# EAGLE schematic CPU (EAGLE 7.5.0), part 2 of 7
## Module REGISTER_UNIT
Ports: DATABUS_1(io) DATABUS_2(io) DATABUS_3(io) DATABUS_4(io) DATABUS_5(io) DATABUS_6(io) DATABUS_7(io) DATABUS_8(io) ADDRESSBUS_1(io) ADDRESSBUS_2(io) ADDRESSBUS_3(io) ADDRESSBUS_4(io) ADDRESSBUS_5(io) ADDRESSBUS_6(io) ADDRESSBUS_7(io) ADDRESSBUS_8(io) ADDRESSBUS_9(io) ADDRESSBUS_10(io) ADDRESSBUS_11(io) ADDRESSBUS_12(io) ADDRESSBUS_13(io) ADDRESSBUS_14(io) ADDRESSBUS_15(io) ADDRESSBUS_16(io) D_READ(in) D_WRITE(in) E_READ(in) E_WRITE(in) F_READ(in) F_WRITE(in) G_READ(in) G_WRITE(in) H_READ(in) H_WRITE(in) XL_READ(in) XL_WRITE(in) XH_READ(in) XH_WRITE(in) XE_READ(in) XE_WRITE(in) M_READ(in) M_WRITE(in) J_READ(in) J_WRITE(in) SP_READ(in) SP_WRITE(in) BP_READ(in) BP_WRITE(in) Y_READ(in) Y_WRITE(in) Z_READ(in) Z_WRITE(in) CLOCK(in) VCC(in) GND(in) X_READ(in) X_WRITE(in)
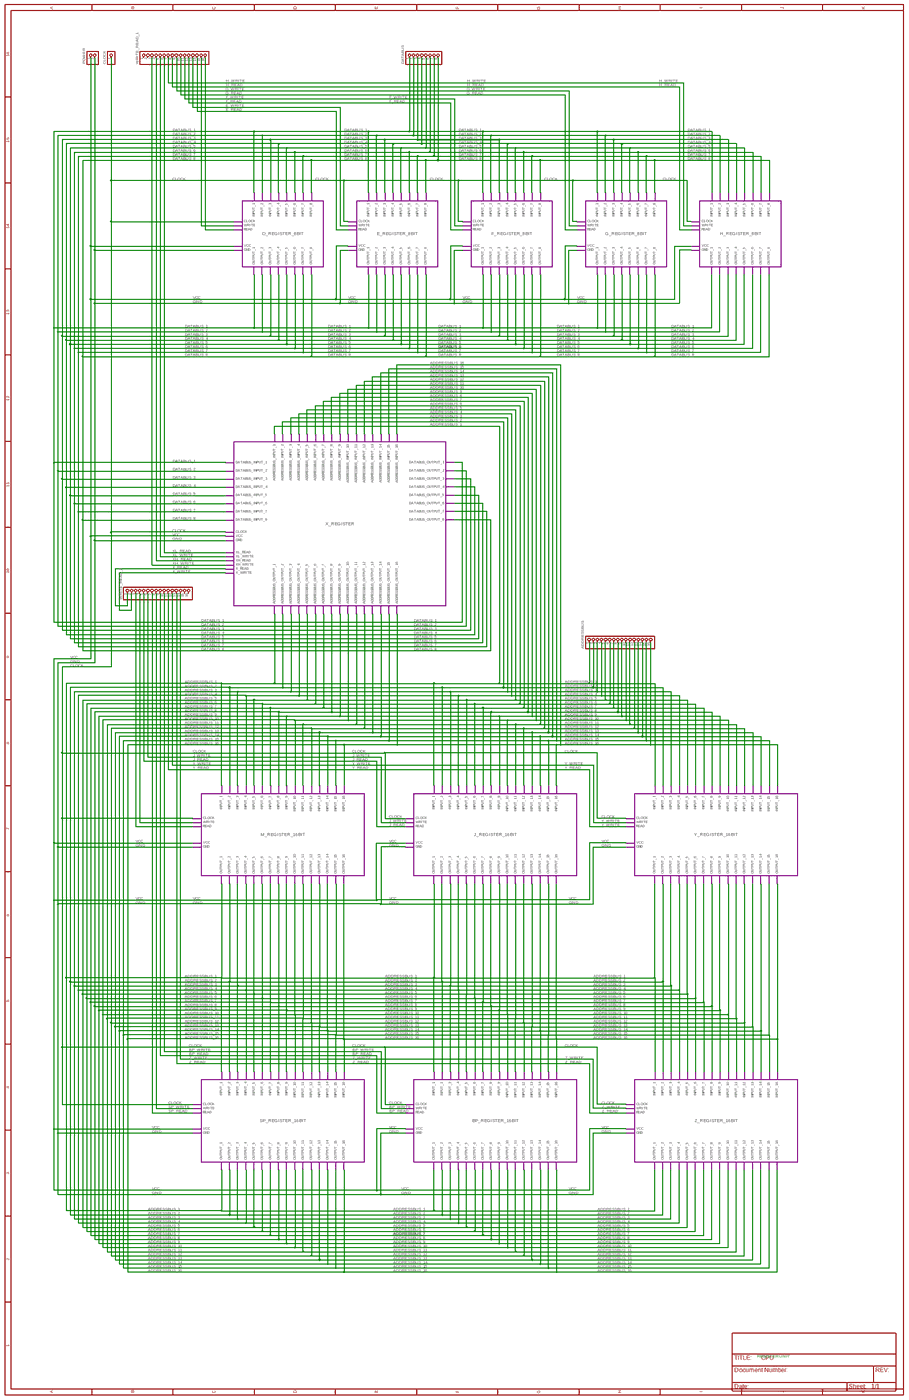
[diagram p15: schematic, module REGISTER_UNIT, sheet 1, overview]
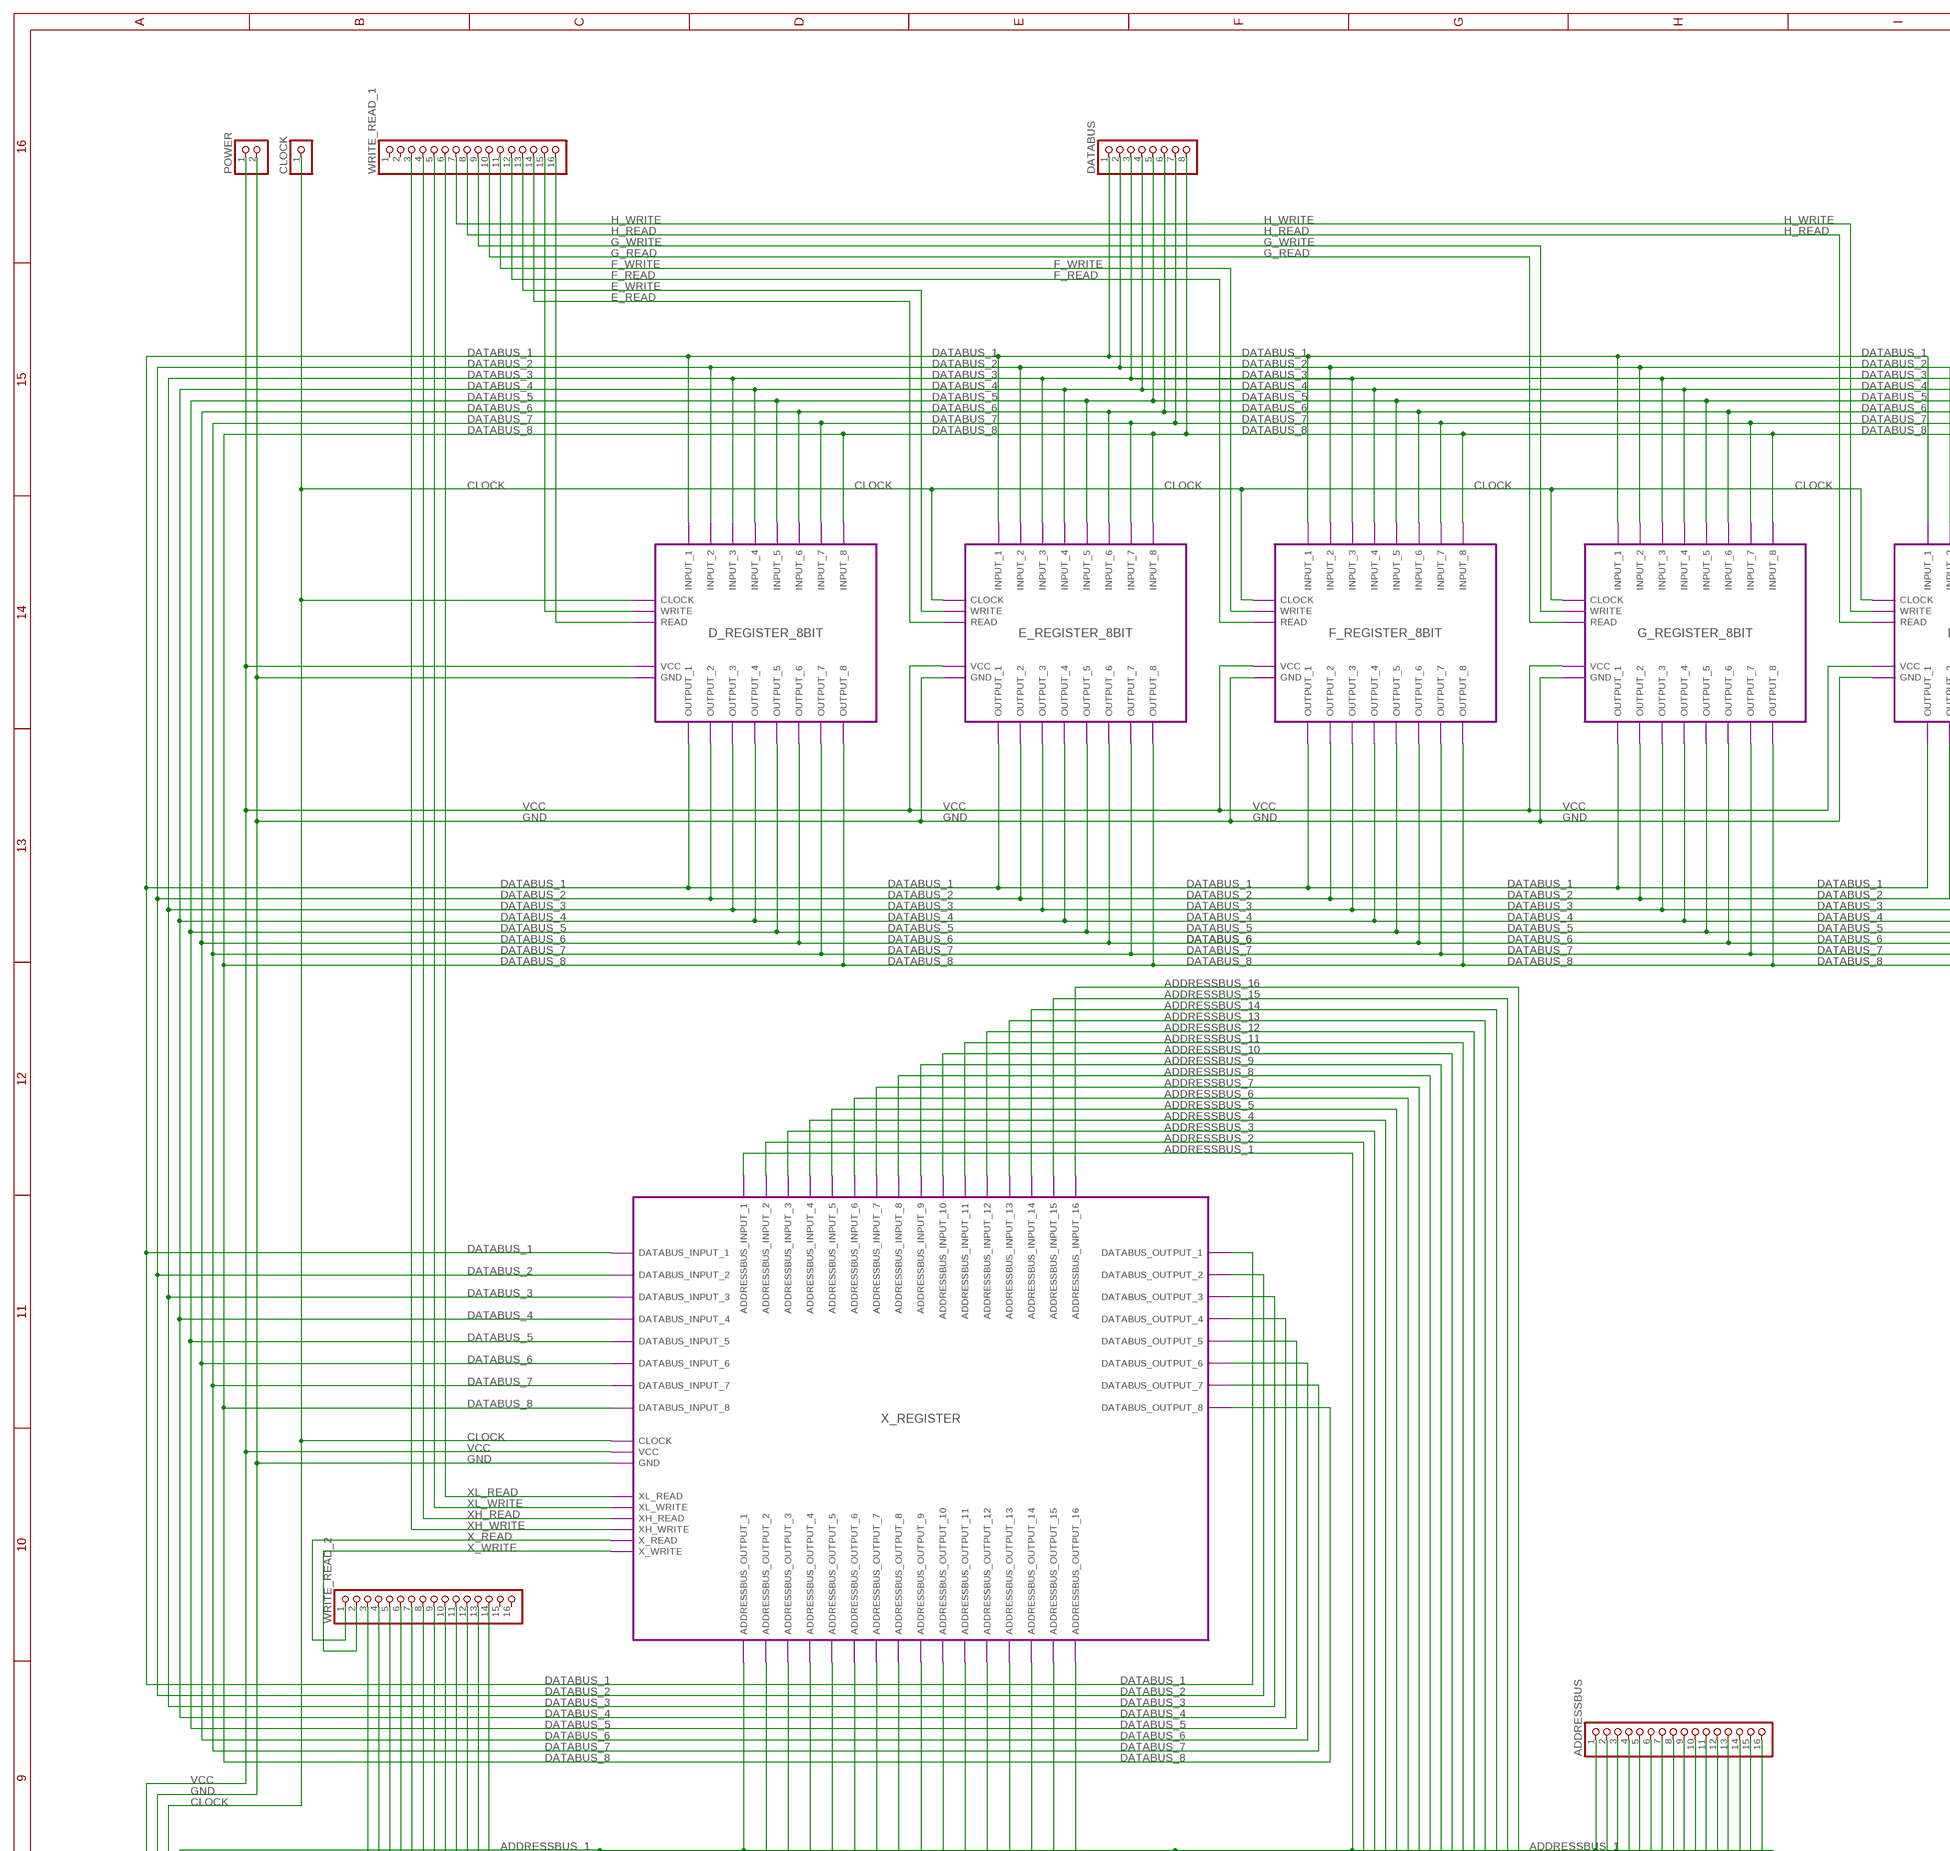
[diagram p16: schematic, module REGISTER_UNIT, sheet 1, part 1 of 4]
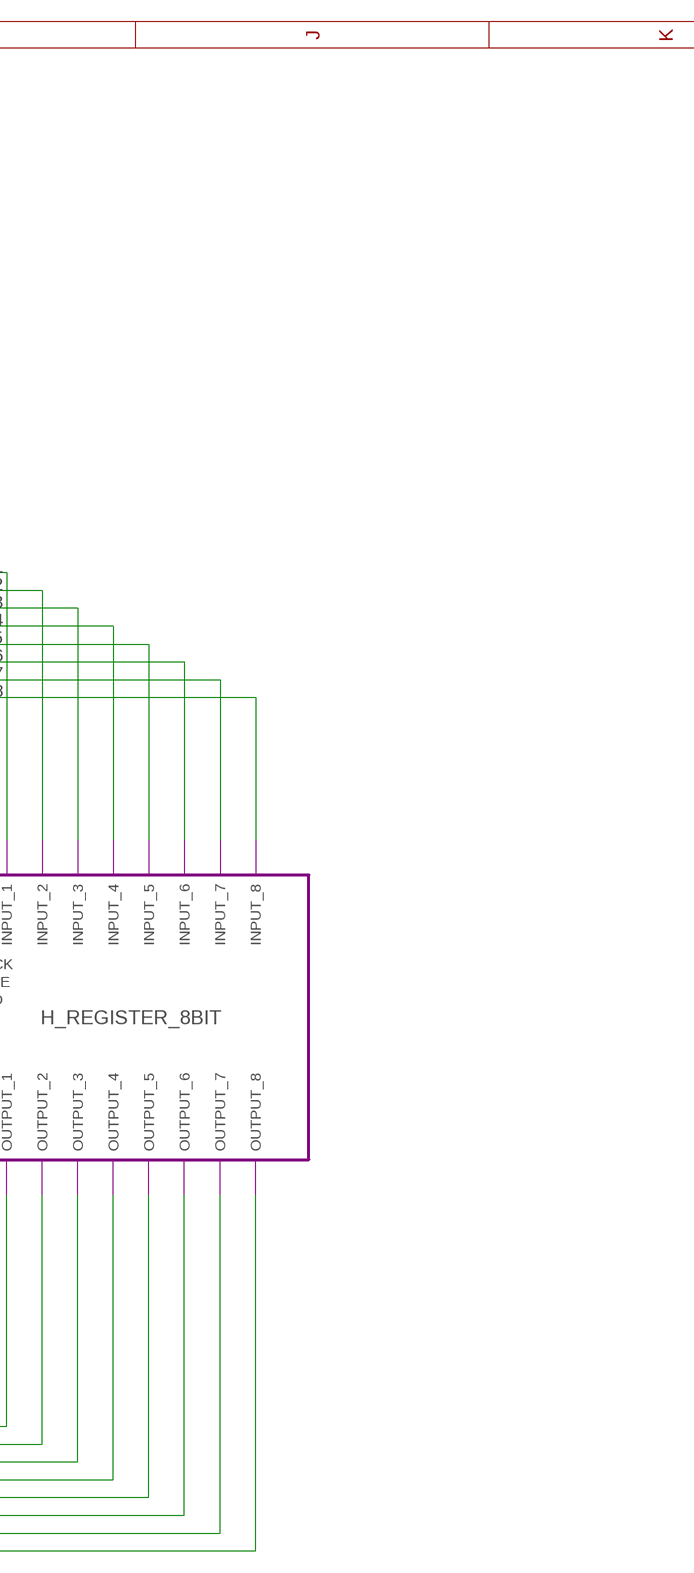
[diagram p17: schematic, module REGISTER_UNIT, sheet 1, part 2 of 4]
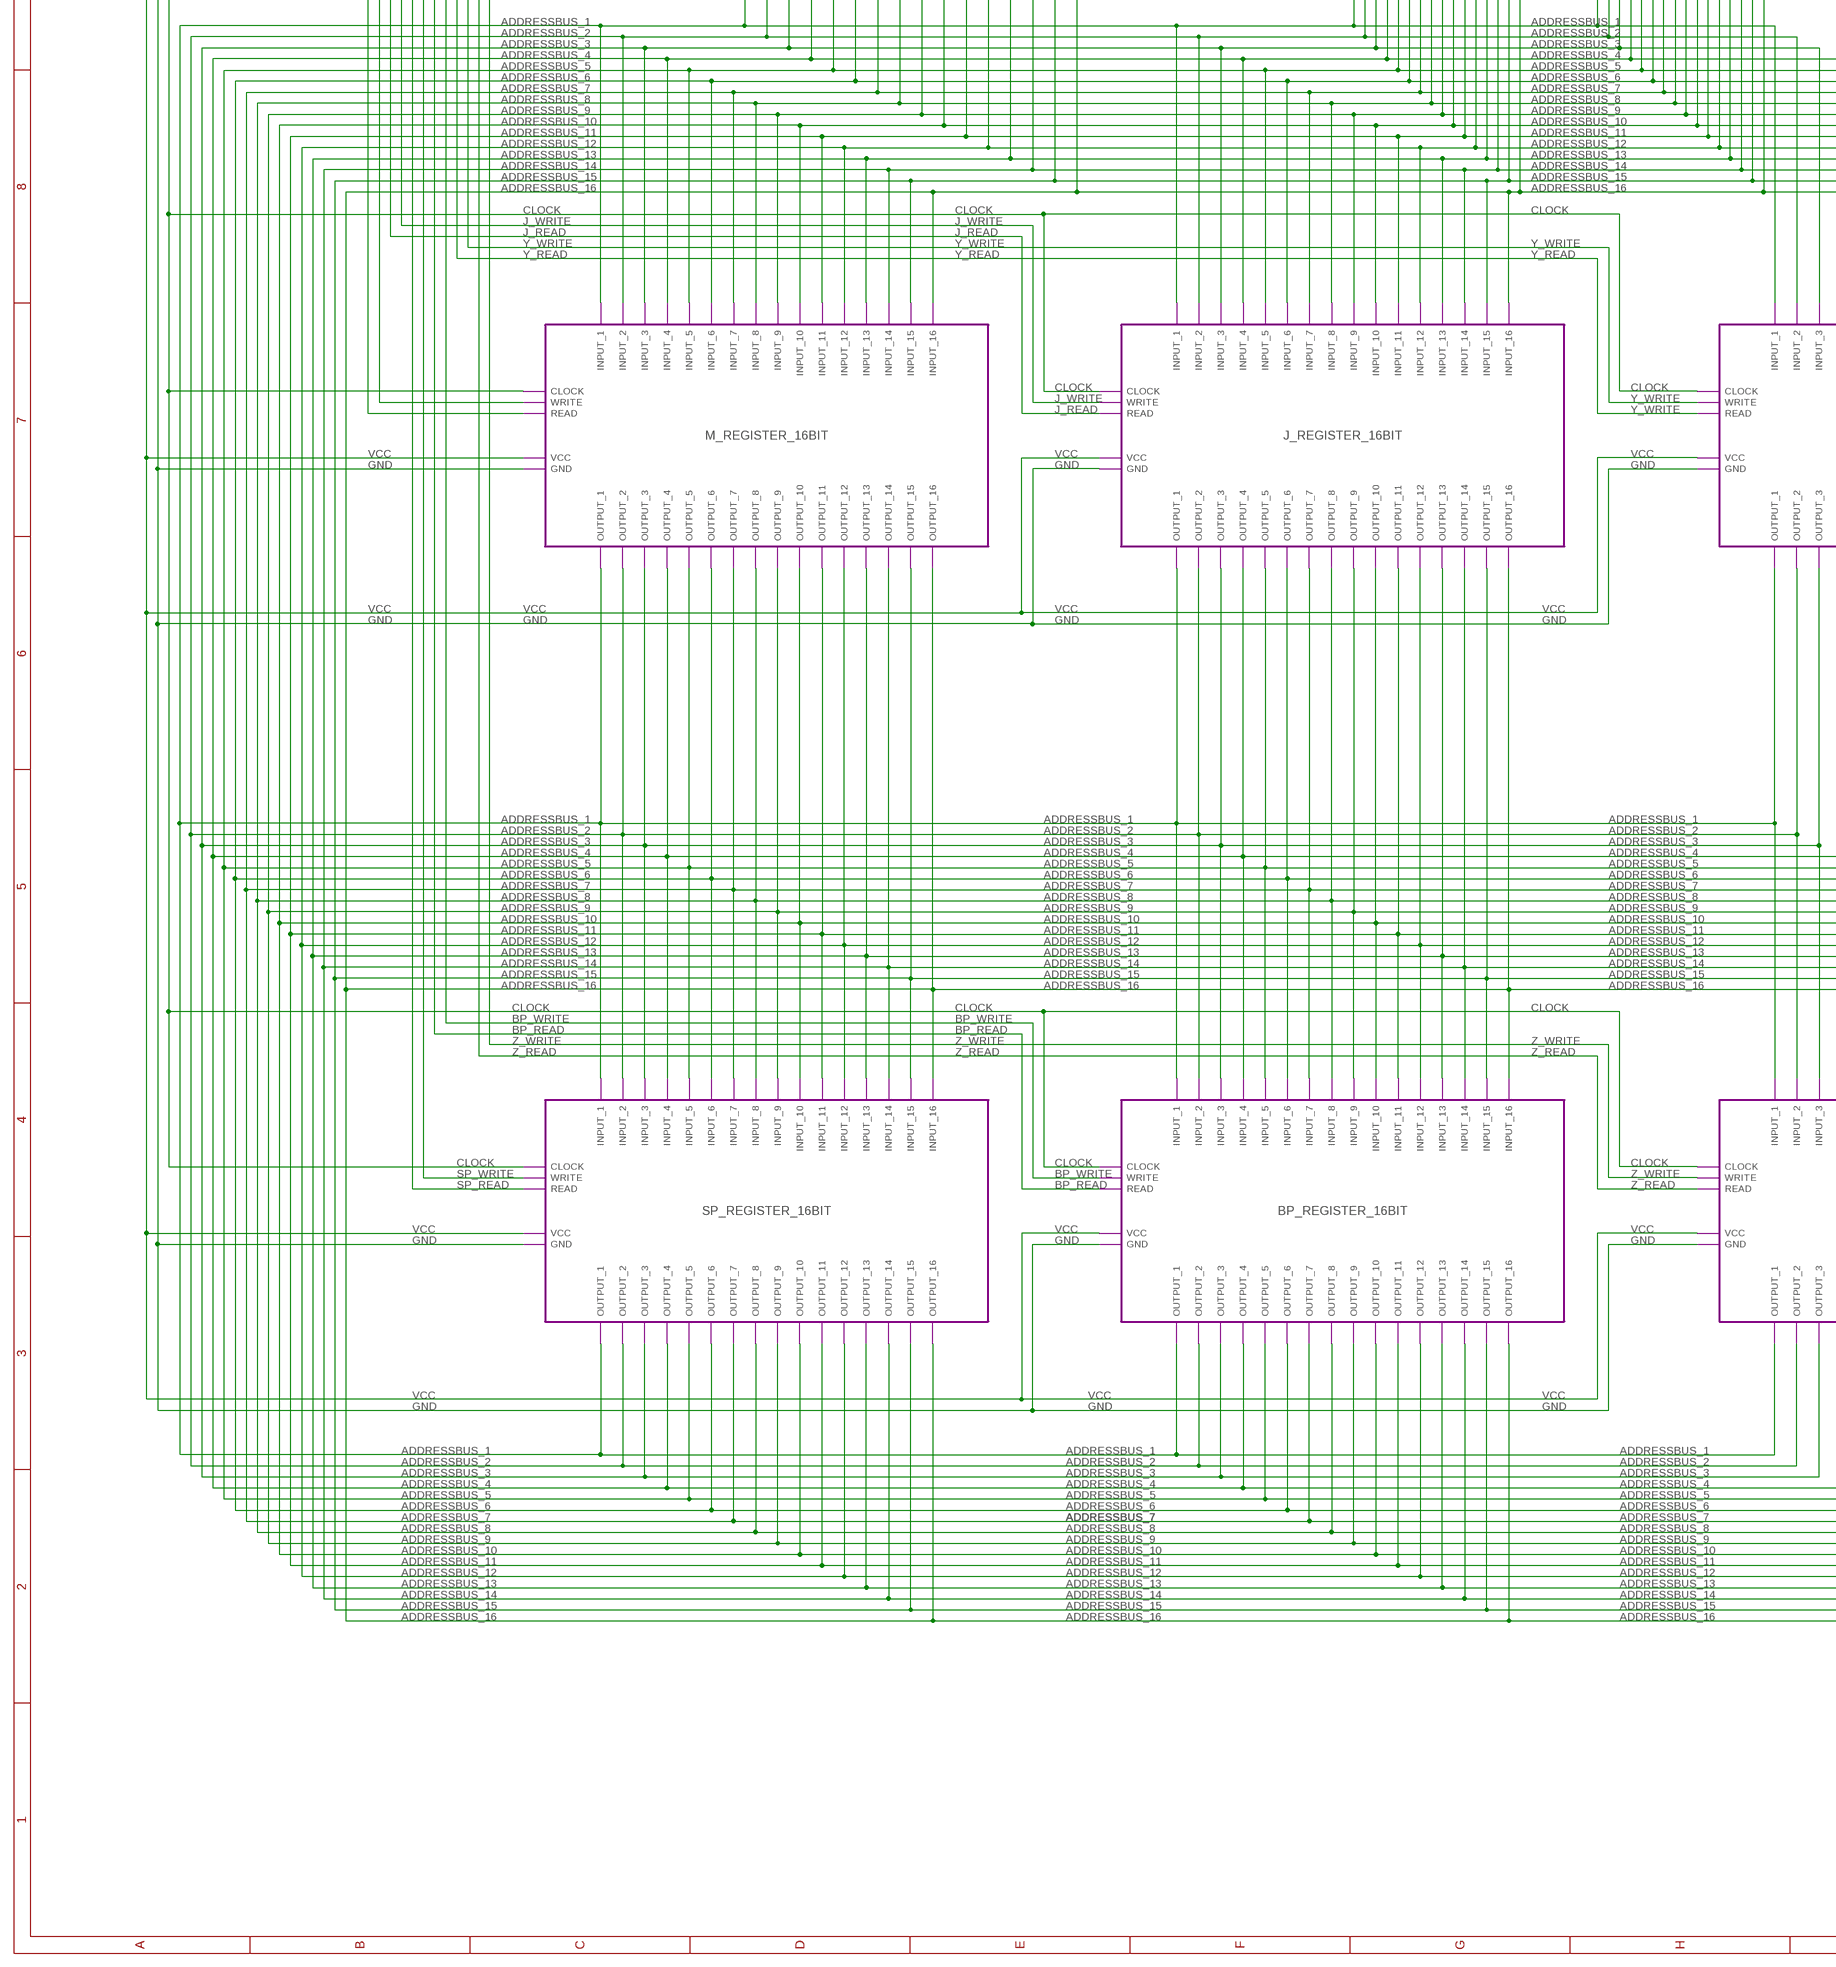
[diagram p18: schematic, module REGISTER_UNIT, sheet 1, part 3 of 4]
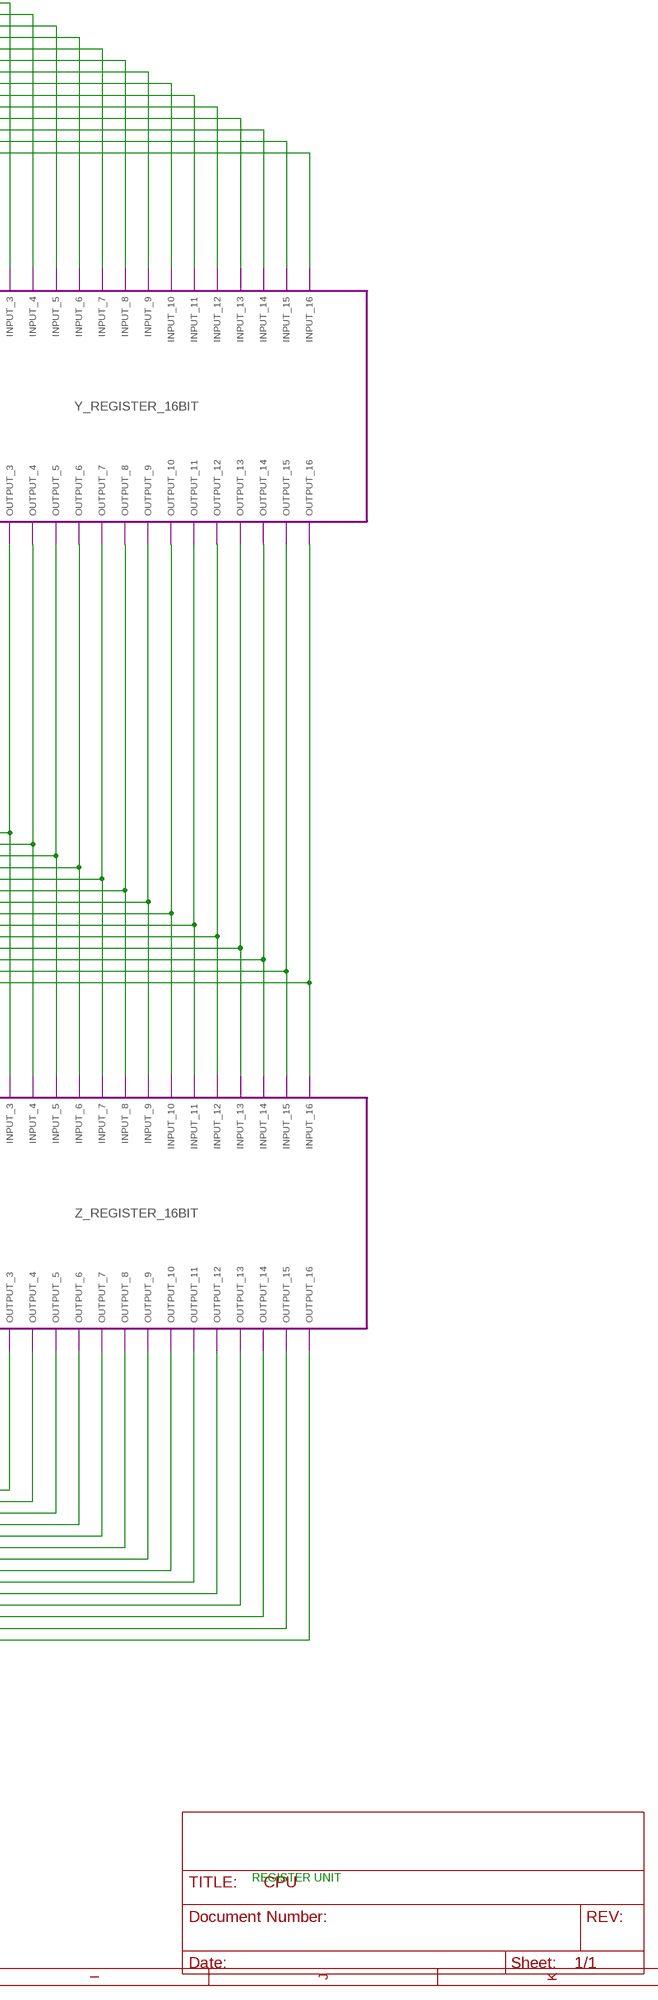
[diagram p19: schematic, module REGISTER_UNIT, sheet 1, part 4 of 4]

### Parts
ADDRESSBUS  PINHD-1X16  [1X16]
CLOCK  PINHD-1X1  [1X01]
DATABUS  PINHD-1X8  [1X08]
POWER  PINHD-1X2  [1X02]
WRITE_READ_1  PINHD-1X16  [1X16]
WRITE_READ_2  PINHD-1X16  [1X16]

### Module instances
D_REGISTER_8BIT = REGISTER
E_REGISTER_8BIT = REGISTER
F_REGISTER_8BIT = REGISTER
G_REGISTER_8BIT = REGISTER
H_REGISTER_8BIT = REGISTER
J_REGISTER_16BIT = REGISTER_16BIT
M_REGISTER_16BIT = REGISTER_16BIT
SP_REGISTER_16BIT = REGISTER_16BIT
BP_REGISTER_16BIT = REGISTER_16BIT
Y_REGISTER_16BIT = REGISTER_16BIT
Z_REGISTER_16BIT = REGISTER_16BIT
X_REGISTER = EXTENDED_REGISTER_16BIT

### Nets
ADDRESSBUS_1: ADDRESSBUS.1 ; port SP_REGISTER_16BIT.INPUT_1 M_REGISTER_16BIT.INPUT_1 Y_REGISTER_16BIT.INPUT_1 J_REGISTER_16BIT.INPUT_1 Z_REGISTER_16BIT.INPUT_1 BP_REGISTER_16BIT.INPUT_1 M_REGISTER_16BIT.OUTPUT_1 J_REGISTER_16BIT.OUTPUT_1 Y_REGISTER_16BIT.OUTPUT_1 SP_REGISTER_16BIT.OUTPUT_1 BP_REGISTER_16BIT.OUTPUT_1 Z_REGISTER_16BIT.OUTPUT_1 X_REGISTER.ADDRESSBUS_OUTPUT_1 X_REGISTER.ADDRESSBUS_INPUT_1
ADDRESSBUS_2: ADDRESSBUS.2 ; port M_REGISTER_16BIT.INPUT_2 Y_REGISTER_16BIT.INPUT_2 SP_REGISTER_16BIT.INPUT_2 J_REGISTER_16BIT.INPUT_2 Z_REGISTER_16BIT.INPUT_2 BP_REGISTER_16BIT.INPUT_2 M_REGISTER_16BIT.OUTPUT_2 J_REGISTER_16BIT.OUTPUT_2 Y_REGISTER_16BIT.OUTPUT_2 Z_REGISTER_16BIT.OUTPUT_2 SP_REGISTER_16BIT.OUTPUT_2 BP_REGISTER_16BIT.OUTPUT_2 X_REGISTER.ADDRESSBUS_OUTPUT_2 X_REGISTER.ADDRESSBUS_INPUT_2
ADDRESSBUS_3: ADDRESSBUS.3 ; port M_REGISTER_16BIT.INPUT_3 Y_REGISTER_16BIT.INPUT_3 SP_REGISTER_16BIT.INPUT_3 J_REGISTER_16BIT.INPUT_3 Z_REGISTER_16BIT.INPUT_3 BP_REGISTER_16BIT.INPUT_3 M_REGISTER_16BIT.OUTPUT_3 J_REGISTER_16BIT.OUTPUT_3 Y_REGISTER_16BIT.OUTPUT_3 Z_REGISTER_16BIT.OUTPUT_3 SP_REGISTER_16BIT.OUTPUT_3 BP_REGISTER_16BIT.OUTPUT_3 X_REGISTER.ADDRESSBUS_OUTPUT_3 X_REGISTER.ADDRESSBUS_INPUT_3
ADDRESSBUS_4: ADDRESSBUS.4 ; port M_REGISTER_16BIT.INPUT_4 Y_REGISTER_16BIT.INPUT_4 SP_REGISTER_16BIT.INPUT_4 J_REGISTER_16BIT.INPUT_4 Z_REGISTER_16BIT.INPUT_4 BP_REGISTER_16BIT.INPUT_4 M_REGISTER_16BIT.OUTPUT_4 J_REGISTER_16BIT.OUTPUT_4 Y_REGISTER_16BIT.OUTPUT_4 Z_REGISTER_16BIT.OUTPUT_4 SP_REGISTER_16BIT.OUTPUT_4 BP_REGISTER_16BIT.OUTPUT_4 X_REGISTER.ADDRESSBUS_OUTPUT_4 X_REGISTER.ADDRESSBUS_INPUT_4
ADDRESSBUS_5: ADDRESSBUS.5 ; port M_REGISTER_16BIT.INPUT_5 Y_REGISTER_16BIT.INPUT_5 SP_REGISTER_16BIT.INPUT_5 J_REGISTER_16BIT.INPUT_5 Z_REGISTER_16BIT.INPUT_5 BP_REGISTER_16BIT.INPUT_5 M_REGISTER_16BIT.OUTPUT_5 J_REGISTER_16BIT.OUTPUT_5 Y_REGISTER_16BIT.OUTPUT_5 Z_REGISTER_16BIT.OUTPUT_5 SP_REGISTER_16BIT.OUTPUT_5 BP_REGISTER_16BIT.OUTPUT_5 X_REGISTER.ADDRESSBUS_OUTPUT_5 X_REGISTER.ADDRESSBUS_INPUT_5
ADDRESSBUS_6: ADDRESSBUS.6 ; port M_REGISTER_16BIT.INPUT_6 Y_REGISTER_16BIT.INPUT_6 SP_REGISTER_16BIT.INPUT_6 J_REGISTER_16BIT.INPUT_6 Z_REGISTER_16BIT.INPUT_6 BP_REGISTER_16BIT.INPUT_6 M_REGISTER_16BIT.OUTPUT_6 J_REGISTER_16BIT.OUTPUT_6 Y_REGISTER_16BIT.OUTPUT_6 Z_REGISTER_16BIT.OUTPUT_6 SP_REGISTER_16BIT.OUTPUT_6 BP_REGISTER_16BIT.OUTPUT_6 X_REGISTER.ADDRESSBUS_OUTPUT_6 X_REGISTER.ADDRESSBUS_INPUT_6
ADDRESSBUS_7: ADDRESSBUS.7 ; port M_REGISTER_16BIT.INPUT_7 Y_REGISTER_16BIT.INPUT_7 SP_REGISTER_16BIT.INPUT_7 J_REGISTER_16BIT.INPUT_7 Z_REGISTER_16BIT.INPUT_7 BP_REGISTER_16BIT.INPUT_7 M_REGISTER_16BIT.OUTPUT_7 J_REGISTER_16BIT.OUTPUT_7 Y_REGISTER_16BIT.OUTPUT_7 Z_REGISTER_16BIT.OUTPUT_7 SP_REGISTER_16BIT.OUTPUT_7 BP_REGISTER_16BIT.OUTPUT_7 X_REGISTER.ADDRESSBUS_OUTPUT_7 X_REGISTER.ADDRESSBUS_INPUT_7
ADDRESSBUS_8: ADDRESSBUS.8 ; port M_REGISTER_16BIT.INPUT_8 Y_REGISTER_16BIT.INPUT_8 SP_REGISTER_16BIT.INPUT_8 J_REGISTER_16BIT.INPUT_8 Z_REGISTER_16BIT.INPUT_8 BP_REGISTER_16BIT.INPUT_8 M_REGISTER_16BIT.OUTPUT_8 J_REGISTER_16BIT.OUTPUT_8 Y_REGISTER_16BIT.OUTPUT_8 Z_REGISTER_16BIT.OUTPUT_8 SP_REGISTER_16BIT.OUTPUT_8 BP_REGISTER_16BIT.OUTPUT_8 X_REGISTER.ADDRESSBUS_OUTPUT_8 X_REGISTER.ADDRESSBUS_INPUT_8
ADDRESSBUS_9: ADDRESSBUS.9 ; port M_REGISTER_16BIT.INPUT_9 Y_REGISTER_16BIT.INPUT_9 SP_REGISTER_16BIT.INPUT_9 J_REGISTER_16BIT.INPUT_9 Z_REGISTER_16BIT.INPUT_9 BP_REGISTER_16BIT.INPUT_9 M_REGISTER_16BIT.OUTPUT_9 J_REGISTER_16BIT.OUTPUT_9 Y_REGISTER_16BIT.OUTPUT_9 Z_REGISTER_16BIT.OUTPUT_9 SP_REGISTER_16BIT.OUTPUT_9 BP_REGISTER_16BIT.OUTPUT_9 X_REGISTER.ADDRESSBUS_OUTPUT_9 X_REGISTER.ADDRESSBUS_INPUT_9
ADDRESSBUS_10: ADDRESSBUS.10 ; port M_REGISTER_16BIT.INPUT_10 Y_REGISTER_16BIT.INPUT_10 SP_REGISTER_16BIT.INPUT_10 J_REGISTER_16BIT.INPUT_10 Z_REGISTER_16BIT.INPUT_10 BP_REGISTER_16BIT.INPUT_10 M_REGISTER_16BIT.OUTPUT_10 J_REGISTER_16BIT.OUTPUT_10 Y_REGISTER_16BIT.OUTPUT_10 Z_REGISTER_16BIT.OUTPUT_10 SP_REGISTER_16BIT.OUTPUT_10 BP_REGISTER_16BIT.OUTPUT_10 X_REGISTER.ADDRESSBUS_OUTPUT_10 X_REGISTER.ADDRESSBUS_INPUT_10
ADDRESSBUS_11: ADDRESSBUS.11 ; port M_REGISTER_16BIT.INPUT_11 Y_REGISTER_16BIT.INPUT_11 SP_REGISTER_16BIT.INPUT_11 J_REGISTER_16BIT.INPUT_11 Z_REGISTER_16BIT.INPUT_11 BP_REGISTER_16BIT.INPUT_11 M_REGISTER_16BIT.OUTPUT_11 J_REGISTER_16BIT.OUTPUT_11 Y_REGISTER_16BIT.OUTPUT_11 Z_REGISTER_16BIT.OUTPUT_11 SP_REGISTER_16BIT.OUTPUT_11 BP_REGISTER_16BIT.OUTPUT_11 X_REGISTER.ADDRESSBUS_OUTPUT_11 X_REGISTER.ADDRESSBUS_INPUT_11
ADDRESSBUS_12: ADDRESSBUS.12 ; port M_REGISTER_16BIT.INPUT_12 Y_REGISTER_16BIT.INPUT_12 SP_REGISTER_16BIT.INPUT_12 J_REGISTER_16BIT.INPUT_12 Z_REGISTER_16BIT.INPUT_12 BP_REGISTER_16BIT.INPUT_12 M_REGISTER_16BIT.OUTPUT_12 J_REGISTER_16BIT.OUTPUT_12 Y_REGISTER_16BIT.OUTPUT_12 Z_REGISTER_16BIT.OUTPUT_12 SP_REGISTER_16BIT.OUTPUT_12 BP_REGISTER_16BIT.OUTPUT_12 X_REGISTER.ADDRESSBUS_OUTPUT_12 X_REGISTER.ADDRESSBUS_INPUT_12
ADDRESSBUS_13: ADDRESSBUS.13 ; port M_REGISTER_16BIT.INPUT_13 Y_REGISTER_16BIT.INPUT_13 J_REGISTER_16BIT.INPUT_13 Z_REGISTER_16BIT.OUTPUT_13 SP_REGISTER_16BIT.OUTPUT_13 BP_REGISTER_16BIT.OUTPUT_13 Y_REGISTER_16BIT.OUTPUT_13 Z_REGISTER_16BIT.INPUT_13 BP_REGISTER_16BIT.INPUT_13 J_REGISTER_16BIT.OUTPUT_13 SP_REGISTER_16BIT.INPUT_13 M_REGISTER_16BIT.OUTPUT_13 X_REGISTER.ADDRESSBUS_OUTPUT_13 X_REGISTER.ADDRESSBUS_INPUT_13
ADDRESSBUS_14: ADDRESSBUS.14 ; port M_REGISTER_16BIT.INPUT_14 Y_REGISTER_16BIT.INPUT_14 J_REGISTER_16BIT.INPUT_14 Z_REGISTER_16BIT.OUTPUT_14 BP_REGISTER_16BIT.OUTPUT_14 SP_REGISTER_16BIT.OUTPUT_14 SP_REGISTER_16BIT.INPUT_14 Z_REGISTER_16BIT.INPUT_14 BP_REGISTER_16BIT.INPUT_14 M_REGISTER_16BIT.OUTPUT_14 J_REGISTER_16BIT.OUTPUT_14 Y_REGISTER_16BIT.OUTPUT_14 X_REGISTER.ADDRESSBUS_OUTPUT_14 X_REGISTER.ADDRESSBUS_INPUT_14
ADDRESSBUS_15: ADDRESSBUS.15 ; port M_REGISTER_16BIT.INPUT_15 Y_REGISTER_16BIT.INPUT_15 J_REGISTER_16BIT.INPUT_15 Z_REGISTER_16BIT.OUTPUT_15 SP_REGISTER_16BIT.OUTPUT_15 BP_REGISTER_16BIT.OUTPUT_15 Y_REGISTER_16BIT.OUTPUT_15 Z_REGISTER_16BIT.INPUT_15 BP_REGISTER_16BIT.INPUT_15 J_REGISTER_16BIT.OUTPUT_15 M_REGISTER_16BIT.OUTPUT_15 SP_REGISTER_16BIT.INPUT_15 X_REGISTER.ADDRESSBUS_OUTPUT_15 X_REGISTER.ADDRESSBUS_INPUT_15
ADDRESSBUS_16: ADDRESSBUS.16 ; port M_REGISTER_16BIT.INPUT_16 Y_REGISTER_16BIT.INPUT_16 J_REGISTER_16BIT.INPUT_16 Z_REGISTER_16BIT.OUTPUT_16 BP_REGISTER_16BIT.OUTPUT_16 SP_REGISTER_16BIT.OUTPUT_16 SP_REGISTER_16BIT.INPUT_16 Z_REGISTER_16BIT.INPUT_16 BP_REGISTER_16BIT.INPUT_16 M_REGISTER_16BIT.OUTPUT_16 J_REGISTER_16BIT.OUTPUT_16 Y_REGISTER_16BIT.OUTPUT_16 X_REGISTER.ADDRESSBUS_OUTPUT_16 X_REGISTER.ADDRESSBUS_INPUT_16
BP_READ: WRITE_READ_2.9 ; port BP_REGISTER_16BIT.READ
BP_WRITE: WRITE_READ_2.10 ; port BP_REGISTER_16BIT.WRITE
CLOCK: CLOCK.1 ; port D_REGISTER_8BIT.CLOCK E_REGISTER_8BIT.CLOCK F_REGISTER_8BIT.CLOCK G_REGISTER_8BIT.CLOCK H_REGISTER_8BIT.CLOCK M_REGISTER_16BIT.CLOCK J_REGISTER_16BIT.CLOCK Y_REGISTER_16BIT.CLOCK SP_REGISTER_16BIT.CLOCK BP_REGISTER_16BIT.CLOCK Z_REGISTER_16BIT.CLOCK X_REGISTER.CLOCK
D_READ: WRITE_READ_1.16 ; port D_REGISTER_8BIT.READ
D_WRITE: WRITE_READ_1.15 ; port D_REGISTER_8BIT.WRITE
DATABUS_1: DATABUS.1 ; port H_REGISTER_8BIT.INPUT_1 H_REGISTER_8BIT.OUTPUT_1 F_REGISTER_8BIT.INPUT_1 G_REGISTER_8BIT.INPUT_1 E_REGISTER_8BIT.INPUT_1 D_REGISTER_8BIT.INPUT_1 D_REGISTER_8BIT.OUTPUT_1 E_REGISTER_8BIT.OUTPUT_1 F_REGISTER_8BIT.OUTPUT_1 G_REGISTER_8BIT.OUTPUT_1 X_REGISTER.DATABUS_INPUT_1 X_REGISTER.DATABUS_OUTPUT_1
DATABUS_2: DATABUS.2 ; port H_REGISTER_8BIT.INPUT_2 H_REGISTER_8BIT.OUTPUT_2 F_REGISTER_8BIT.INPUT_2 G_REGISTER_8BIT.INPUT_2 E_REGISTER_8BIT.INPUT_2 D_REGISTER_8BIT.INPUT_2 D_REGISTER_8BIT.OUTPUT_2 E_REGISTER_8BIT.OUTPUT_2 F_REGISTER_8BIT.OUTPUT_2 G_REGISTER_8BIT.OUTPUT_2 X_REGISTER.DATABUS_INPUT_2 X_REGISTER.DATABUS_OUTPUT_2
DATABUS_3: DATABUS.3 ; port H_REGISTER_8BIT.INPUT_3 H_REGISTER_8BIT.OUTPUT_3 F_REGISTER_8BIT.INPUT_3 G_REGISTER_8BIT.INPUT_3 E_REGISTER_8BIT.INPUT_3 D_REGISTER_8BIT.INPUT_3 D_REGISTER_8BIT.OUTPUT_3 E_REGISTER_8BIT.OUTPUT_3 F_REGISTER_8BIT.OUTPUT_3 G_REGISTER_8BIT.OUTPUT_3 X_REGISTER.DATABUS_INPUT_3 X_REGISTER.DATABUS_OUTPUT_3
DATABUS_4: DATABUS.4 ; port H_REGISTER_8BIT.INPUT_4 H_REGISTER_8BIT.OUTPUT_4 F_REGISTER_8BIT.INPUT_4 G_REGISTER_8BIT.INPUT_4 E_REGISTER_8BIT.INPUT_4 D_REGISTER_8BIT.OUTPUT_4 E_REGISTER_8BIT.OUTPUT_4 F_REGISTER_8BIT.OUTPUT_4 G_REGISTER_8BIT.OUTPUT_4 X_REGISTER.DATABUS_INPUT_4 X_REGISTER.DATABUS_OUTPUT_4
DATABUS_5: DATABUS.5 ; port H_REGISTER_8BIT.INPUT_5 H_REGISTER_8BIT.OUTPUT_5 F_REGISTER_8BIT.INPUT_5 G_REGISTER_8BIT.INPUT_5 E_REGISTER_8BIT.INPUT_5 D_REGISTER_8BIT.INPUT_5 D_REGISTER_8BIT.OUTPUT_5 E_REGISTER_8BIT.OUTPUT_5 F_REGISTER_8BIT.OUTPUT_5 G_REGISTER_8BIT.OUTPUT_5 X_REGISTER.DATABUS_INPUT_5 X_REGISTER.DATABUS_OUTPUT_5
DATABUS_6: DATABUS.6 ; port H_REGISTER_8BIT.INPUT_6 H_REGISTER_8BIT.OUTPUT_6 F_REGISTER_8BIT.INPUT_6 G_REGISTER_8BIT.INPUT_6 E_REGISTER_8BIT.INPUT_6 D_REGISTER_8BIT.INPUT_6 D_REGISTER_8BIT.OUTPUT_6 E_REGISTER_8BIT.OUTPUT_6 F_REGISTER_8BIT.OUTPUT_6 G_REGISTER_8BIT.OUTPUT_6 X_REGISTER.DATABUS_INPUT_6 X_REGISTER.DATABUS_OUTPUT_6
DATABUS_7: DATABUS.7 ; port H_REGISTER_8BIT.OUTPUT_7 H_REGISTER_8BIT.INPUT_7 F_REGISTER_8BIT.INPUT_7 G_REGISTER_8BIT.INPUT_7 E_REGISTER_8BIT.INPUT_7 D_REGISTER_8BIT.INPUT_7 D_REGISTER_8BIT.OUTPUT_7 E_REGISTER_8BIT.OUTPUT_7 F_REGISTER_8BIT.OUTPUT_7 G_REGISTER_8BIT.OUTPUT_7 X_REGISTER.DATABUS_INPUT_7 X_REGISTER.DATABUS_OUTPUT_7
DATABUS_8: DATABUS.8 ; port H_REGISTER_8BIT.INPUT_8 H_REGISTER_8BIT.OUTPUT_8 F_REGISTER_8BIT.INPUT_8 G_REGISTER_8BIT.INPUT_8 E_REGISTER_8BIT.INPUT_8 D_REGISTER_8BIT.INPUT_8 D_REGISTER_8BIT.OUTPUT_8 E_REGISTER_8BIT.OUTPUT_8 F_REGISTER_8BIT.OUTPUT_8 G_REGISTER_8BIT.OUTPUT_8 X_REGISTER.DATABUS_INPUT_8 X_REGISTER.DATABUS_OUTPUT_8
E_READ: WRITE_READ_1.14 ; port E_REGISTER_8BIT.READ
E_WRITE: WRITE_READ_1.13 ; port E_REGISTER_8BIT.WRITE
F_READ: WRITE_READ_1.12 ; port F_REGISTER_8BIT.READ
F_WRITE: WRITE_READ_1.11 ; port F_REGISTER_8BIT.WRITE
G_READ: WRITE_READ_1.10 ; port G_REGISTER_8BIT.READ
G_WRITE: WRITE_READ_1.9 ; port G_REGISTER_8BIT.WRITE
GND: POWER.2 ; port D_REGISTER_8BIT.GND F_REGISTER_8BIT.GND G_REGISTER_8BIT.GND H_REGISTER_8BIT.GND E_REGISTER_8BIT.GND M_REGISTER_16BIT.GND SP_REGISTER_16BIT.GND J_REGISTER_16BIT.GND Y_REGISTER_16BIT.GND BP_REGISTER_16BIT.GND Z_REGISTER_16BIT.GND X_REGISTER.GND
H_READ: WRITE_READ_1.8 ; port H_REGISTER_8BIT.READ
H_WRITE: WRITE_READ_1.7 ; port H_REGISTER_8BIT.WRITE
J_READ: WRITE_READ_2.5 ; port J_REGISTER_16BIT.READ
J_WRITE: WRITE_READ_2.6 ; port J_REGISTER_16BIT.WRITE
M_READ: WRITE_READ_2.3 ; port M_REGISTER_16BIT.READ
M_WRITE: WRITE_READ_2.4 ; port M_REGISTER_16BIT.WRITE
N$1: port D_REGISTER_8BIT.INPUT_4
SP_READ: WRITE_READ_2.7 ; port SP_REGISTER_16BIT.READ
SP_WRITE: WRITE_READ_2.8 ; port SP_REGISTER_16BIT.WRITE
VCC: POWER.1 ; port D_REGISTER_8BIT.VCC H_REGISTER_8BIT.VCC G_REGISTER_8BIT.VCC F_REGISTER_8BIT.VCC E_REGISTER_8BIT.VCC M_REGISTER_16BIT.VCC SP_REGISTER_16BIT.VCC Y_REGISTER_16BIT.VCC BP_REGISTER_16BIT.VCC Z_REGISTER_16BIT.VCC J_REGISTER_16BIT.VCC X_REGISTER.VCC
X_READ: WRITE_READ_2.1 ; port X_REGISTER.X_READ
X_WRITE: WRITE_READ_2.2 ; port X_REGISTER.X_WRITE
XH_READ: WRITE_READ_1.4 ; port X_REGISTER.XH_READ
XH_WRITE: WRITE_READ_1.3 ; port X_REGISTER.XH_WRITE
XL_READ: WRITE_READ_1.6 ; port X_REGISTER.XL_READ
XL_WRITE: WRITE_READ_1.5 ; port X_REGISTER.XL_WRITE
Y_READ: WRITE_READ_2.11 ; port Y_REGISTER_16BIT.READ
Y_WRITE: WRITE_READ_2.12 ; port Y_REGISTER_16BIT.WRITE
Z_READ: WRITE_READ_2.13 ; port Z_REGISTER_16BIT.READ
Z_WRITE: WRITE_READ_2.14 ; port Z_REGISTER_16BIT.WRITE
Unconnected: WRITE_READ_1.1 WRITE_READ_1.2 WRITE_READ_2.15 WRITE_READ_2.16

### Notes on the sheet
- REGISTER UNIT

### Library data of the parts
ADDRESSBUS WRITE_READ_1 WRITE_READ_2 = pinhead:PINHD-1X16: PIN HEADER
CLOCK = pinhead:PINHD-1X1: PIN HEADER
DATABUS = pinhead:PINHD-1X8: PIN HEADER
POWER = pinhead:PINHD-1X2: PIN HEADER

## Module OR
Ports: INPUT_A_1(in) INPUT_A_2(in) INPUT_A_3(in) INPUT_A_4(in) INPUT_A_5(in) INPUT_A_6(in) INPUT_A_7(in) INPUT_A_8(in) INPUT_B_1(in) INPUT_B_2(in) INPUT_B_3(in) INPUT_B_4(in) INPUT_B_5(in) INPUT_B_6(in) INPUT_B_7(in) INPUT_B_8(in) OUTPUT_1(out) OUTPUT_2(out) OUTPUT_3(out) OUTPUT_4(out) OUTPUT_5(out) OUTPUT_6(out) OUTPUT_7(out) OUTPUT_8(out) VCC(in) GND(in) ENABLE(in)
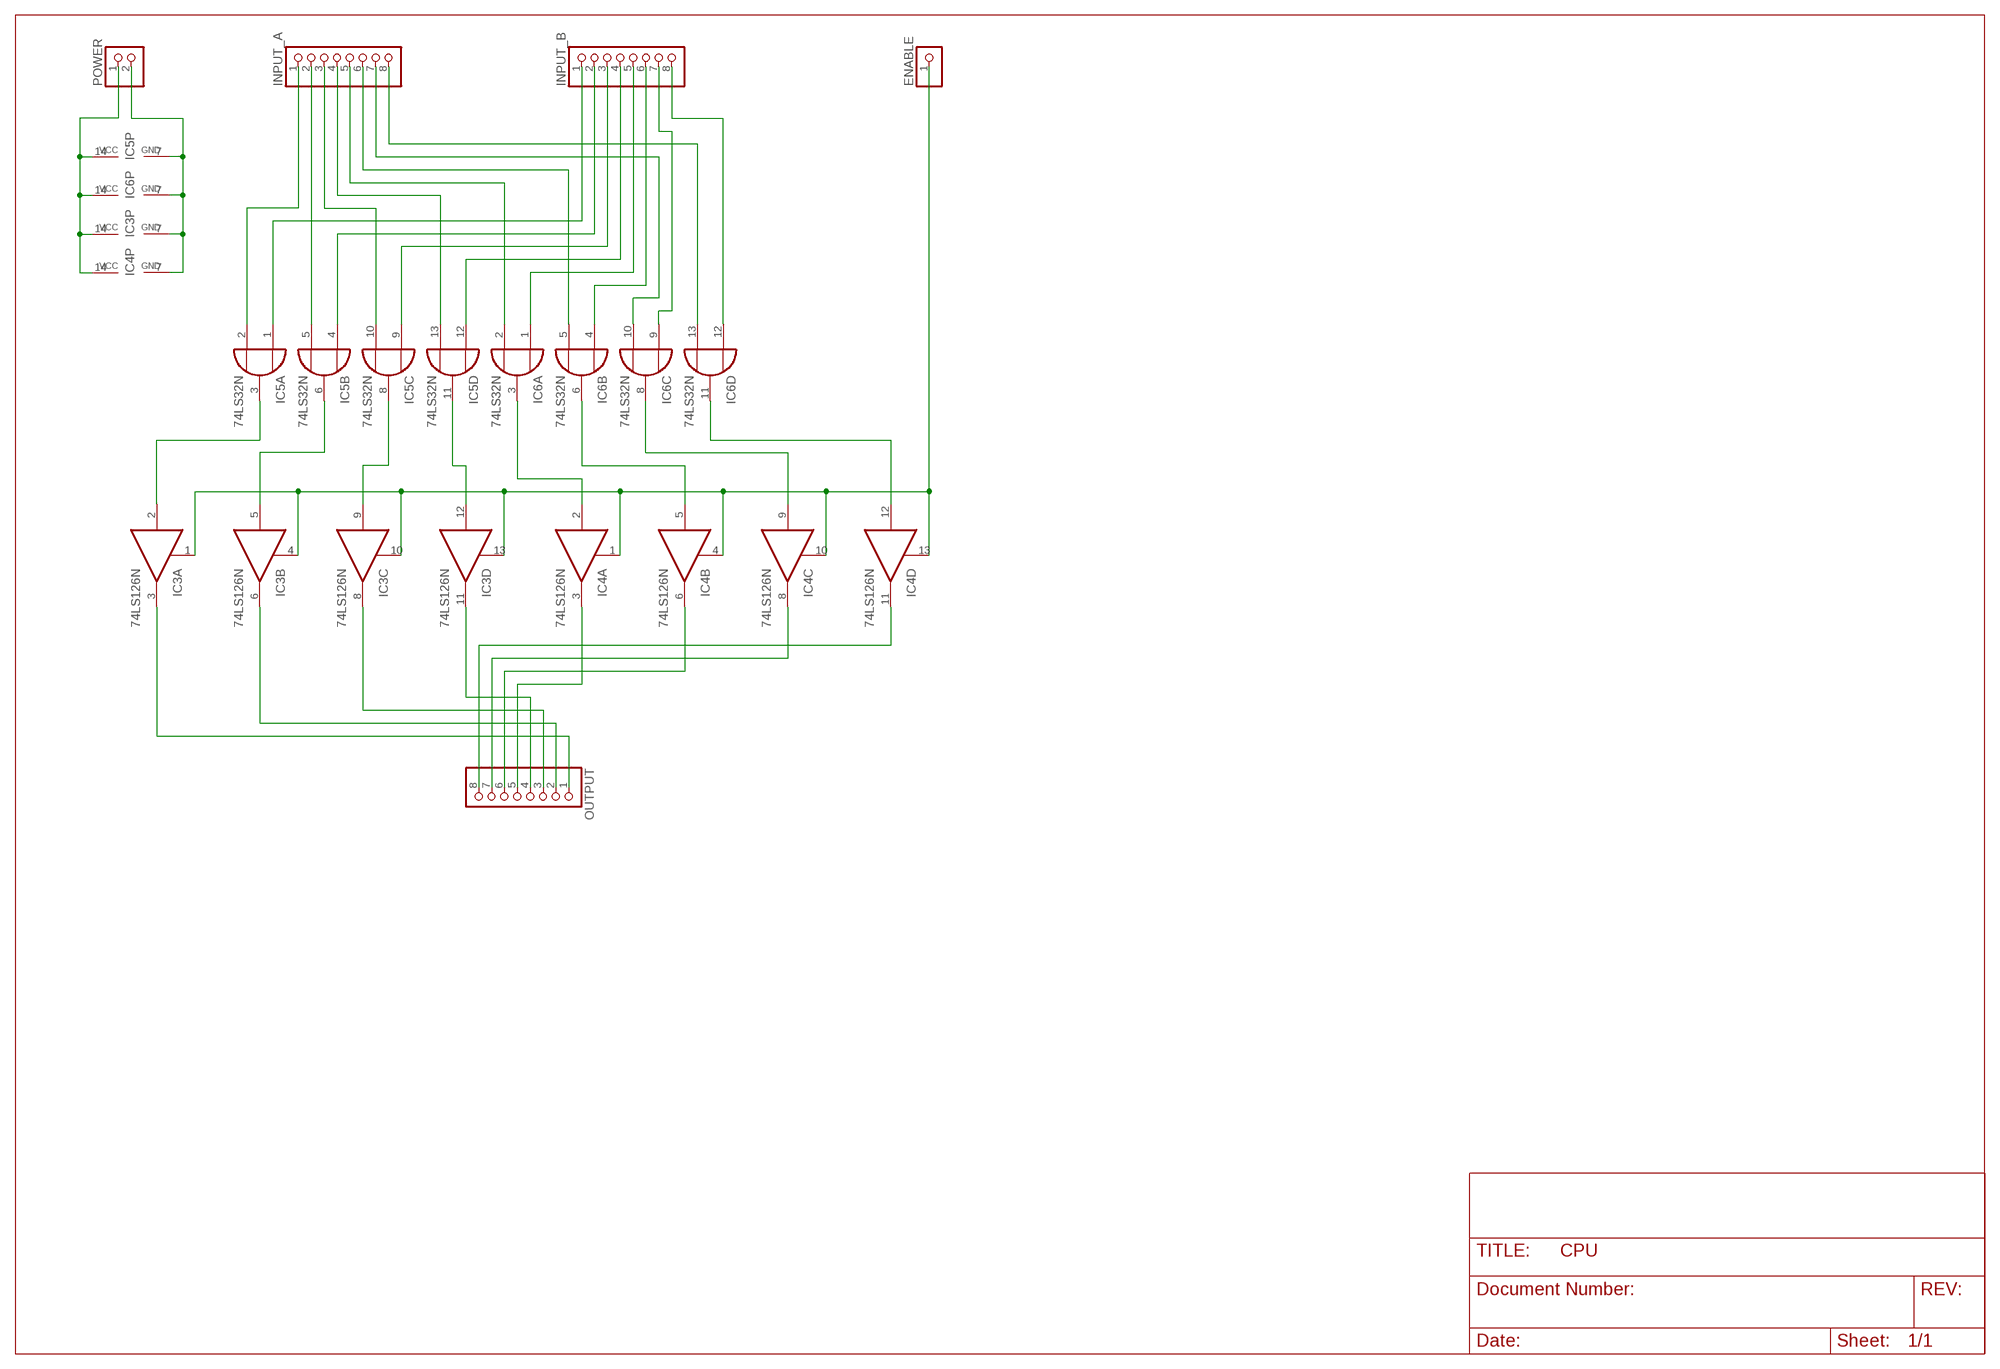
[diagram p20: schematic, module OR, sheet 1]

### Parts
ENABLE  PINHD-1X1  [1X01]
IC3  74LS126N  [DIL14]
IC4  74LS126N  [DIL14]
IC5  74LS32N  [DIL14]
IC6  74LS32N  [DIL14]
INPUT_A  PINHD-1X8  [1X08]
INPUT_B  PINHD-1X8  [1X08]
OUTPUT  PINHD-1X8  [1X08]
POWER  PINHD-1X2  [1X02]

### Nets
ENABLE: ENABLE.1 IC3.1(A:OE) IC3.4(B:OE) IC3.10(C:OE) IC3.13(D:OE) IC4.1(A:OE) IC4.4(B:OE) IC4.10(C:OE) IC4.13(D:OE)
GND: IC5.7(P:GND) IC6.7(P:GND) POWER.2
INPUT_A_1: IC5.2(A:I1) INPUT_A.1
INPUT_A_2: IC5.5(B:I1) INPUT_A.2
INPUT_A_3: IC5.10(C:I1) INPUT_A.3
INPUT_A_4: IC5.13(D:I1) INPUT_A.4
INPUT_A_5: IC6.2(A:I1) INPUT_A.5
INPUT_A_6: IC6.5(B:I1) INPUT_A.6
INPUT_A_7: IC6.10(C:I1) INPUT_A.7
INPUT_A_8: IC6.13(D:I1) INPUT_A.8
INPUT_B_1: IC5.1(A:I0) INPUT_B.1
INPUT_B_2: IC5.4(B:I0) INPUT_B.2
INPUT_B_3: IC5.9(C:I0) INPUT_B.3
INPUT_B_4: IC5.12(D:I0) INPUT_B.4
INPUT_B_5: IC6.1(A:I0) INPUT_B.5
INPUT_B_6: IC6.4(B:I0) INPUT_B.6
INPUT_B_7: IC6.9(C:I0) INPUT_B.7
INPUT_B_8: IC6.12(D:I0) INPUT_B.8
N$18: IC3.5(B:I) IC5.6(B:O)
N$19: IC3.9(C:I) IC5.8(C:O)
N$20: IC3.12(D:I) IC5.11(D:O)
N$21: IC4.2(A:I) IC6.3(A:O)
N$22: IC4.5(B:I) IC6.6(B:O)
N$23: IC4.9(C:I) IC6.8(C:O)
N$24: IC4.12(D:I) IC6.11(D:O)
N$34: IC3.2(A:I) IC5.3(A:O)
OUTPUT_1: IC3.3(A:O) OUTPUT.1
OUTPUT_2: IC3.6(B:O) OUTPUT.2
OUTPUT_3: IC3.8(C:O) OUTPUT.3
OUTPUT_4: IC3.11(D:O) OUTPUT.4
OUTPUT_5: IC4.3(A:O) OUTPUT.5
OUTPUT_6: IC4.6(B:O) OUTPUT.6
OUTPUT_7: IC4.8(C:O) OUTPUT.7
OUTPUT_8: IC4.11(D:O) OUTPUT.8
VCC: IC3.14(P:VCC) IC4.14(P:VCC) IC5.14(P:VCC) IC6.14(P:VCC) POWER.1

### Power pins joined to a net without a drawn wire
GND: IC3.7(P:GND) IC4.7(P:GND)

### Library data of the parts
ENABLE = pinhead:PINHD-1X1: PIN HEADER
IC3 IC4 = 74xx-eu:74*126: Quad bus BUFFER, 3-state
IC5 IC6 = 74xx-eu:74*32: Quad 2-input OR gate
INPUT_A INPUT_B OUTPUT = pinhead:PINHD-1X8: PIN HEADER
POWER = pinhead:PINHD-1X2: PIN HEADER

## Module NOT
Ports: INPUT1(in) INPUT2(in) INPUT3(in) INPUT4(in) INPUT5(in) INPUT6(in) INPUT7(in) INPUT8(in) OUTPUT1(out) OUTPUT2(out) OUTPUT3(out) OUTPUT4(out) OUTPUT5(out) OUTPUT6(out) OUTPUT7(out) OUTPUT8(out) VCC(in) GND(in) ENABLE(in)
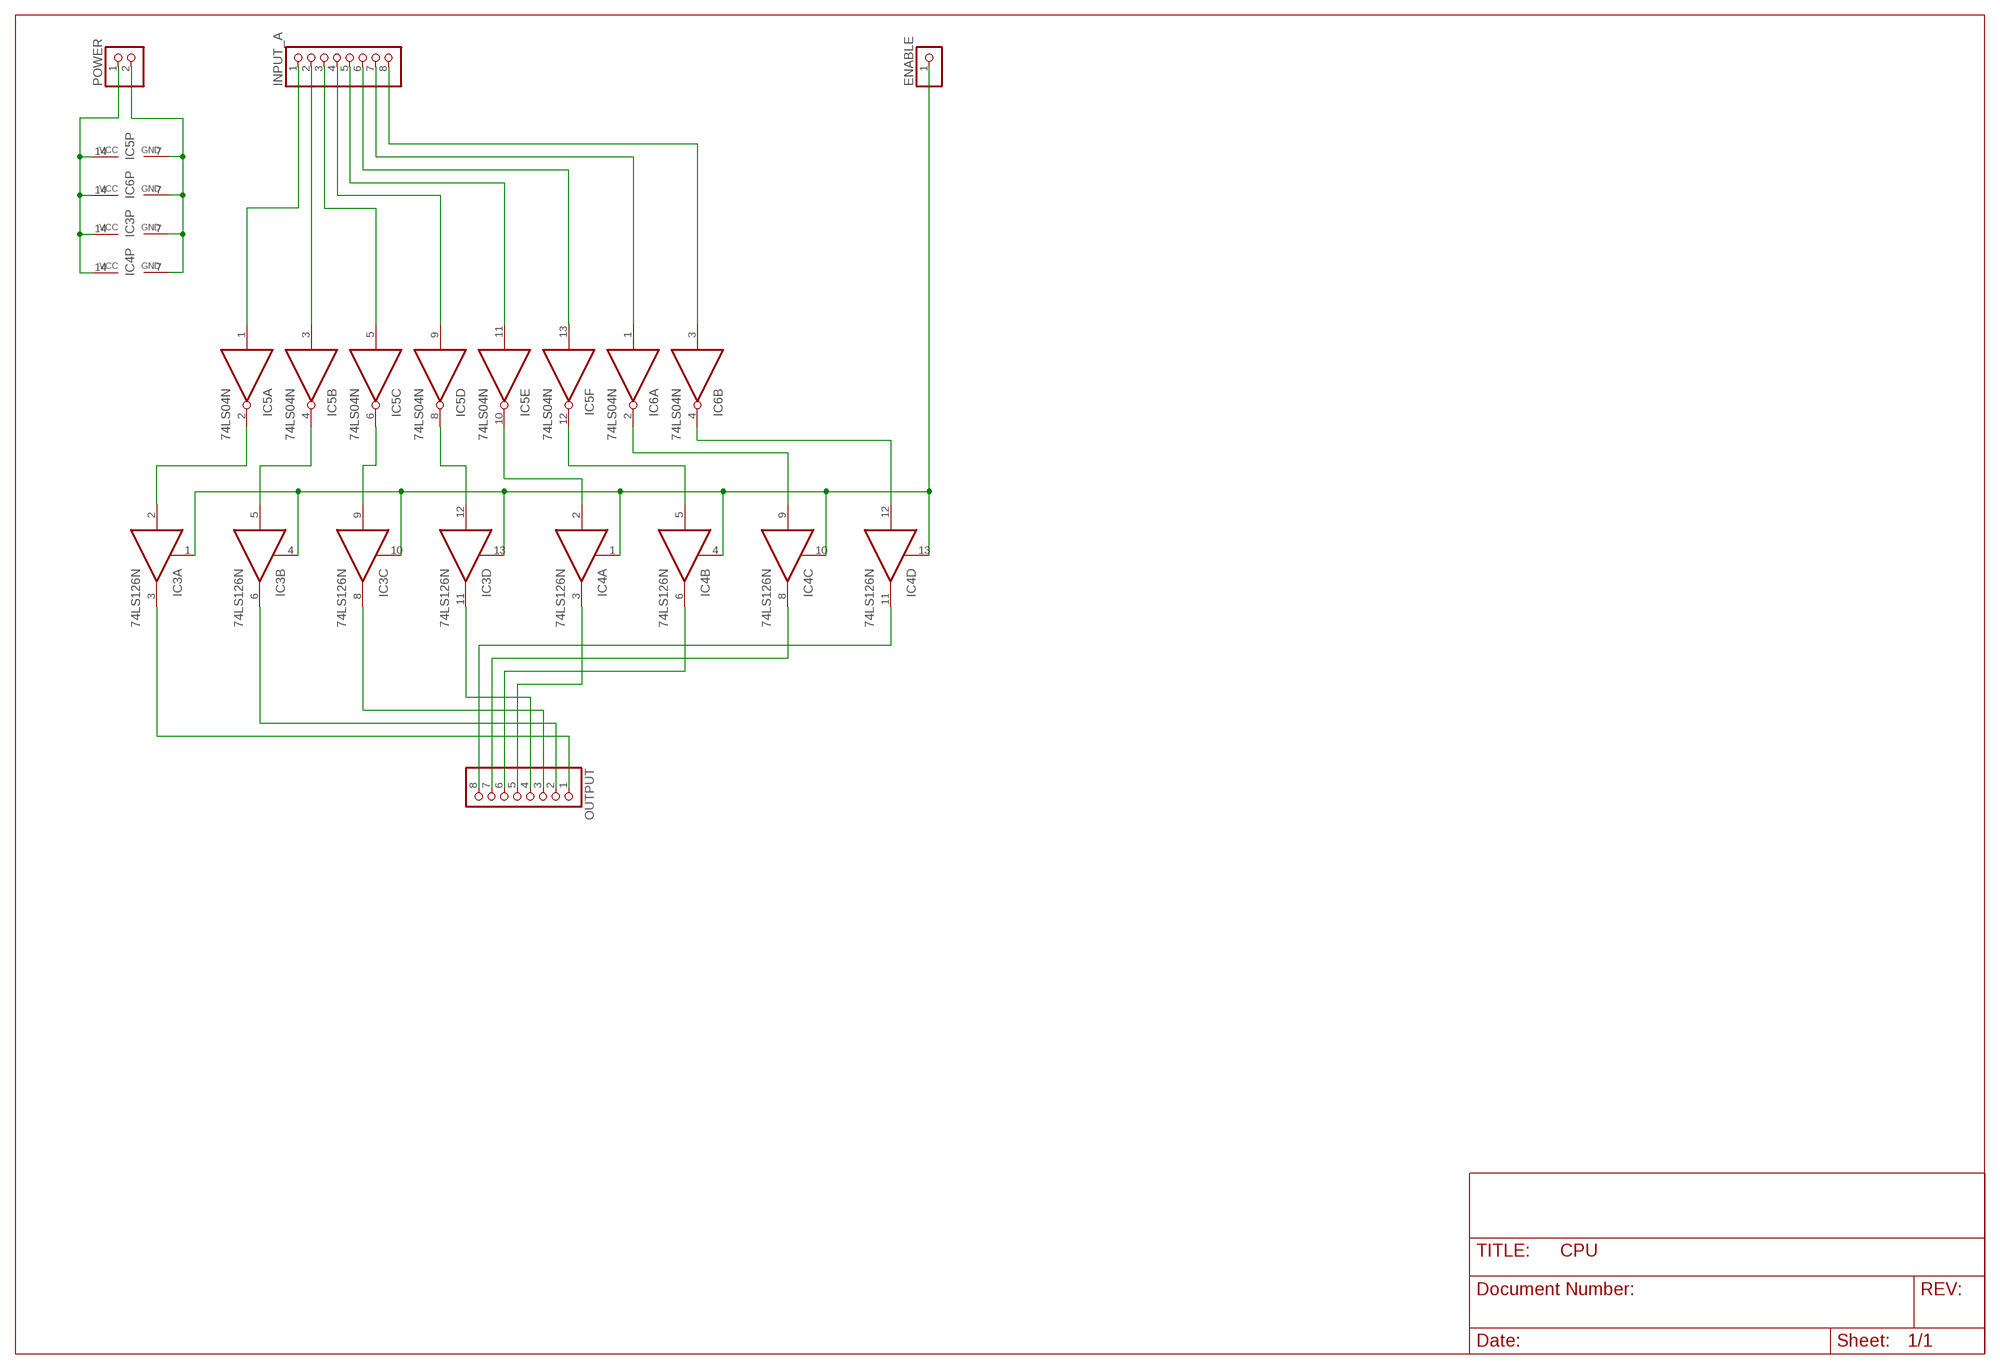
[diagram p21: schematic, module NOT, sheet 1]

### Parts
ENABLE  PINHD-1X1  [1X01]
IC3  74LS126N  [DIL14]
IC4  74LS126N  [DIL14]
IC5  74LS04N  [DIL14]
IC6  74LS04N  [DIL14]
INPUT_A  PINHD-1X8  [1X08]
OUTPUT  PINHD-1X8  [1X08]
POWER  PINHD-1X2  [1X02]

### Nets
ENABLE: ENABLE.1 IC3.1(A:OE) IC3.4(B:OE) IC3.10(C:OE) IC3.13(D:OE) IC4.1(A:OE) IC4.4(B:OE) IC4.10(C:OE) IC4.13(D:OE)
GND: IC3.7(P:GND) IC4.7(P:GND) IC5.7(P:GND) IC6.7(P:GND) POWER.2
INPUT1: IC5.1(A:I) INPUT_A.1
INPUT2: IC5.3(B:I) INPUT_A.2
INPUT3: IC5.5(C:I) INPUT_A.3
INPUT4: IC5.9(D:I) INPUT_A.4
INPUT5: IC5.11(E:I) INPUT_A.5
INPUT6: IC5.13(F:I) INPUT_A.6
INPUT7: IC6.1(A:I) INPUT_A.7
INPUT8: IC6.3(B:I) INPUT_A.8
N$18: IC3.5(B:I) IC5.4(B:O)
N$19: IC3.9(C:I) IC5.6(C:O)
N$20: IC3.12(D:I) IC5.8(D:O)
N$21: IC4.2(A:I) IC5.10(E:O)
N$22: IC4.5(B:I) IC5.12(F:O)
N$23: IC4.9(C:I) IC6.2(A:O)
N$24: IC4.12(D:I) IC6.4(B:O)
N$34: IC3.2(A:I) IC5.2(A:O)
OUTPUT1: IC3.3(A:O) OUTPUT.1
OUTPUT2: IC3.6(B:O) OUTPUT.2
OUTPUT3: IC3.8(C:O) OUTPUT.3
OUTPUT4: IC3.11(D:O) OUTPUT.4
OUTPUT5: IC4.3(A:O) OUTPUT.5
OUTPUT6: IC4.6(B:O) OUTPUT.6
OUTPUT7: IC4.8(C:O) OUTPUT.7
OUTPUT8: IC4.11(D:O) OUTPUT.8
VCC: IC3.14(P:VCC) IC4.14(P:VCC) IC5.14(P:VCC) IC6.14(P:VCC) POWER.1
Unconnected: IC6.5(C:I) IC6.6(C:O) IC6.8(D:O) IC6.9(D:I) IC6.10(E:O) IC6.11(E:I) IC6.12(F:O) IC6.13(F:I)

### Library data of the parts
ENABLE = pinhead:PINHD-1X1: PIN HEADER
IC3 IC4 = 74xx-eu:74*126: Quad bus BUFFER, 3-state
IC5 IC6 = 74xx-eu:74*04: Hex INVERTER
INPUT_A OUTPUT = pinhead:PINHD-1X8: PIN HEADER
POWER = pinhead:PINHD-1X2: PIN HEADER

## Module SHL
Ports: INPUT1(in) INPUT2(in) INPUT3(in) INPUT4(in) INPUT5(in) INPUT6(in) INPUT7(in) OUTPUT1(out) OUTPUT2(out) OUTPUT3(out) OUTPUT4(out) OUTPUT5(out) OUTPUT6(out) OUTPUT7(out) OUTPUT8(out) VCC(in) GND(in) ENABLE(in) CARRY_OUT(out) INPUT8(in)
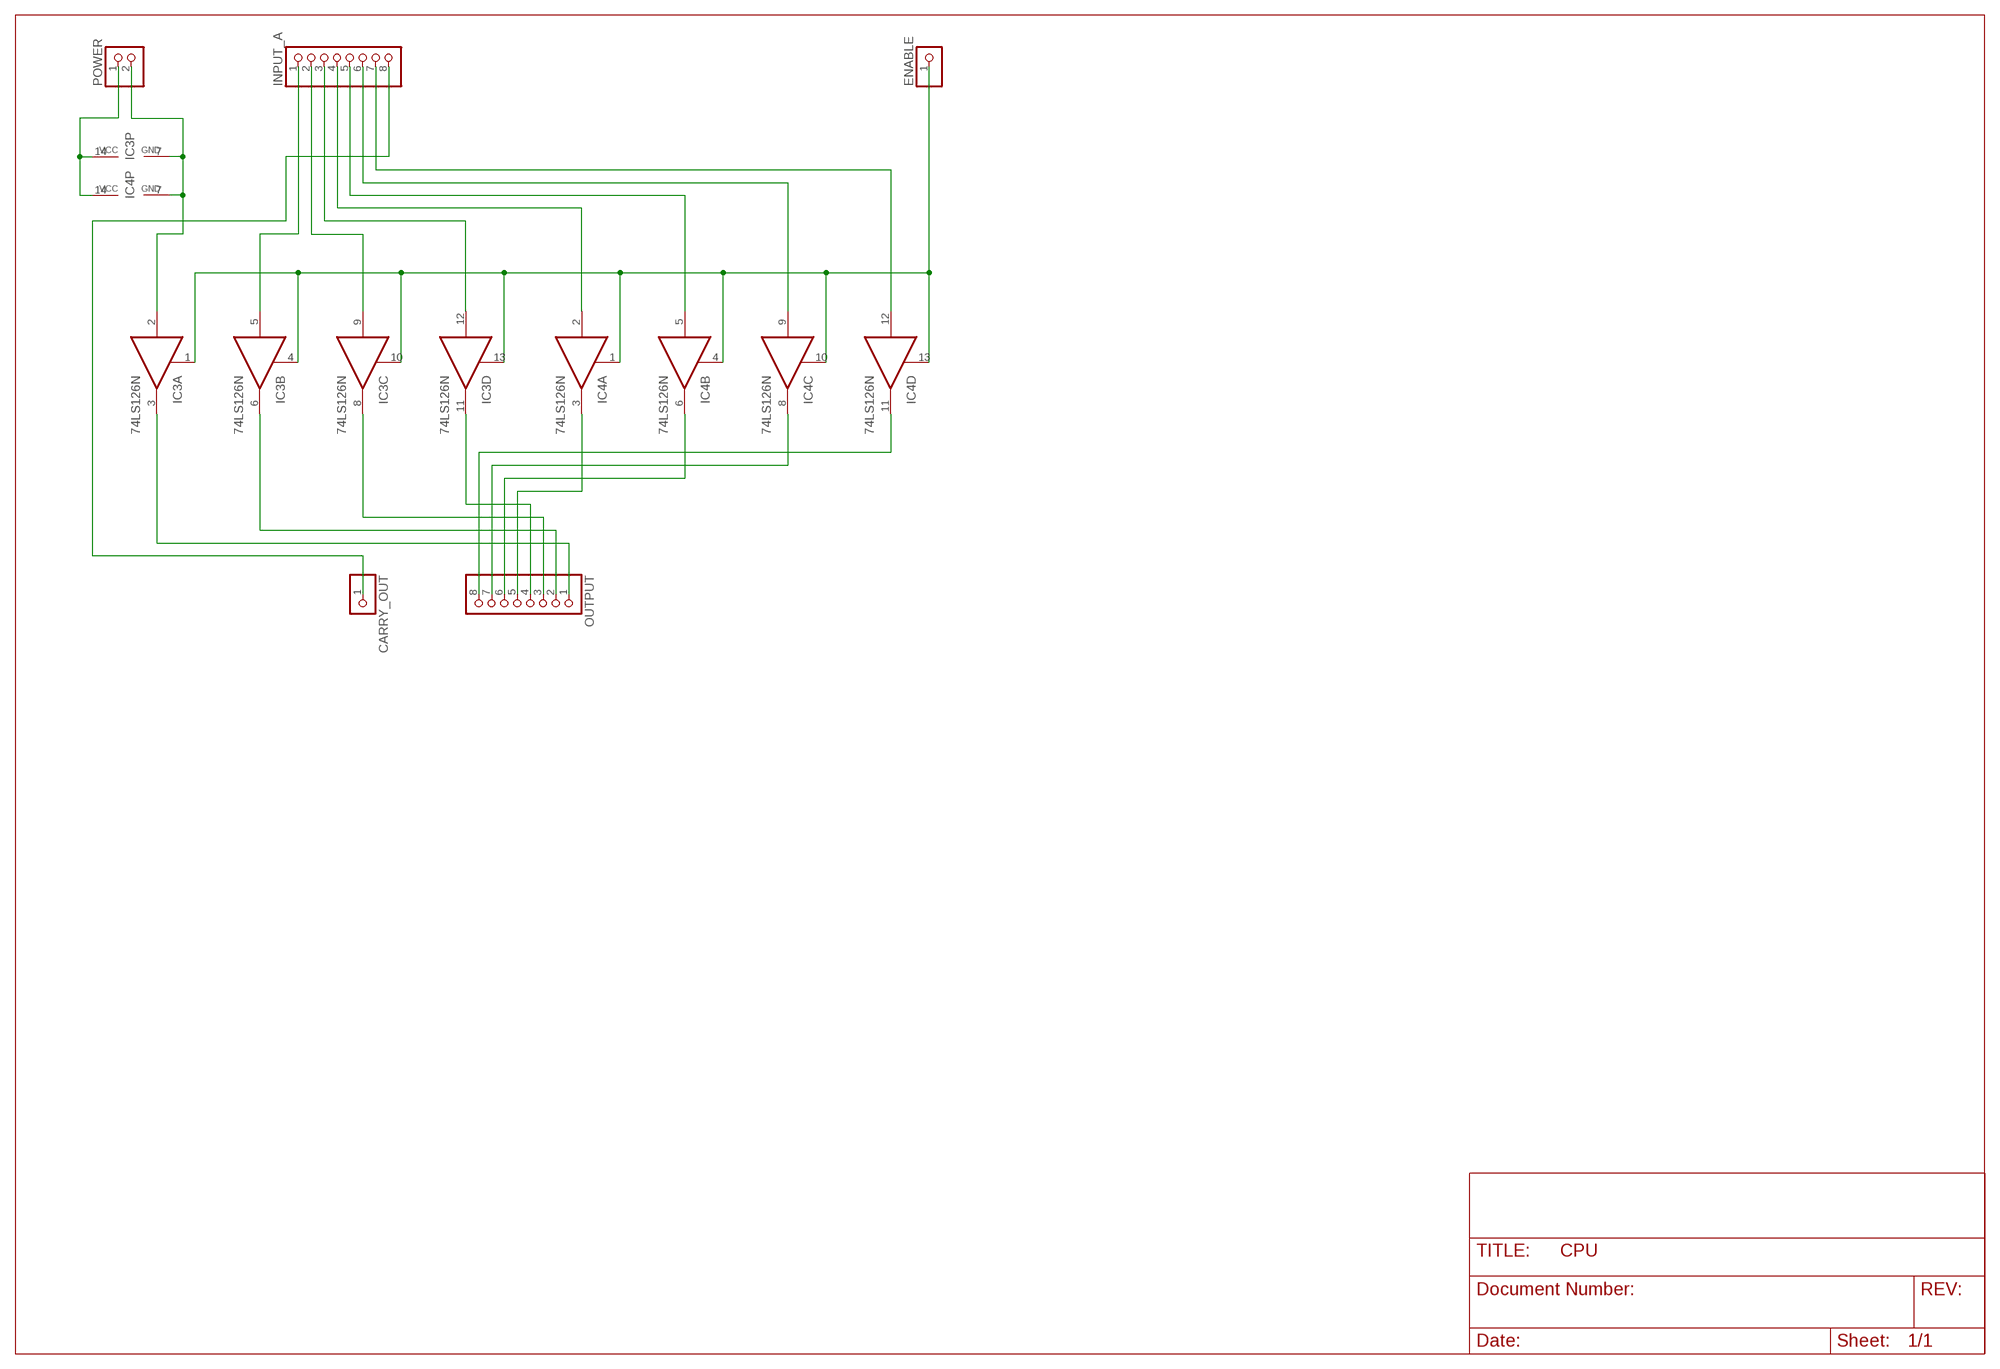
[diagram p22: schematic, module SHL, sheet 1]

### Parts
CARRY_OUT  PINHD-1X1  [1X01]
ENABLE  PINHD-1X1  [1X01]
IC3  74LS126N  [DIL14]
IC4  74LS126N  [DIL14]
INPUT_A  PINHD-1X8  [1X08]
OUTPUT  PINHD-1X8  [1X08]
POWER  PINHD-1X2  [1X02]

### Nets
ENABLE: ENABLE.1 IC3.1(A:OE) IC3.4(B:OE) IC3.10(C:OE) IC3.13(D:OE) IC4.1(A:OE) IC4.4(B:OE) IC4.10(C:OE) IC4.13(D:OE)
GND: IC3.2(A:I) IC3.7(P:GND) IC4.7(P:GND) POWER.2
INPUT1: IC3.5(B:I) INPUT_A.1
INPUT2: IC3.9(C:I) INPUT_A.2
INPUT3: IC3.12(D:I) INPUT_A.3
INPUT4: IC4.2(A:I) INPUT_A.4
INPUT5: IC4.5(B:I) INPUT_A.5
INPUT6: IC4.9(C:I) INPUT_A.6
INPUT7: IC4.12(D:I) INPUT_A.7
INPUT8: CARRY_OUT.1 INPUT_A.8
OUTPUT1: IC3.3(A:O) OUTPUT.1
OUTPUT2: IC3.6(B:O) OUTPUT.2
OUTPUT3: IC3.8(C:O) OUTPUT.3
OUTPUT4: IC3.11(D:O) OUTPUT.4
OUTPUT5: IC4.3(A:O) OUTPUT.5
OUTPUT6: IC4.6(B:O) OUTPUT.6
OUTPUT7: IC4.8(C:O) OUTPUT.7
OUTPUT8: IC4.11(D:O) OUTPUT.8
VCC: IC3.14(P:VCC) IC4.14(P:VCC) POWER.1

### Library data of the parts
CARRY_OUT ENABLE = pinhead:PINHD-1X1: PIN HEADER
IC3 IC4 = 74xx-eu:74*126: Quad bus BUFFER, 3-state
INPUT_A OUTPUT = pinhead:PINHD-1X8: PIN HEADER
POWER = pinhead:PINHD-1X2: PIN HEADER

## Module ADC
Ports: INPUT_A_1(in) INPUT_A_2(in) INPUT_A_3(in) INPUT_A_4(in) INPUT_A_5(in) INPUT_A_6(in) INPUT_A_7(in) INPUT_A_8(in) INPUT_B_1(in) INPUT_B_2(in) INPUT_B_3(in) INPUT_B_4(in) INPUT_B_5(in) INPUT_B_6(in) INPUT_B_7(in) INPUT_B_8(in) OUTPUT1(out) OUTPUT2(out) OUTPUT3(out) OUTPUT4(out) OUTPUT5(out) OUTPUT6(out) OUTPUT8(out) OUTPUT7(out) VCC(in) GND(in) ENABLE(in) CARRY_IN(in) CARRY_OUT(out)
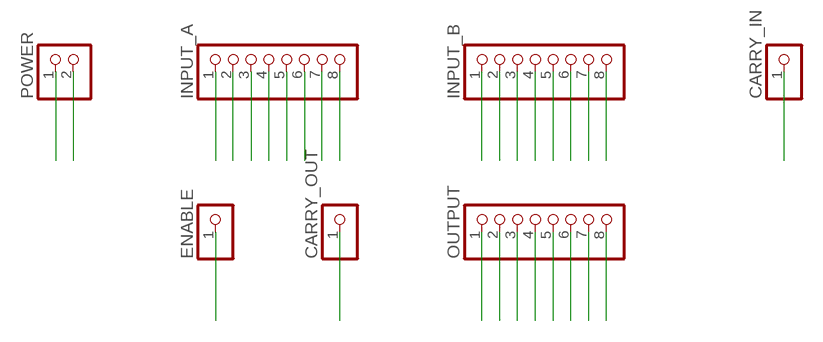
[diagram p23: schematic, module ADC, sheet 1]

### Parts
CARRY_IN  PINHD-1X1  [1X01]
CARRY_OUT  PINHD-1X1  [1X01]
ENABLE  PINHD-1X1  [1X01]
INPUT_A  PINHD-1X8  [1X08]
INPUT_B  PINHD-1X8  [1X08]
OUTPUT  PINHD-1X8  [1X08]
POWER  PINHD-1X2  [1X02]

### Nets
CARRY_IN: CARRY_IN.1
CARRY_OUT: CARRY_OUT.1
ENABLE: ENABLE.1
GND: POWER.2
INPUT_A_1: INPUT_A.1
INPUT_A_2: INPUT_A.2
INPUT_A_3: INPUT_A.3
INPUT_A_4: INPUT_A.4
INPUT_A_5: INPUT_A.5
INPUT_A_6: INPUT_A.6
INPUT_A_7: INPUT_A.7
INPUT_A_8: INPUT_A.8
INPUT_B_1: INPUT_B.1
INPUT_B_2: INPUT_B.2
INPUT_B_3: INPUT_B.3
INPUT_B_4: INPUT_B.4
INPUT_B_5: INPUT_B.5
INPUT_B_6: INPUT_B.6
INPUT_B_7: INPUT_B.7
INPUT_B_8: INPUT_B.8
OUTPUT1: OUTPUT.1
OUTPUT2: OUTPUT.2
OUTPUT3: OUTPUT.3
OUTPUT4: OUTPUT.4
OUTPUT5: OUTPUT.5
OUTPUT6: OUTPUT.6
OUTPUT7: OUTPUT.7
OUTPUT8: OUTPUT.8
VCC: POWER.1

### Library data of the parts
CARRY_IN CARRY_OUT ENABLE = pinhead:PINHD-1X1: PIN HEADER
INPUT_A INPUT_B OUTPUT = pinhead:PINHD-1X8: PIN HEADER
POWER = pinhead:PINHD-1X2: PIN HEADER

## Module SUB
Ports: 

### Library data of the parts

## Module NEG
Ports: INPUT1(in) INPUT2(in) INPUT3(in) INPUT4(in) INPUT5(in) INPUT6(in) INPUT7(in) INPUT8(in) OUTPUT1(out) OUTPUT2(out) OUTPUT3(out) OUTPUT4(out) OUTPUT5(out) OUTPUT6(out) OUTPUT7(out) OUTPUT8(out) VCC(in) GND(in) ENABLE(in)
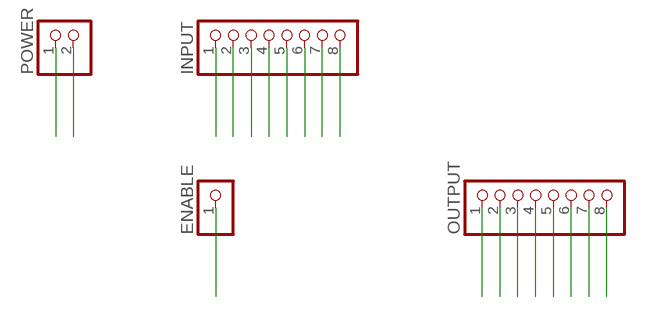
[diagram p24: schematic, module NEG, sheet 1]

### Parts
ENABLE  PINHD-1X1  [1X01]
INPUT  PINHD-1X8  [1X08]
OUTPUT  PINHD-1X8  [1X08]
POWER  PINHD-1X2  [1X02]

### Nets
ENABLE: ENABLE.1
GND: POWER.2
INPUT1: INPUT.1
INPUT2: INPUT.2
INPUT3: INPUT.3
INPUT4: INPUT.4
INPUT5: INPUT.5
INPUT6: INPUT.6
INPUT7: INPUT.7
INPUT8: INPUT.8
OUTPUT1: OUTPUT.1
OUTPUT2: OUTPUT.2
OUTPUT3: OUTPUT.3
OUTPUT4: OUTPUT.4
OUTPUT5: OUTPUT.5
OUTPUT6: OUTPUT.6
OUTPUT7: OUTPUT.7
OUTPUT8: OUTPUT.8
VCC: POWER.1

### Library data of the parts
ENABLE = pinhead:PINHD-1X1: PIN HEADER
INPUT OUTPUT = pinhead:PINHD-1X8: PIN HEADER
POWER = pinhead:PINHD-1X2: PIN HEADER

## Module RCL
Ports: INPUT1(in) INPUT2(in) INPUT3(in) INPUT4(in) INPUT5(in) INPUT6(in) INPUT7(in) INPUT8(in) OUTPUT1(out) OUTPUT2(out) OUTPUT3(out) OUTPUT4(out) OUTPUT5(out) OUTPUT6(out) OUTPUT7(out) OUTPUT8(out) VCC(in) GND(in) ENABLE(in) CARRY_IN(in) CARRY_OUT(out)
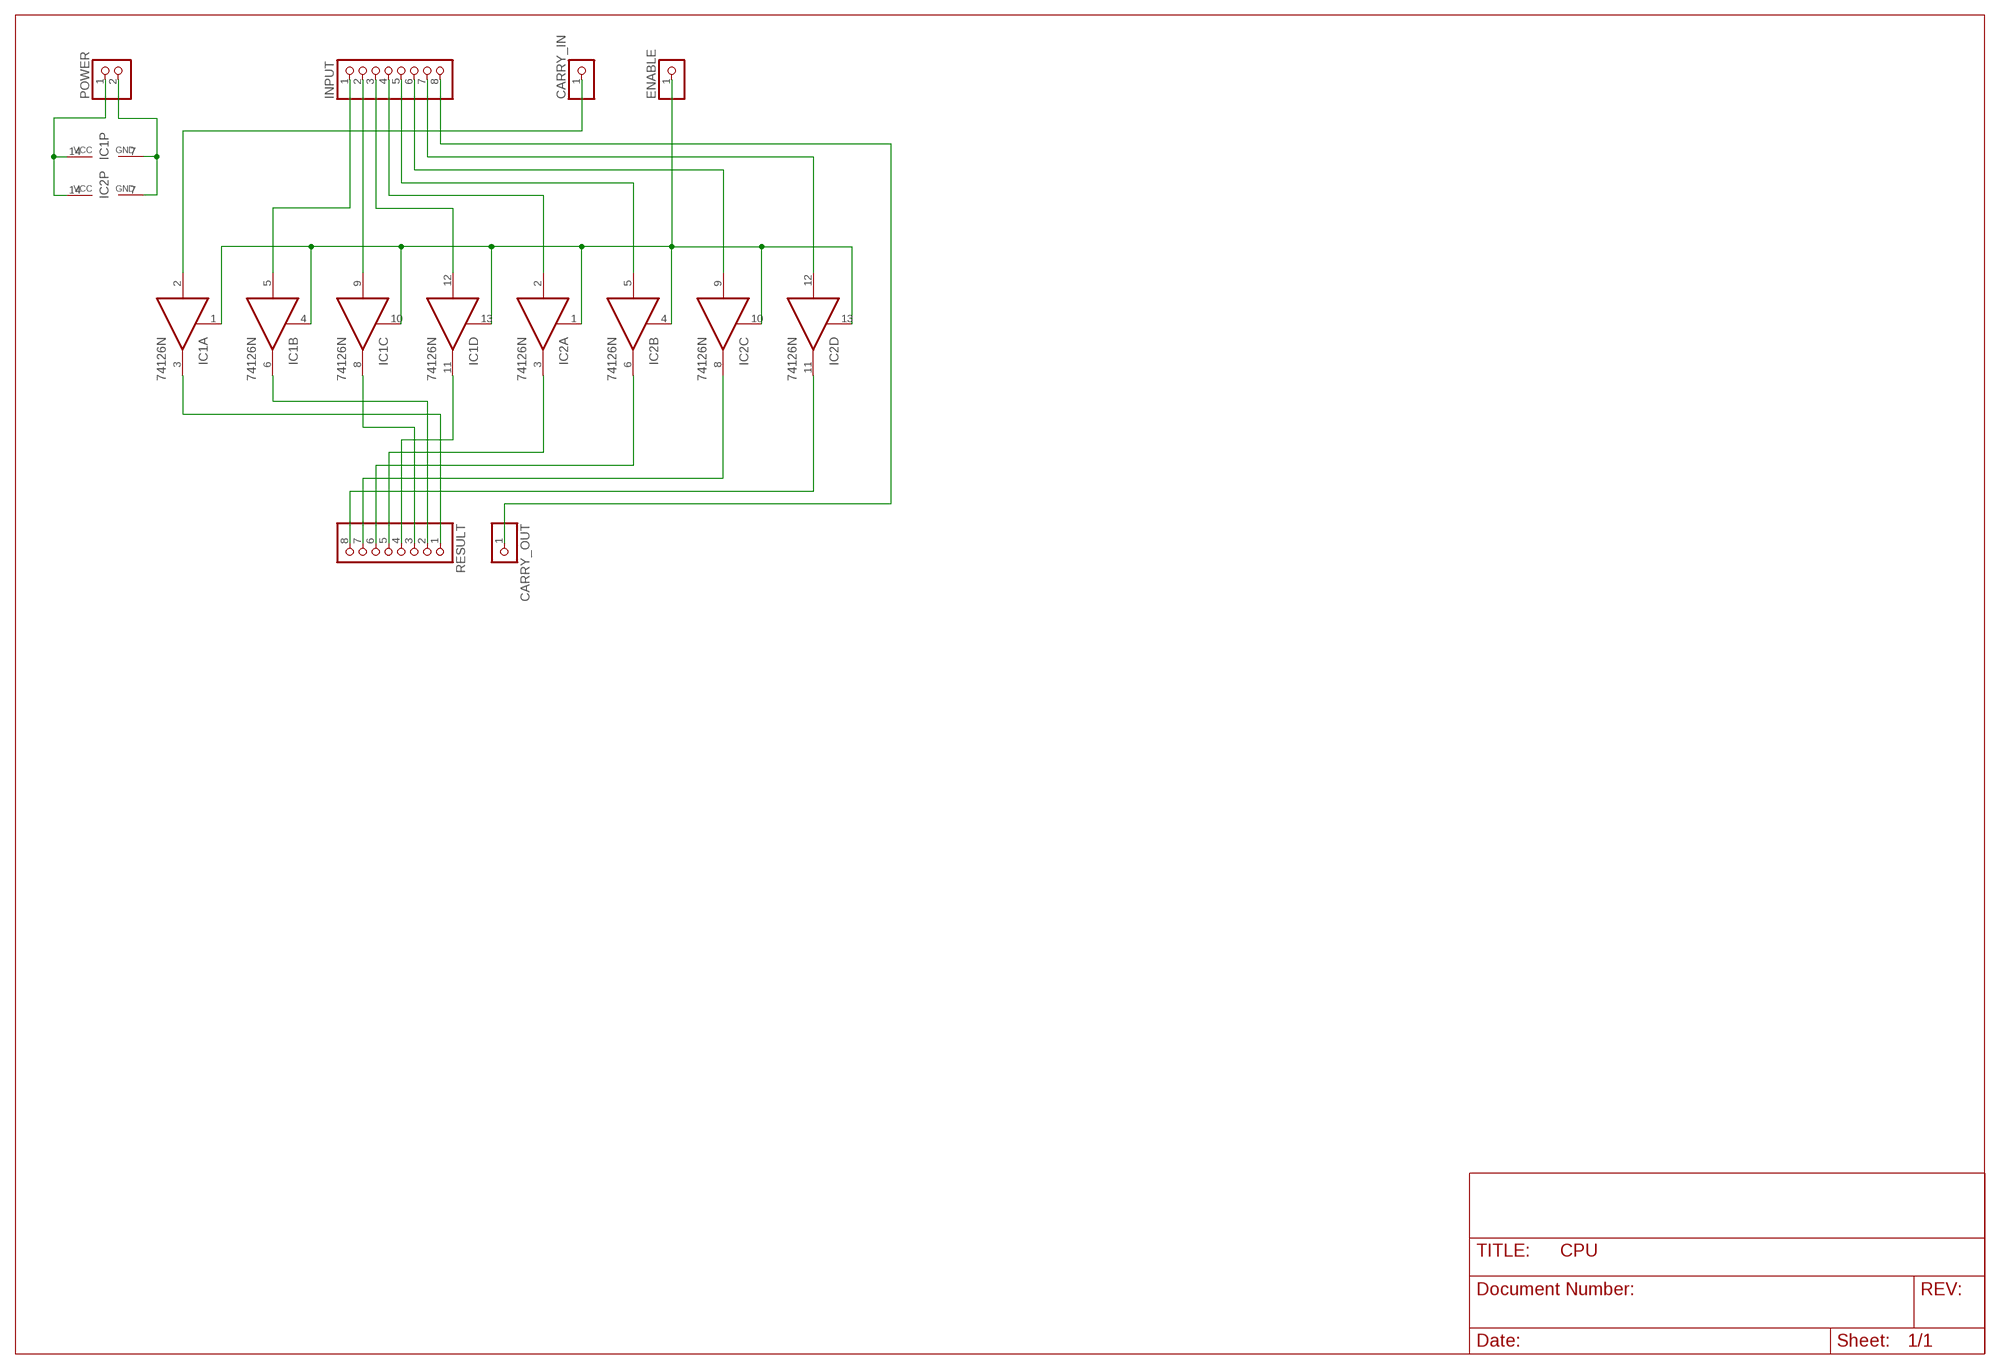
[diagram p25: schematic, module RCL, sheet 1]

### Parts
CARRY_IN  PINHD-1X1  [1X01]
CARRY_OUT  PINHD-1X1  [1X01]
ENABLE  PINHD-1X1  [1X01]
IC1  74126N  [DIL14]
IC2  74126N  [DIL14]
INPUT  PINHD-1X8  [1X08]
POWER  PINHD-1X2  [1X02]
RESULT  PINHD-1X8  [1X08]

### Nets
CARRY_IN: CARRY_IN.1 IC1.2(A:I)
CARRY_OUT: CARRY_OUT.1 INPUT.8
ENABLE: ENABLE.1 IC1.1(A:OE) IC1.4(B:OE) IC1.10(C:OE) IC1.13(D:OE) IC2.1(A:OE) IC2.4(B:OE) IC2.10(C:OE) IC2.13(D:OE)
GND: IC1.7(P:GND) IC2.7(P:GND) POWER.2
INPUT1: IC1.5(B:I) INPUT.1
INPUT2: IC1.9(C:I) INPUT.2
INPUT3: IC1.12(D:I) INPUT.3
INPUT4: IC2.2(A:I) INPUT.4
INPUT5: IC2.5(B:I) INPUT.5
INPUT6: IC2.9(C:I) INPUT.6
INPUT7: IC2.12(D:I) INPUT.7
OUTPUT1: IC1.3(A:O) RESULT.1
OUTPUT2: IC1.6(B:O) RESULT.2
OUTPUT3: IC1.8(C:O) RESULT.3
OUTPUT4: IC1.11(D:O) RESULT.4
OUTPUT5: IC2.3(A:O) RESULT.5
OUTPUT6: IC2.6(B:O) RESULT.6
OUTPUT7: IC2.8(C:O) RESULT.7
OUTPUT8: IC2.11(D:O) RESULT.8
VCC: IC1.14(P:VCC) IC2.14(P:VCC) POWER.1

### Library data of the parts
CARRY_IN CARRY_OUT ENABLE = pinhead:PINHD-1X1: PIN HEADER
IC1 IC2 = 74xx-eu:74*126: Quad bus BUFFER, 3-state
INPUT RESULT = pinhead:PINHD-1X8: PIN HEADER
POWER = pinhead:PINHD-1X2: PIN HEADER

## Module SHR
Ports: INPUT1(in) INPUT2(in) INPUT3(in) INPUT4(in) INPUT5(in) INPUT6(in) INPUT7(in) INPUT8(in) OUTPUT1(out) OUTPUT2(out) OUTPUT3(out) OUTPUT4(out) OUTPUT5(out) OUTPUT6(out) OUTPUT7(out) OUTPUT8(out) VCC(in) GND(in) ENABLE(in) CARRY_OUT(out)
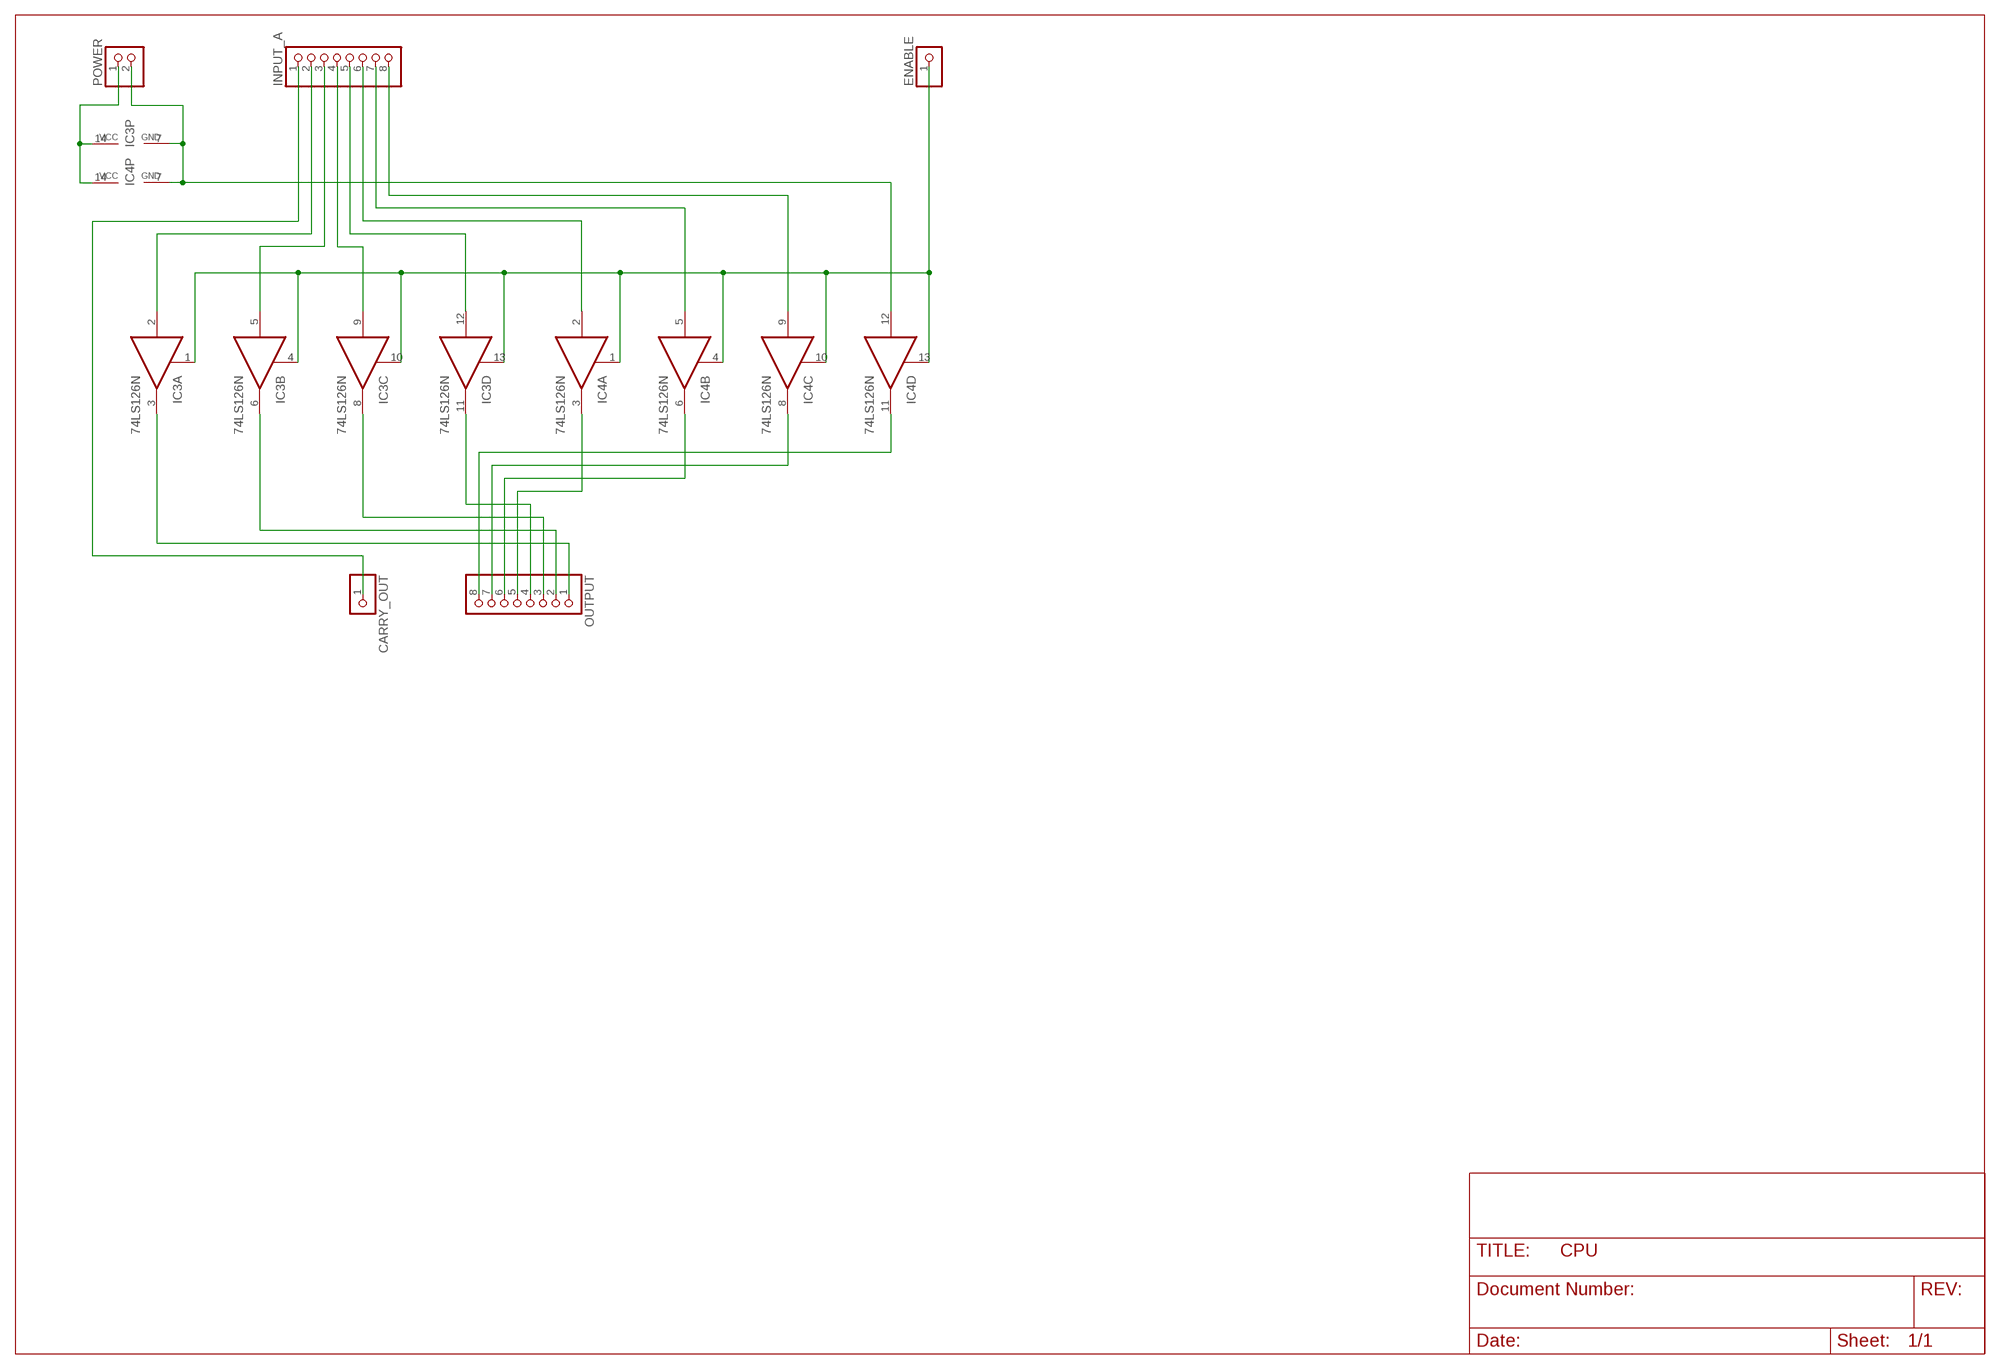
[diagram p26: schematic, module SHR, sheet 1]

### Parts
CARRY_OUT  PINHD-1X1  [1X01]
ENABLE  PINHD-1X1  [1X01]
IC3  74LS126N  [DIL14]
IC4  74LS126N  [DIL14]
INPUT_A  PINHD-1X8  [1X08]
OUTPUT  PINHD-1X8  [1X08]
POWER  PINHD-1X2  [1X02]

### Nets
CARRY_OUT: CARRY_OUT.1 INPUT_A.1
ENABLE: ENABLE.1 IC3.1(A:OE) IC3.4(B:OE) IC3.10(C:OE) IC3.13(D:OE) IC4.1(A:OE) IC4.4(B:OE) IC4.10(C:OE) IC4.13(D:OE)
GND: IC3.7(P:GND) IC4.7(P:GND) IC4.12(D:I) POWER.2
INPUT2: IC3.2(A:I) INPUT_A.2
INPUT3: IC3.5(B:I) INPUT_A.3
INPUT4: IC3.9(C:I) INPUT_A.4
INPUT5: IC3.12(D:I) INPUT_A.5
INPUT6: IC4.2(A:I) INPUT_A.6
INPUT7: IC4.5(B:I) INPUT_A.7
INPUT8: IC4.9(C:I) INPUT_A.8
OUTPUT1: IC3.3(A:O) OUTPUT.1
OUTPUT2: IC3.6(B:O) OUTPUT.2
OUTPUT3: IC3.8(C:O) OUTPUT.3
OUTPUT4: IC3.11(D:O) OUTPUT.4
OUTPUT5: IC4.3(A:O) OUTPUT.5
OUTPUT6: IC4.6(B:O) OUTPUT.6
OUTPUT7: IC4.8(C:O) OUTPUT.7
OUTPUT8: IC4.11(D:O) OUTPUT.8
VCC: IC3.14(P:VCC) IC4.14(P:VCC) POWER.1

### Library data of the parts
CARRY_OUT ENABLE = pinhead:PINHD-1X1: PIN HEADER
IC3 IC4 = 74xx-eu:74*126: Quad bus BUFFER, 3-state
INPUT_A OUTPUT = pinhead:PINHD-1X8: PIN HEADER
POWER = pinhead:PINHD-1X2: PIN HEADER

## Module SAR
Ports: INPUT1(in) INPUT2(in) INPUT3(in) INPUT4(in) INPUT5(in) INPUT6(in) INPUT7(in) INPUT8(in) OUTPUT1(out) OUTPUT2(out) OUTPUT3(out) OUTPUT4(out) OUTPUT6(out) OUTPUT5(out) OUTPUT7(out) OUTPUT8(out) VCC(in) GND(in) ENABLE(in)
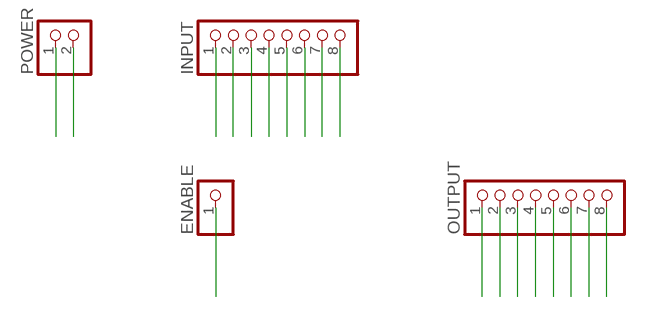
[diagram p27: schematic, module SAR, sheet 1]

### Parts
ENABLE  PINHD-1X1  [1X01]
INPUT  PINHD-1X8  [1X08]
OUTPUT  PINHD-1X8  [1X08]
POWER  PINHD-1X2  [1X02]

### Nets
ENABLE: ENABLE.1
GND: POWER.2
INPUT1: INPUT.1
INPUT2: INPUT.2
INPUT3: INPUT.3
INPUT4: INPUT.4
INPUT5: INPUT.5
INPUT6: INPUT.6
INPUT7: INPUT.7
INPUT8: INPUT.8
OUTPUT1: OUTPUT.1
OUTPUT2: OUTPUT.2
OUTPUT3: OUTPUT.3
OUTPUT4: OUTPUT.4
OUTPUT5: OUTPUT.5
OUTPUT6: OUTPUT.6
OUTPUT7: OUTPUT.7
OUTPUT8: OUTPUT.8
VCC: POWER.1

### Library data of the parts
ENABLE = pinhead:PINHD-1X1: PIN HEADER
INPUT OUTPUT = pinhead:PINHD-1X8: PIN HEADER
POWER = pinhead:PINHD-1X2: PIN HEADER

## Module RCR
Ports: INPUT1(in) INPUT2(in) INPUT3(in) INPUT4(in) INPUT5(in) INPUT6(in) INPUT7(in) INPUT8(in) OUTPUT1(out) OUTPUT2(out) OUTPUT3(out) OUTPUT4(out) OUTPUT5(out) OUTPUT6(out) OUTPUT7(out) OUTPUT8(out) VCC(in) GND(in) ENABLE(in) CARRY_IN(in) CARRY_OUT(out)
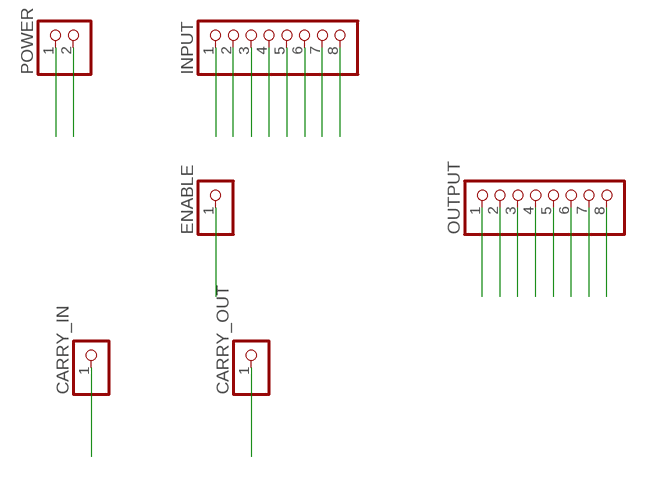
[diagram p28: schematic, module RCR, sheet 1]

### Parts
CARRY_IN  PINHD-1X1  [1X01]
CARRY_OUT  PINHD-1X1  [1X01]
ENABLE  PINHD-1X1  [1X01]
INPUT  PINHD-1X8  [1X08]
OUTPUT  PINHD-1X8  [1X08]
POWER  PINHD-1X2  [1X02]

### Nets
CARRY_IN: CARRY_IN.1
CARRY_OUT: CARRY_OUT.1
ENABLE: ENABLE.1
GND: POWER.2
INPUT1: INPUT.1
INPUT2: INPUT.2
INPUT3: INPUT.3
INPUT4: INPUT.4
INPUT5: INPUT.5
INPUT6: INPUT.6
INPUT7: INPUT.7
INPUT8: INPUT.8
OUTPUT1: OUTPUT.1
OUTPUT2: OUTPUT.2
OUTPUT3: OUTPUT.3
OUTPUT4: OUTPUT.4
OUTPUT5: OUTPUT.5
OUTPUT6: OUTPUT.6
OUTPUT7: OUTPUT.7
OUTPUT8: OUTPUT.8
VCC: POWER.1

### Library data of the parts
CARRY_IN CARRY_OUT ENABLE = pinhead:PINHD-1X1: PIN HEADER
INPUT OUTPUT = pinhead:PINHD-1X8: PIN HEADER
POWER = pinhead:PINHD-1X2: PIN HEADER

## Module MOV8
Ports: INPUT_A_1(in) INPUT_A_2(in) INPUT_A_3(in) INPUT_A_4(in) INPUT_B_1(in) INPUT_B_2(in) INPUT_B_3(in) INPUT_B_4(in) OUTPUT1(out) OUTPUT2(out) OUTPUT3(out) OUTPUT4(out) OUTPUT5(out) OUTPUT6(out) OUTPUT7(out) OUTPUT8(out) VCC(in) GND(in) ENABLE(in)
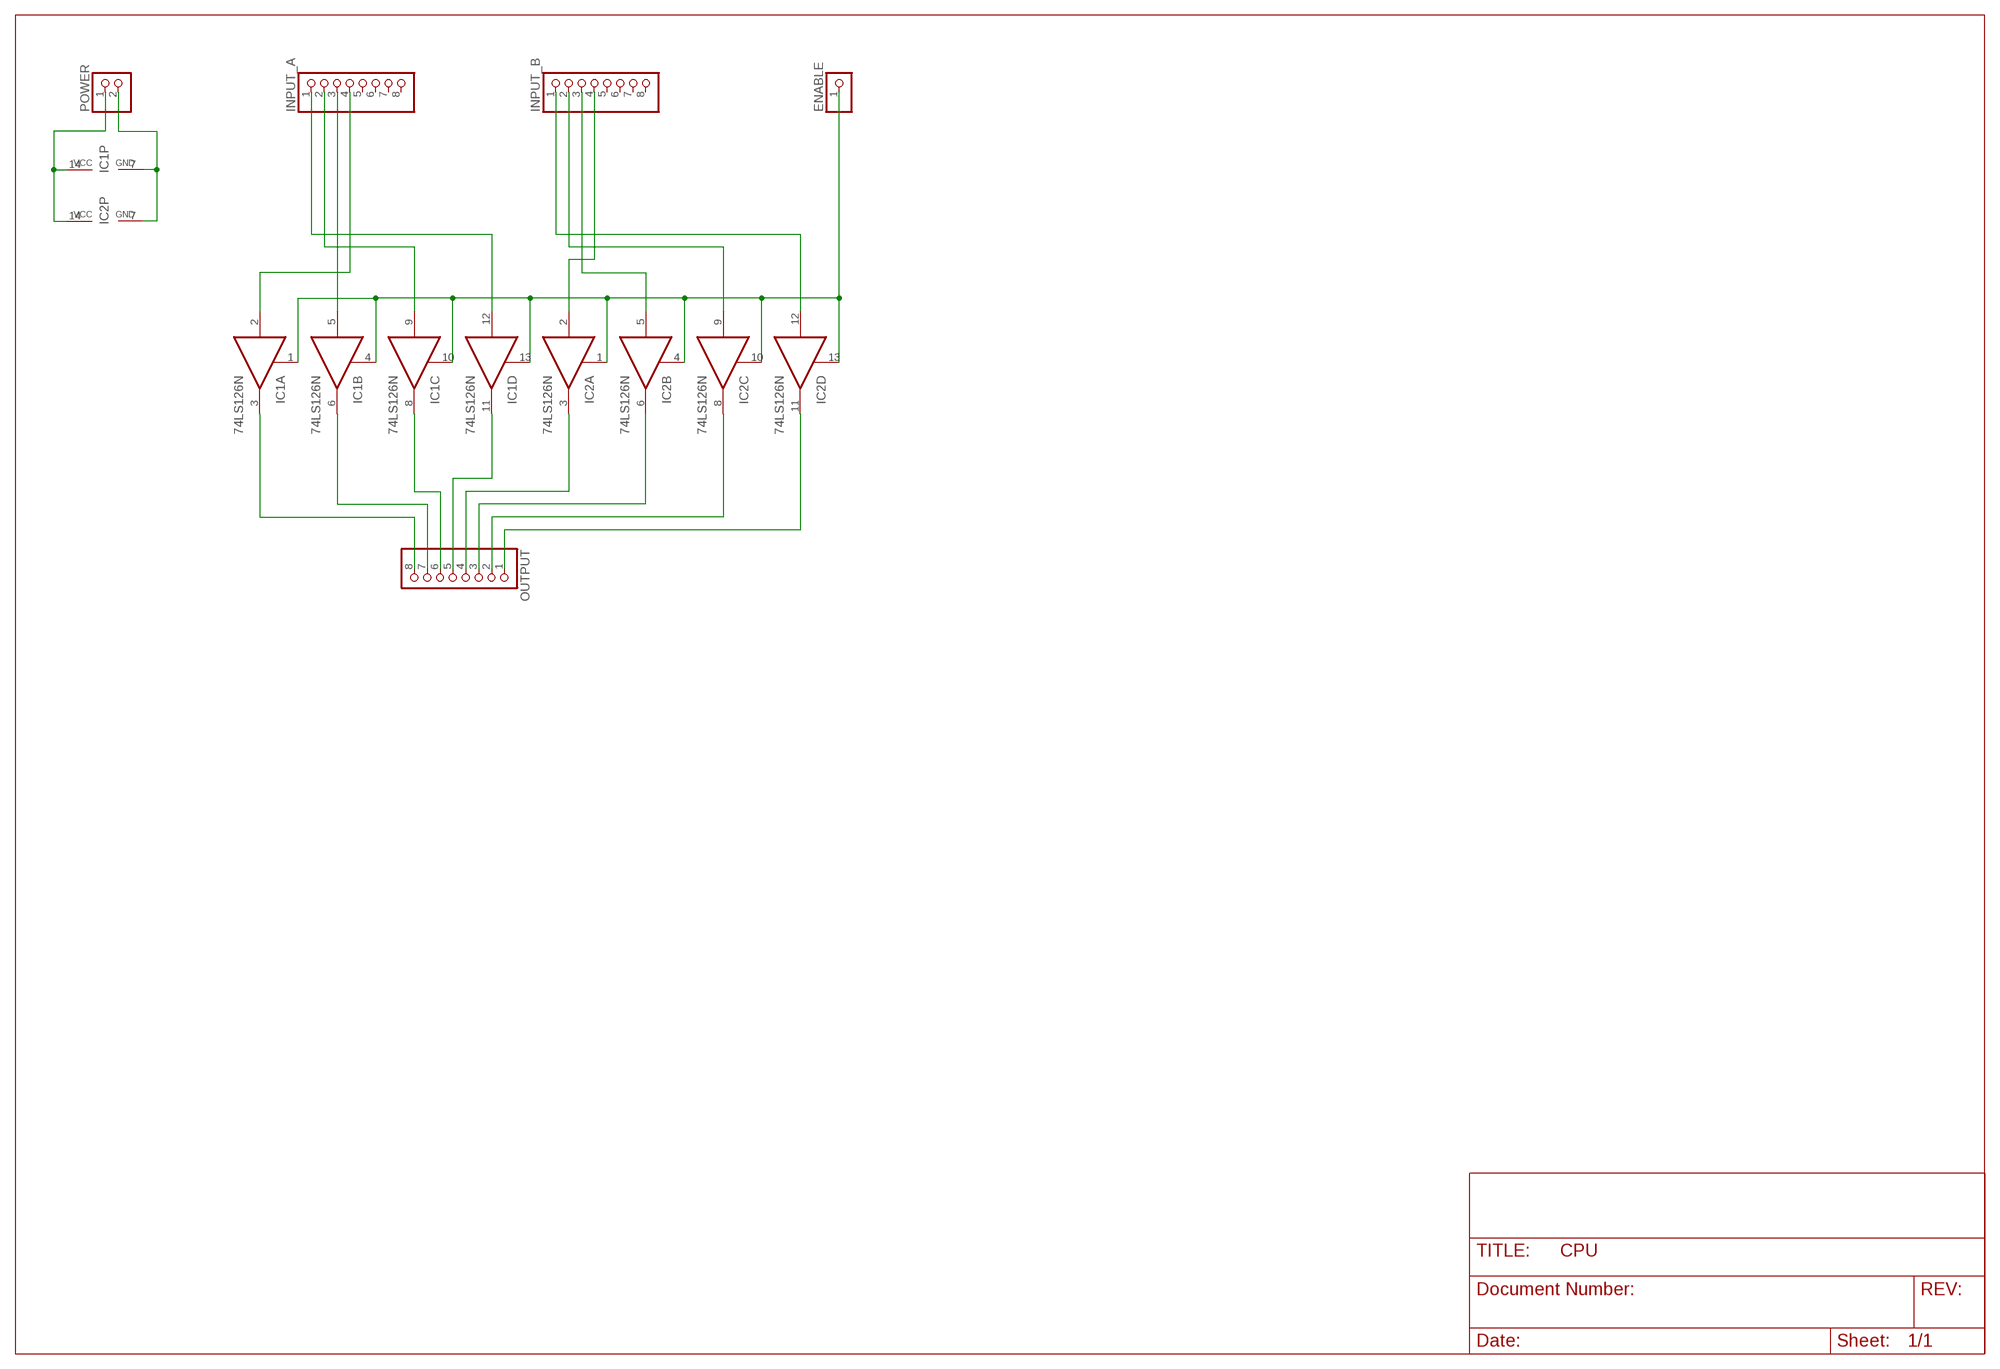
[diagram p29: schematic, module MOV8, sheet 1]

### Parts
ENABLE  PINHD-1X1  [1X01]
IC1  74LS126N  [DIL14]
IC2  74LS126N  [DIL14]
INPUT_A  PINHD-1X8  [1X08]
INPUT_B  PINHD-1X8  [1X08]
OUTPUT  PINHD-1X8  [1X08]
POWER  PINHD-1X2  [1X02]

### Nets
ENABLE: ENABLE.1 IC1.1(A:OE) IC1.4(B:OE) IC1.10(C:OE) IC1.13(D:OE) IC2.1(A:OE) IC2.4(B:OE) IC2.10(C:OE) IC2.13(D:OE)
GND: IC1.7(P:GND) IC2.7(P:GND) POWER.2
INPUT_A_1: IC1.12(D:I) INPUT_A.1
INPUT_A_2: IC1.9(C:I) INPUT_A.2
INPUT_A_3: IC1.5(B:I) INPUT_A.3
INPUT_A_4: IC1.2(A:I) INPUT_A.4
INPUT_B_1: IC2.12(D:I) INPUT_B.1
INPUT_B_2: IC2.9(C:I) INPUT_B.2
INPUT_B_3: IC2.5(B:I) INPUT_B.3
INPUT_B_4: IC2.2(A:I) INPUT_B.4
OUTPUT1: IC2.11(D:O) OUTPUT.1
OUTPUT2: IC2.8(C:O) OUTPUT.2
OUTPUT3: IC2.6(B:O) OUTPUT.3
OUTPUT4: IC2.3(A:O) OUTPUT.4
OUTPUT5: IC1.11(D:O) OUTPUT.5
OUTPUT6: IC1.8(C:O) OUTPUT.6
OUTPUT7: IC1.6(B:O) OUTPUT.7
OUTPUT8: IC1.3(A:O) OUTPUT.8
VCC: IC1.14(P:VCC) IC2.14(P:VCC) POWER.1
Unconnected: INPUT_A.5 INPUT_A.6 INPUT_A.7 INPUT_A.8 INPUT_B.5 INPUT_B.6 INPUT_B.7 INPUT_B.8

### Library data of the parts
ENABLE = pinhead:PINHD-1X1: PIN HEADER
IC1 IC2 = 74xx-eu:74*126: Quad bus BUFFER, 3-state
INPUT_A INPUT_B OUTPUT = pinhead:PINHD-1X8: PIN HEADER
POWER = pinhead:PINHD-1X2: PIN HEADER

## Module SBB
Ports: INPUT_A_1(in) INPUT_A_2(in) INPUT_A_3(in) INPUT_A_4(in) INPUT_A_5(in) INPUT_A_6(in) INPUT_A_7(in) INPUT_A_8(in) INPUT_B_1(in) INPUT_B_2(in) INPUT_B_3(in) INPUT_B_4(in) INPUT_B_5(in) INPUT_B_6(in) INPUT_B_7(in) INPUT_B_8(in) OUTPUT1(out) OUTPUT2(out) OUTPUT3(out) OUTPUT4(out) OUTPUT5(out) OUTPUT6(out) OUTPUT7(out) OUTPUT8(out) VCC(in) GND(in) ENABLE(in) CARRY_IN(in) CARRY_OUT(out)
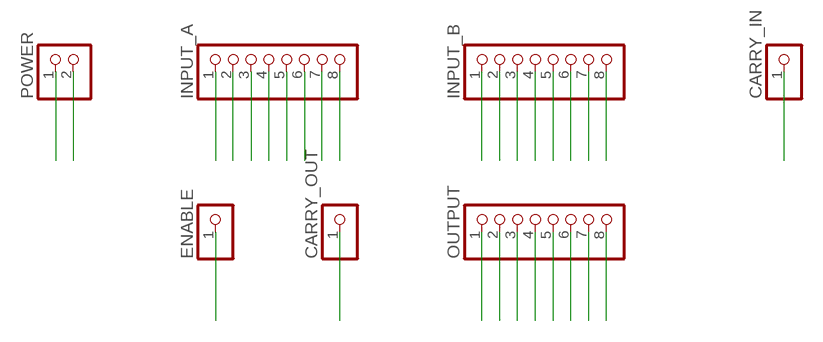
[diagram p30: schematic, module SBB, sheet 1]

### Parts
CARRY_IN  PINHD-1X1  [1X01]
CARRY_OUT  PINHD-1X1  [1X01]
ENABLE  PINHD-1X1  [1X01]
INPUT_A  PINHD-1X8  [1X08]
INPUT_B  PINHD-1X8  [1X08]
OUTPUT  PINHD-1X8  [1X08]
POWER  PINHD-1X2  [1X02]

### Nets
CARRY_IN: CARRY_IN.1
CARRY_OUT: CARRY_OUT.1
ENABLE: ENABLE.1
GND: POWER.2
INPUT_A_1: INPUT_A.1
INPUT_A_2: INPUT_A.2
INPUT_A_3: INPUT_A.3
INPUT_A_4: INPUT_A.4
INPUT_A_5: INPUT_A.5
INPUT_A_6: INPUT_A.6
INPUT_A_7: INPUT_A.7
INPUT_A_8: INPUT_A.8
INPUT_B_1: INPUT_B.1
INPUT_B_2: INPUT_B.2
INPUT_B_3: INPUT_B.3
INPUT_B_4: INPUT_B.4
INPUT_B_5: INPUT_B.5
INPUT_B_6: INPUT_B.6
INPUT_B_7: INPUT_B.7
INPUT_B_8: INPUT_B.8
OUTPUT1: OUTPUT.1
OUTPUT2: OUTPUT.2
OUTPUT3: OUTPUT.3
OUTPUT4: OUTPUT.4
OUTPUT5: OUTPUT.5
OUTPUT6: OUTPUT.6
OUTPUT7: OUTPUT.7
OUTPUT8: OUTPUT.8
VCC: POWER.1

### Library data of the parts
CARRY_IN CARRY_OUT ENABLE = pinhead:PINHD-1X1: PIN HEADER
INPUT_A INPUT_B OUTPUT = pinhead:PINHD-1X8: PIN HEADER
POWER = pinhead:PINHD-1X2: PIN HEADER

## Module 3-TO-8_DECODER
Ports: INPUT1(in) INPUT2(in) INPUT3(in) OUTPUT1(out) OUTPUT2(out) OUTPUT3(out) OUTPUT4(out) OUTPUT5(out) OUTPUT6(out) OUTPUT7(out) OUTPUT8(out) VCC(in) GND(in)
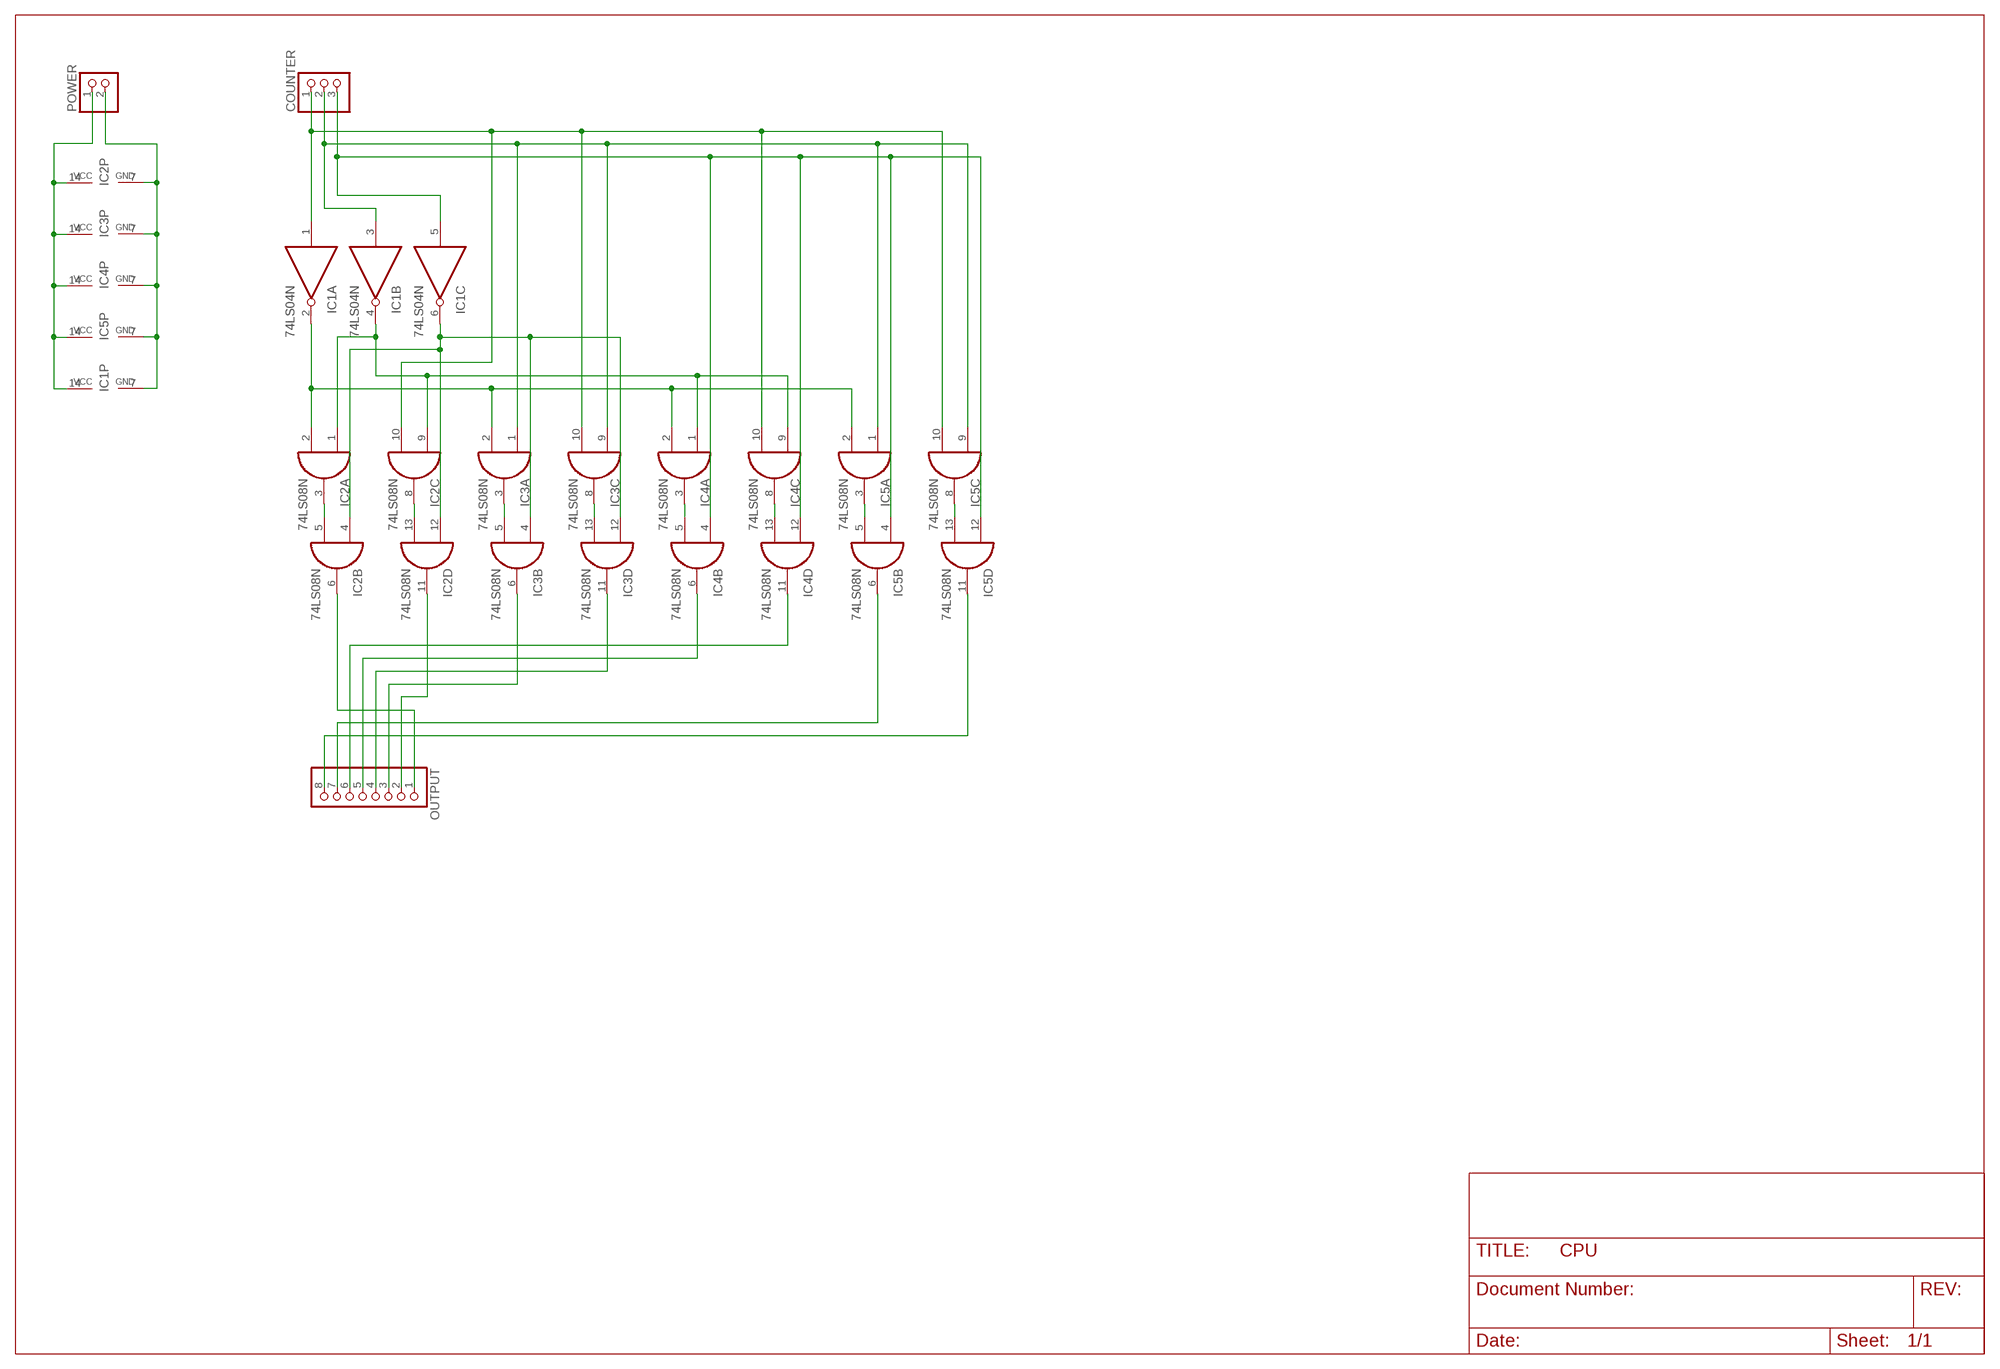
[diagram p31: schematic, module 3-TO-8_DECODER, sheet 1]

### Parts
COUNTER  PINHD-1X3  [1X03]
IC1  74LS04N  [DIL14]
IC2  74LS08N  [DIL14]
IC3  74LS08N  [DIL14]
IC4  74LS08N  [DIL14]
IC5  74LS08N  [DIL14]
OUTPUT  PINHD-1X8  [1X08]
POWER  PINHD-1X2  [1X02]

### Nets
GND: IC1.7(P:GND) IC2.7(P:GND) IC3.7(P:GND) IC4.7(P:GND) IC5.7(P:GND) POWER.2
INPUT1: COUNTER.1 IC1.1(A:I) IC2.10(C:I1) IC3.10(C:I1) IC4.10(C:I1) IC5.10(C:I1)
INPUT2: COUNTER.2 IC1.3(B:I) IC3.1(A:I0) IC3.9(C:I0) IC5.1(A:I0) IC5.9(C:I0)
INPUT3: COUNTER.3 IC1.5(C:I) IC4.4(B:I0) IC4.12(D:I0) IC5.4(B:I0) IC5.12(D:I0)
N$4: IC1.2(A:O) IC2.2(A:I1) IC3.2(A:I1) IC4.2(A:I1) IC5.2(A:I1)
N$5: IC1.4(B:O) IC2.1(A:I0) IC2.9(C:I0) IC4.1(A:I0) IC4.9(C:I0)
N$6: IC2.3(A:O) IC2.5(B:I1)
N$7: IC1.6(C:O) IC2.4(B:I0) IC2.12(D:I0) IC3.4(B:I0) IC3.12(D:I0)
N$9: IC2.8(C:O) IC2.13(D:I1)
N$11: IC3.3(A:O) IC3.5(B:I1)
N$13: IC3.8(C:O) IC3.13(D:I1)
N$15: IC4.3(A:O) IC4.5(B:I1)
N$17: IC4.8(C:O) IC4.13(D:I1)
N$19: IC5.3(A:O) IC5.5(B:I1)
N$21: IC5.8(C:O) IC5.13(D:I1)
OUTPUT1: IC2.6(B:O) OUTPUT.1
OUTPUT2: IC2.11(D:O) OUTPUT.2
OUTPUT3: IC3.6(B:O) OUTPUT.3
OUTPUT4: IC3.11(D:O) OUTPUT.4
OUTPUT5: IC4.6(B:O) OUTPUT.5
OUTPUT6: IC4.11(D:O) OUTPUT.6
OUTPUT7: IC5.6(B:O) OUTPUT.7
OUTPUT8: IC5.11(D:O) OUTPUT.8
VCC: IC1.14(P:VCC) IC2.14(P:VCC) IC3.14(P:VCC) IC4.14(P:VCC) IC5.14(P:VCC) POWER.1
Unconnected: IC1.8(D:O) IC1.9(D:I) IC1.10(E:O) IC1.11(E:I) IC1.12(F:O) IC1.13(F:I)

### Library data of the parts
COUNTER = pinhead:PINHD-1X3: PIN HEADER
IC1 = 74xx-eu:74*04: Hex INVERTER
IC2-IC5 = 74xx-eu:74*08: Quad 2-input AND gate
OUTPUT = pinhead:PINHD-1X8: PIN HEADER
POWER = pinhead:PINHD-1X2: PIN HEADER

## Module ENABLE_CIRCUIT
Ports: INPUT_1(in) INPUT_2(in) INPUT_3(in) INPUT_4(in) INPUT_5(in) INPUT_6(in) INPUT_7(in) INPUT_8(in) OUTPUT_1(out) OUTPUT_2(out) OUTPUT_3(out) OUTPUT_4(out) OUTPUT_5(out) OUTPUT_6(out) OUTPUT_7(out) OUTPUT_8(out) VCC(in) GND(in) ENABLE(in)
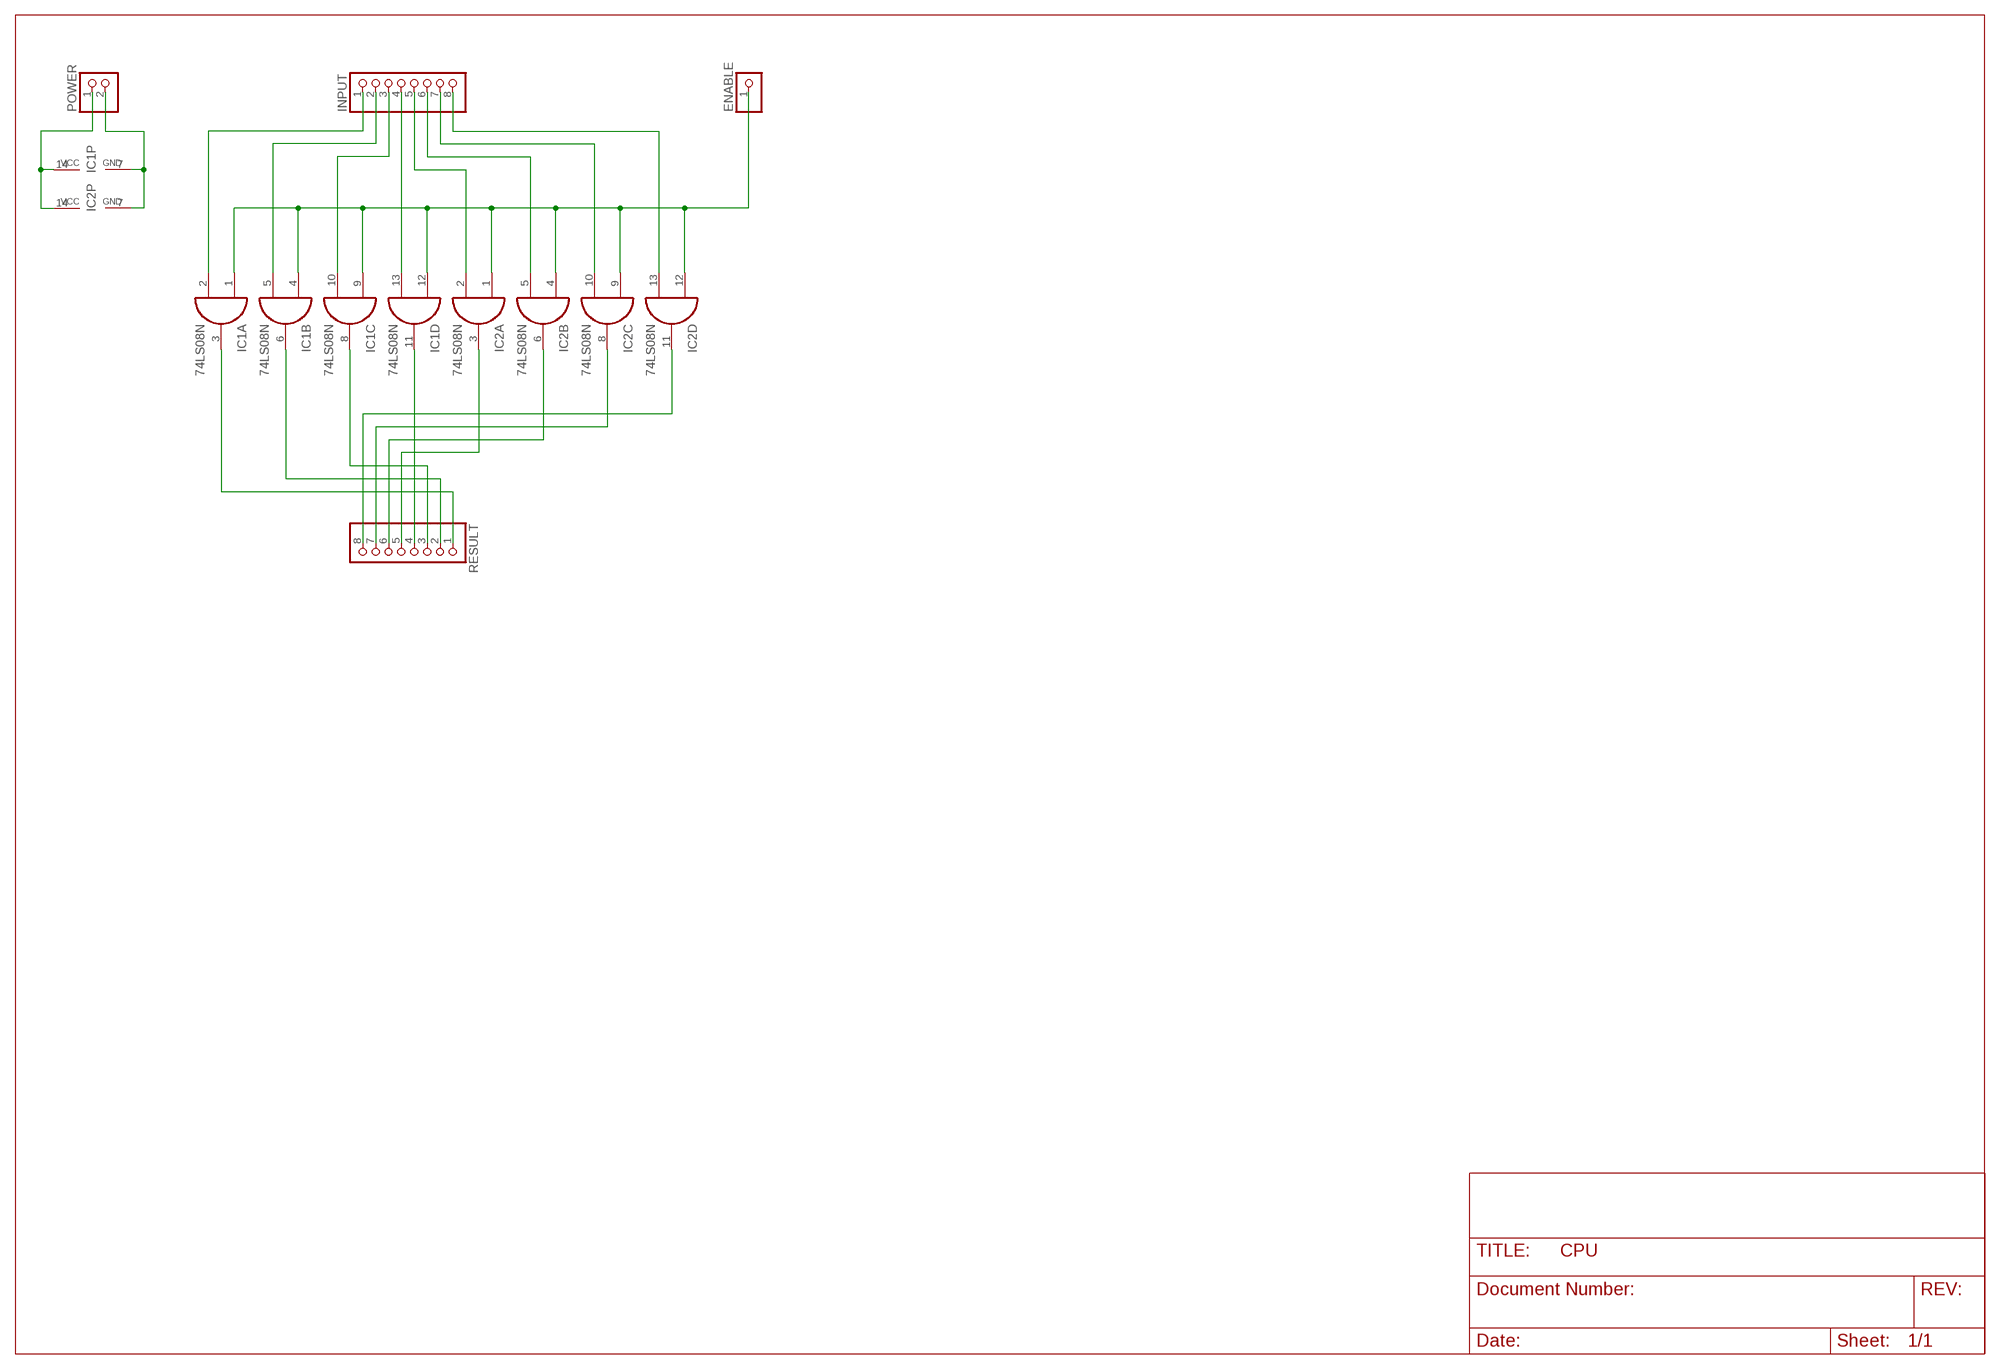
[diagram p32: schematic, module ENABLE_CIRCUIT, sheet 1]

### Parts
ENABLE  PINHD-1X1  [1X01]
IC1  74LS08N  [DIL14]
IC2  74LS08N  [DIL14]
INPUT  PINHD-1X8  [1X08]
POWER  PINHD-1X2  [1X02]
RESULT  PINHD-1X8  [1X08]

### Nets
ENABLE: ENABLE.1 IC1.1(A:I0) IC1.4(B:I0) IC1.9(C:I0) IC1.12(D:I0) IC2.1(A:I0) IC2.4(B:I0) IC2.9(C:I0) IC2.12(D:I0)
GND: IC1.7(P:GND) IC2.7(P:GND) POWER.2
INPUT_1: IC1.2(A:I1) INPUT.1
INPUT_2: IC1.5(B:I1) INPUT.2
INPUT_3: IC1.10(C:I1) INPUT.3
INPUT_4: IC1.13(D:I1) INPUT.4
INPUT_5: IC2.2(A:I1) INPUT.5
INPUT_6: IC2.5(B:I1) INPUT.6
INPUT_7: IC2.10(C:I1) INPUT.7
INPUT_8: IC2.13(D:I1) INPUT.8
OUTPUT_1: IC1.3(A:O) RESULT.1
OUTPUT_2: IC1.6(B:O) RESULT.2
OUTPUT_3: IC1.8(C:O) RESULT.3
OUTPUT_4: IC1.11(D:O) RESULT.4
OUTPUT_5: IC2.3(A:O) RESULT.5
OUTPUT_6: IC2.6(B:O) RESULT.6
OUTPUT_7: IC2.8(C:O) RESULT.7
OUTPUT_8: IC2.11(D:O) RESULT.8
VCC: IC1.14(P:VCC) IC2.14(P:VCC) POWER.1

### Library data of the parts
ENABLE = pinhead:PINHD-1X1: PIN HEADER
IC1 IC2 = 74xx-eu:74*08: Quad 2-input AND gate
INPUT RESULT = pinhead:PINHD-1X8: PIN HEADER
POWER = pinhead:PINHD-1X2: PIN HEADER

## Module 4-TO-16_DECODER
Ports: INPUT_1(in) INPUT_2(in) INPUT_3(in) INPUT_4(in) OUTPUT_1(out) OUTPUT_2(out) OUTPUT_3(out) OUTPUT_4(out) OUTPUT_5(out) OUTPUT_6(out) OUTPUT_7(out) OUTPUT_8(out) OUTPUT_9(out) OUTPUT_10(out) OUTPUT_11(out) OUTPUT_12(out) OUTPUT_13(out) OUTPUT_14(out) OUTPUT_15(out) OUTPUT_16(out) VCC(in) GND(in)
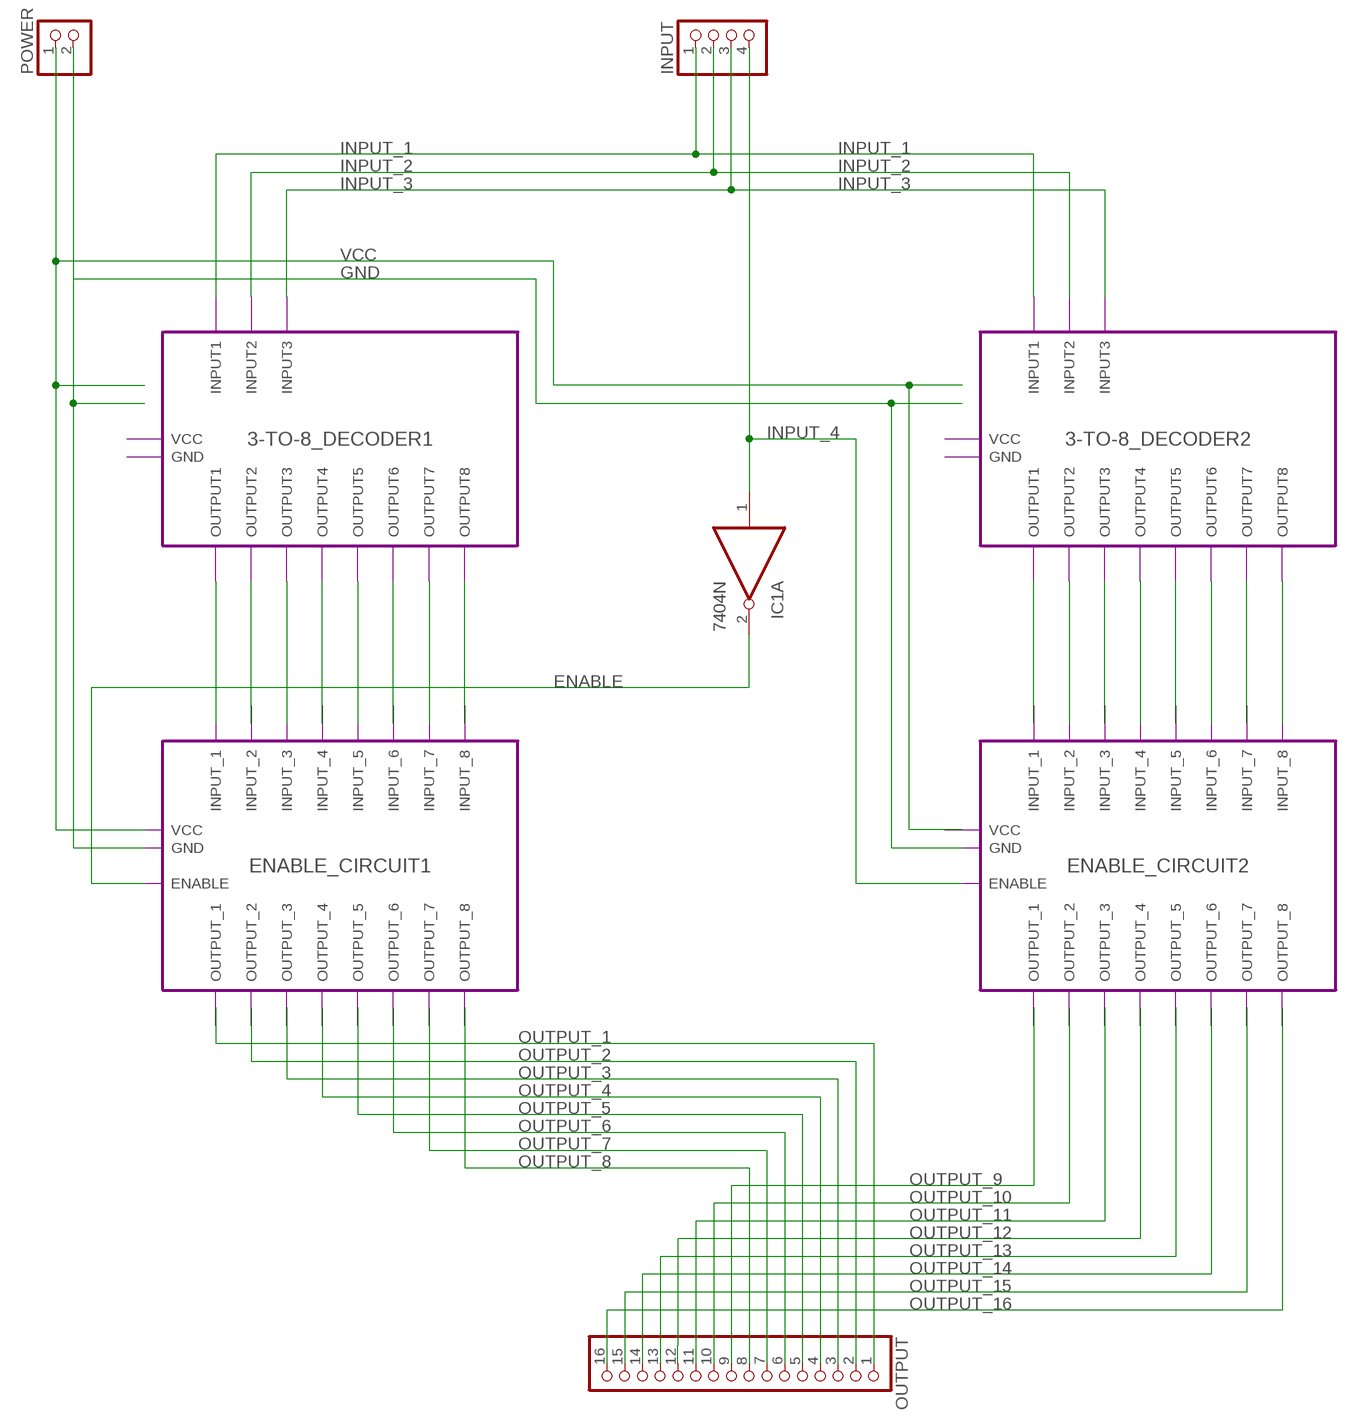
[diagram p33: schematic, module 4-TO-16_DECODER, sheet 1]

### Parts
IC1  7404N  [DIL14]
INPUT  PINHD-1X4  [1X04]
OUTPUT  PINHD-1X16  [1X16]
POWER  PINHD-1X2  [1X02]

### Module instances
3-TO-8_DECODER1 = 3-TO-8_DECODER
3-TO-8_DECODER2 = 3-TO-8_DECODER
ENABLE_CIRCUIT1 = ENABLE_CIRCUIT
ENABLE_CIRCUIT2 = ENABLE_CIRCUIT

### Nets
ENABLE: IC1.2(A:O)
GND: POWER.2
INPUT_1: INPUT.1
INPUT_2: INPUT.2
INPUT_3: INPUT.3
INPUT_4: IC1.1(A:I) INPUT.4
OUTPUT_1: OUTPUT.1
OUTPUT_2: OUTPUT.2
OUTPUT_3: OUTPUT.3
OUTPUT_4: OUTPUT.4
OUTPUT_5: OUTPUT.5
OUTPUT_6: OUTPUT.6
OUTPUT_7: OUTPUT.7
OUTPUT_8: OUTPUT.8
OUTPUT_9: OUTPUT.9
OUTPUT_10: OUTPUT.10
OUTPUT_11: OUTPUT.11
OUTPUT_12: OUTPUT.12
OUTPUT_13: OUTPUT.13
OUTPUT_14: OUTPUT.14
OUTPUT_15: OUTPUT.15
OUTPUT_16: OUTPUT.16
VCC: POWER.1
Unconnected: IC1.3(B:I) IC1.4(B:O) IC1.5(C:I) IC1.6(C:O) IC1.8(D:O) IC1.9(D:I) IC1.10(E:O) IC1.11(E:I) IC1.12(F:O) IC1.13(F:I)

### Power pins joined to a net without a drawn wire
GND: IC1.7(P:GND)
VCC: IC1.14(P:VCC)

### Library data of the parts
IC1 = 74xx-eu:74*04: Hex INVERTER
INPUT = pinhead:PINHD-1X4: PIN HEADER
OUTPUT = pinhead:PINHD-1X16: PIN HEADER
POWER = pinhead:PINHD-1X2: PIN HEADER

## Module FULL_ADDER_4BIT
Ports: INPUT_A_1(in) INPUT_A_2(in) INPUT_A_3(in) INPUT_A_4(in) INPUT_B_1(in) INPUT_B_2(in) INPUT_B_3(in) INPUT_B_4(in) OUTPUT_1(out) OUTPUT_2(out) OUTPUT_3(out) OUTPUT_4(out) VCC(in) GND(in) CARRY_IN(in) CARRY_OUT(out)
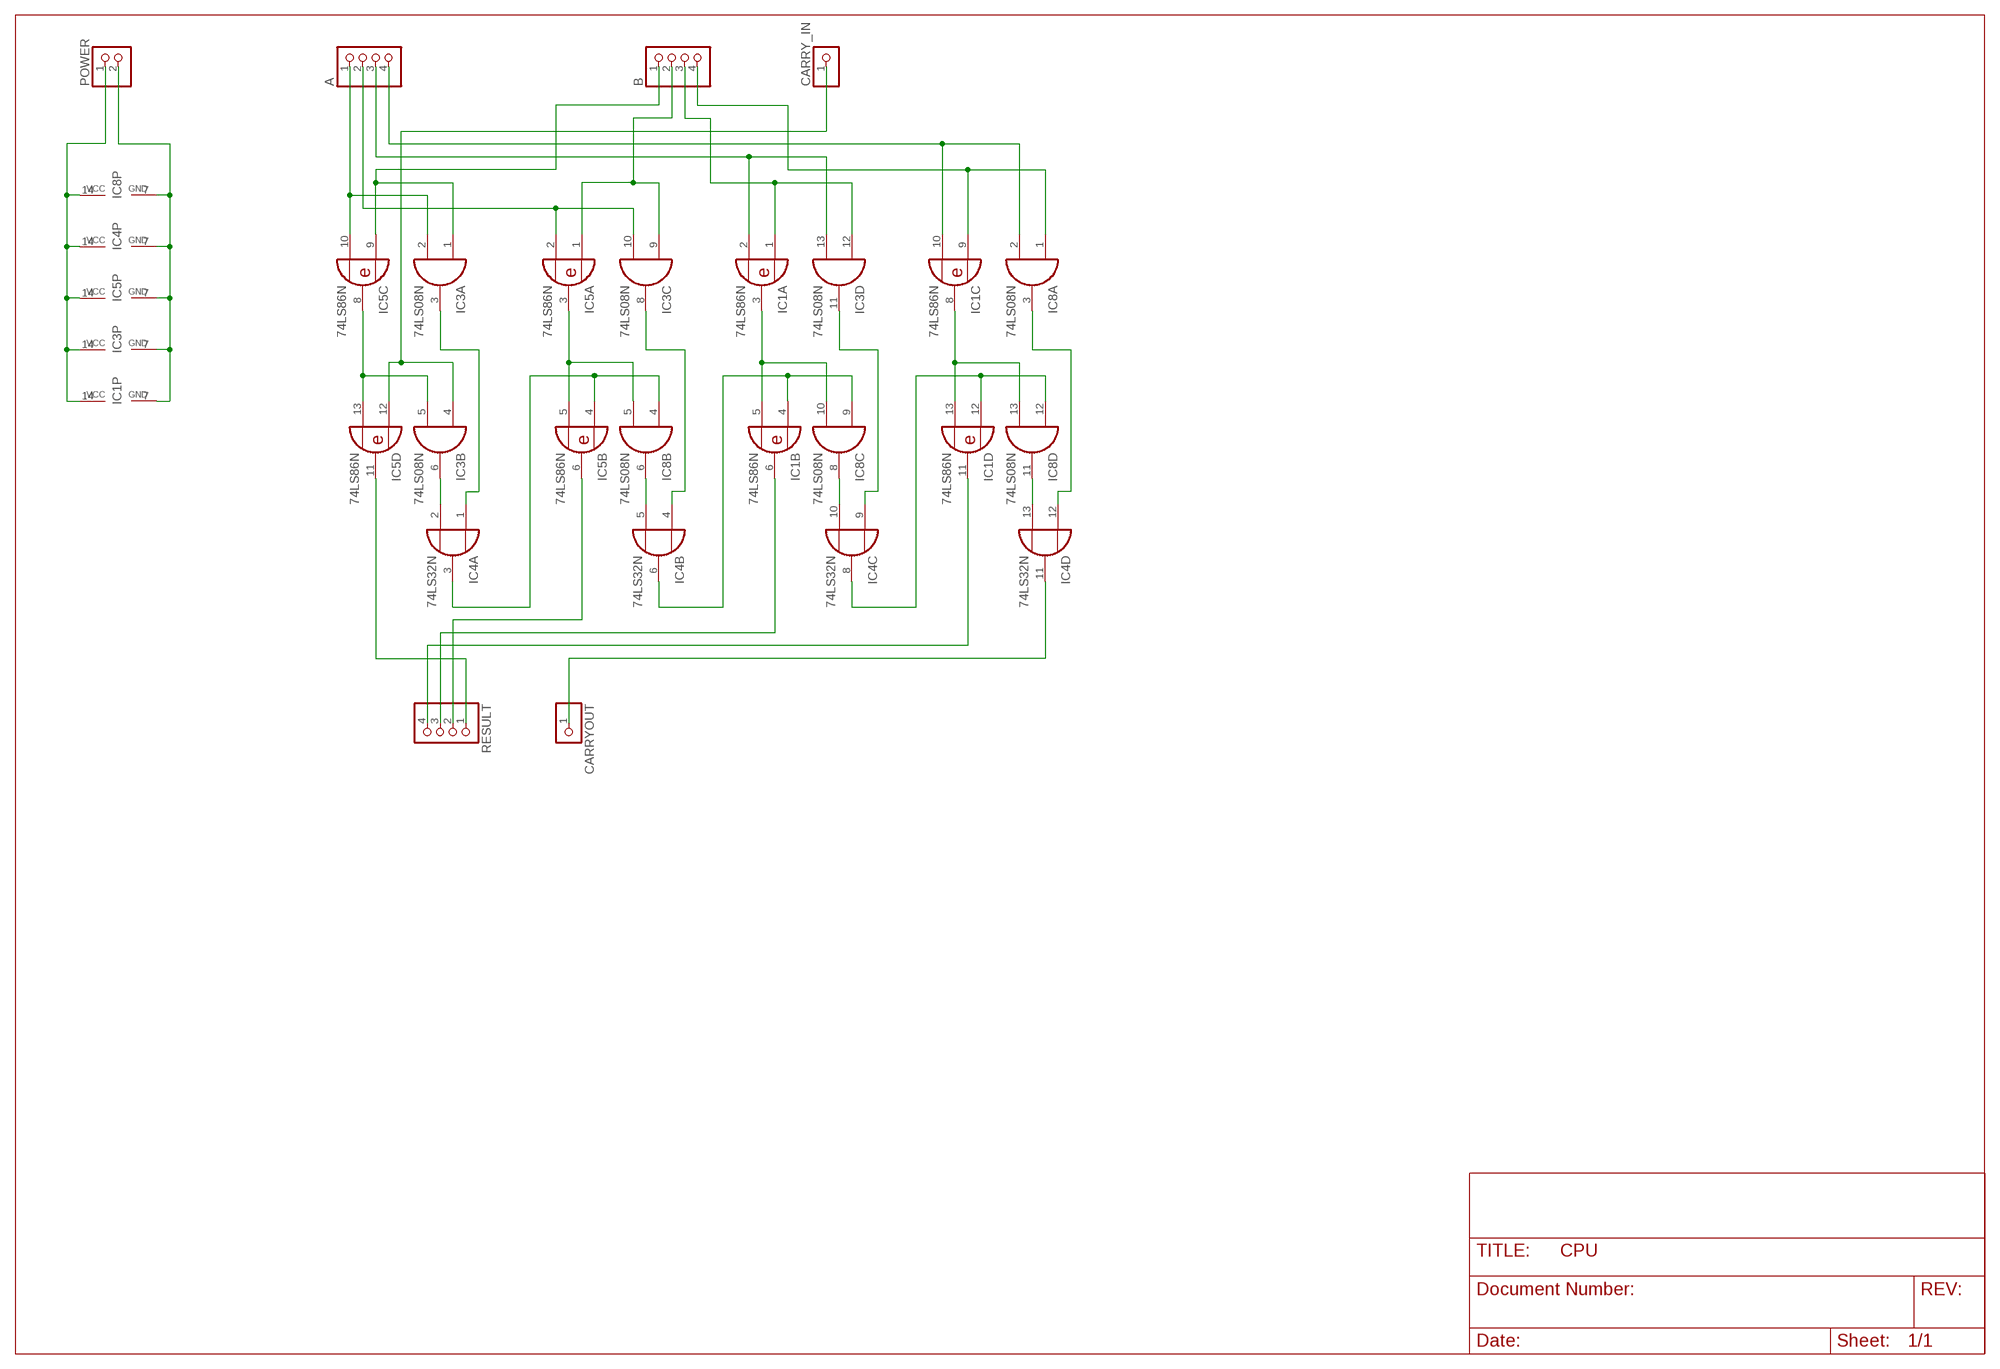
[diagram p34: schematic, module FULL_ADDER_4BIT, sheet 1]

### Parts
A  PINHD-1X4  [1X04]
B  PINHD-1X4  [1X04]
CARRY_IN  PINHD-1X1  [1X01]
CARRYOUT  PINHD-1X1  [1X01]
IC1  74LS86N  [DIL14]
IC3  74LS08N  [DIL14]
IC4  74LS32N  [DIL14]
IC5  74LS86N  [DIL14]
IC8  74LS08N  [DIL14]
POWER  PINHD-1X2  [1X02]
RESULT  PINHD-1X4  [1X04]

### Nets
CARRY_IN: CARRY_IN.1 IC3.4(B:I0) IC5.12(D:I0)
CARRY_OUT: CARRYOUT.1 IC4.11(D:O)
GND: IC1.7(P:GND) IC3.7(P:GND) IC4.7(P:GND) IC5.7(P:GND) IC8.7(P:GND) POWER.2
INPUT_A_1: A.1 IC3.2(A:I1) IC5.10(C:I1)
INPUT_A_2: A.2 IC3.10(C:I1) IC5.2(A:I1)
INPUT_A_3: A.3 IC1.2(A:I1) IC3.13(D:I1)
INPUT_A_4: A.4 IC1.10(C:I1) IC8.2(A:I1)
INPUT_B_1: B.1 IC3.1(A:I0) IC5.9(C:I0)
INPUT_B_2: B.2 IC3.9(C:I0) IC5.1(A:I0)
INPUT_B_3: B.3 IC1.1(A:I0) IC3.12(D:I0)
INPUT_B_4: B.4 IC1.9(C:I0) IC8.1(A:I0)
N$8: IC3.5(B:I1) IC5.8(C:O) IC5.13(D:I1)
N$10: IC3.3(A:O) IC4.1(A:I0)
N$11: IC3.6(B:O) IC4.2(A:I1)
N$18: IC5.3(A:O) IC5.5(B:I1) IC8.5(B:I1)
N$20: IC1.3(A:O) IC1.5(B:I1) IC8.10(C:I1)
N$21: IC1.8(C:O) IC1.13(D:I1) IC8.13(D:I1)
N$22: IC4.3(A:O) IC5.4(B:I0) IC8.4(B:I0)
N$25: IC4.5(B:I1) IC8.6(B:O)
N$26: IC4.10(C:I1) IC8.8(C:O)
N$27: IC4.13(D:I1) IC8.11(D:O)
N$28: IC3.8(C:O) IC4.4(B:I0)
N$29: IC3.11(D:O) IC4.9(C:I0)
N$30: IC4.12(D:I0) IC8.3(A:O)
N$31: IC1.4(B:I0) IC4.6(B:O) IC8.9(C:I0)
N$32: IC1.12(D:I0) IC4.8(C:O) IC8.12(D:I0)
OUTPUT_1: IC5.11(D:O) RESULT.1
OUTPUT_2: IC5.6(B:O) RESULT.2
OUTPUT_3: IC1.6(B:O) RESULT.3
OUTPUT_4: IC1.11(D:O) RESULT.4
VCC: IC1.14(P:VCC) IC3.14(P:VCC) IC4.14(P:VCC) IC5.14(P:VCC) IC8.14(P:VCC) POWER.1

### Library data of the parts
A B RESULT = pinhead:PINHD-1X4: PIN HEADER
CARRY_IN CARRYOUT = pinhead:PINHD-1X1: PIN HEADER
IC1 IC5 = 74xx-eu:74*86: Quad 2-input EXCLUSIVE-OR (XOR) gate
IC3 IC8 = 74xx-eu:74*08: Quad 2-input AND gate
IC4 = 74xx-eu:74*32: Quad 2-input OR gate
POWER = pinhead:PINHD-1X2: PIN HEADER

## Module INVERTER
Ports: INPUT1(in) INPUT2(in) INPUT3(in) INPUT4(in) INPUT5(in) INPUT6(in) INPUT7(in) INPUT8(in) OUTPUT1(out) OUTPUT2(out) OUTPUT3(out) OUTPUT4(out) OUTPUT5(out) OUTPUT6(out) OUTPUT7(out) OUTPUT8(out) VCC(in) GND(in) INVERT(in)
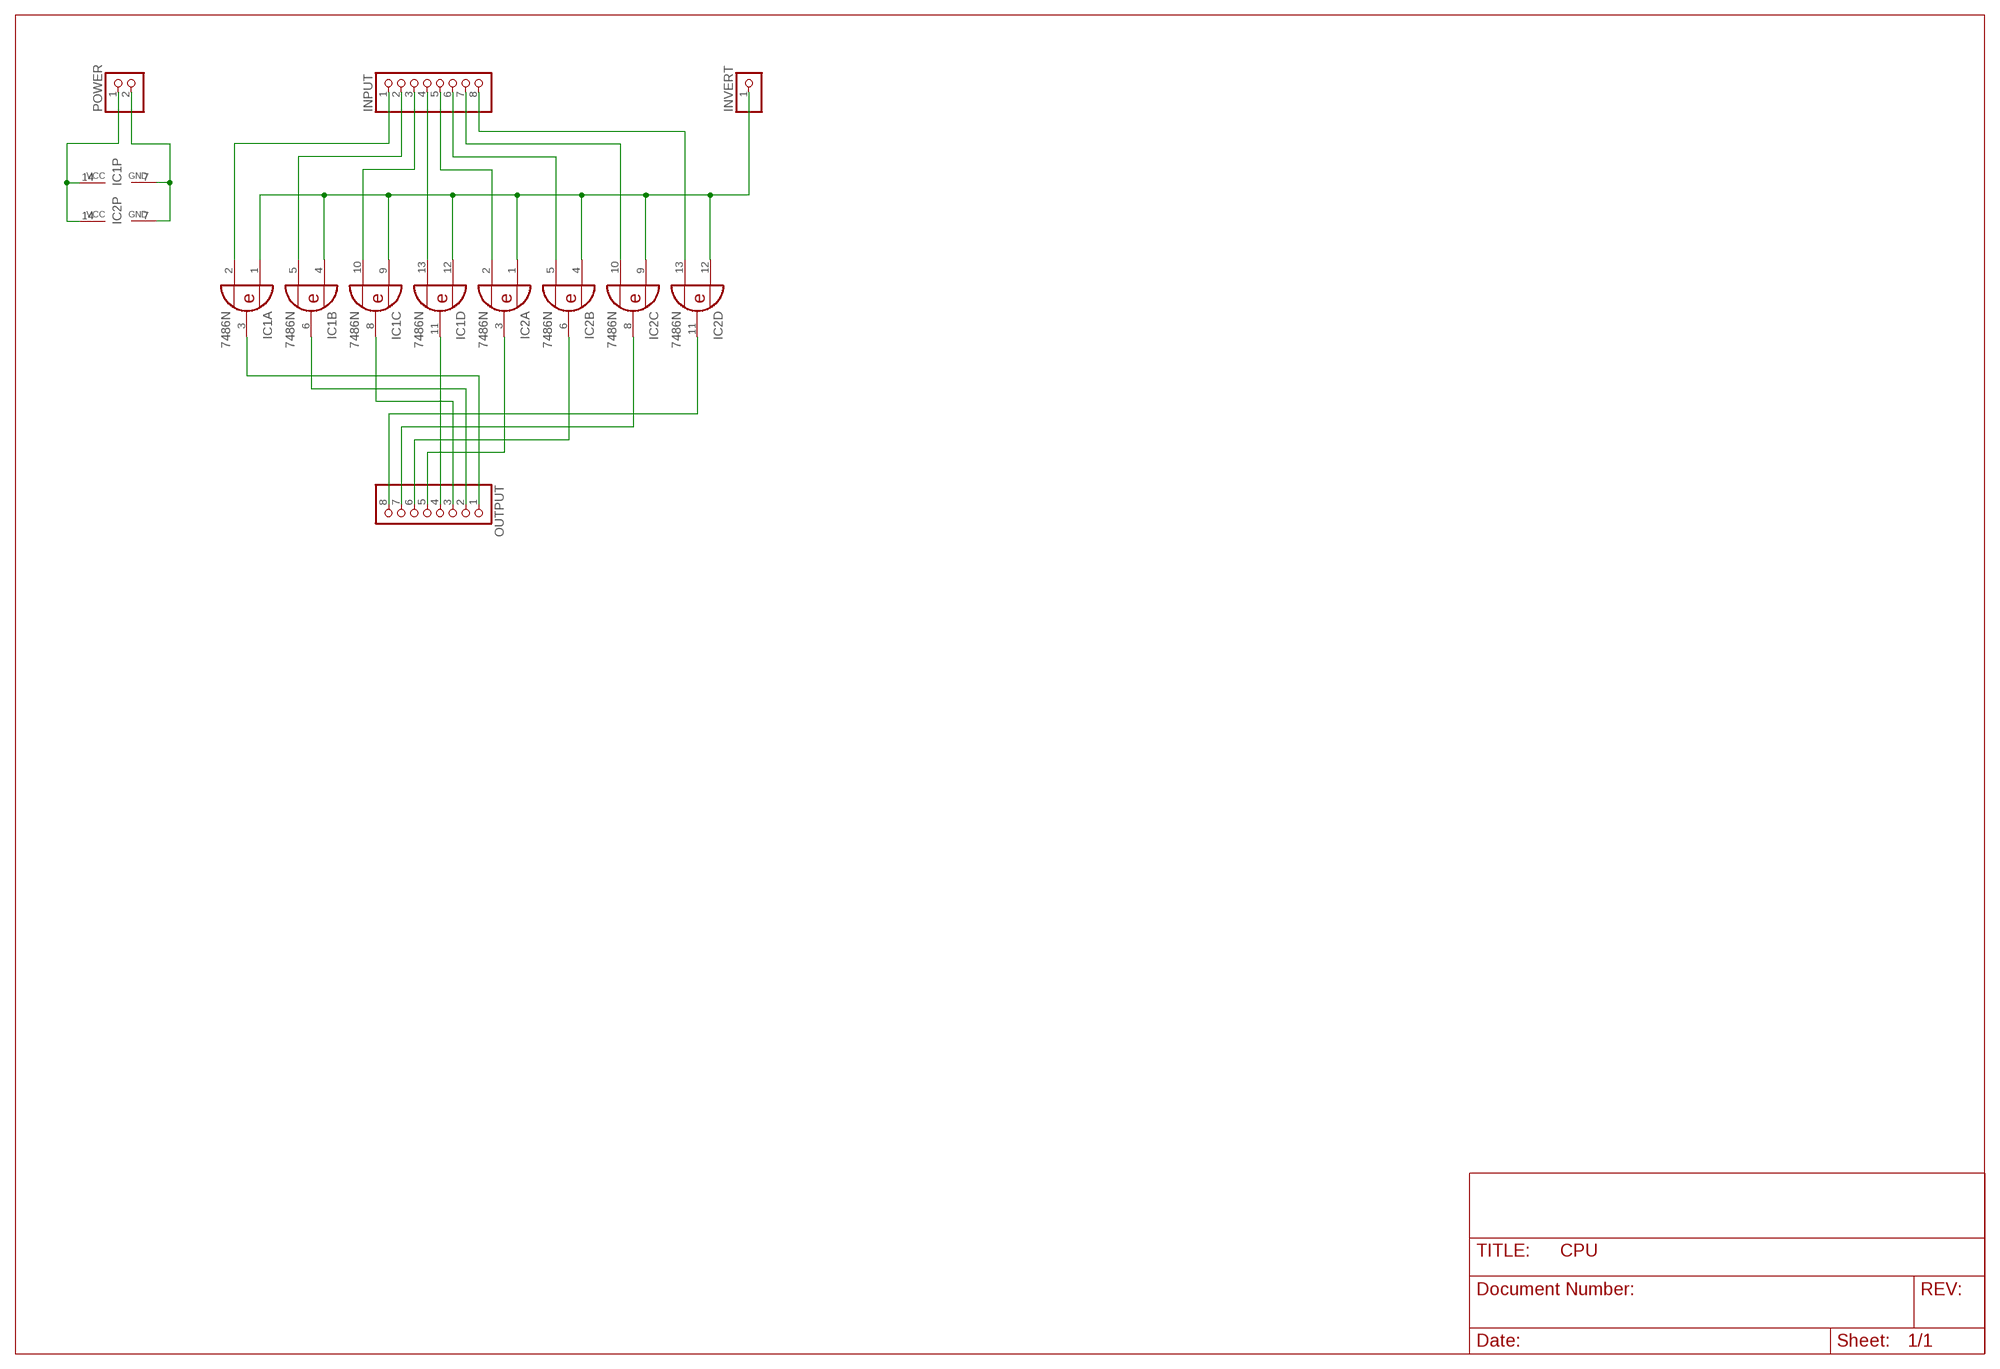
[diagram p35: schematic, module INVERTER, sheet 1]

### Parts
IC1  7486N  [DIL14]
IC2  7486N  [DIL14]
INPUT  PINHD-1X8  [1X08]
INVERT  PINHD-1X1  [1X01]
OUTPUT  PINHD-1X8  [1X08]
POWER  PINHD-1X2  [1X02]

### Nets
GND: IC1.7(P:GND) IC2.7(P:GND) POWER.2
INPUT1: IC1.2(A:I1) INPUT.1
INPUT2: IC1.5(B:I1) INPUT.2
INPUT3: IC1.10(C:I1) INPUT.3
INPUT4: IC1.13(D:I1) INPUT.4
INPUT5: IC2.2(A:I1) INPUT.5
INPUT6: IC2.5(B:I1) INPUT.6
INPUT7: IC2.10(C:I1) INPUT.7
INPUT8: IC2.13(D:I1) INPUT.8
INVERT: IC1.1(A:I0) IC1.4(B:I0) IC1.9(C:I0) IC1.12(D:I0) IC2.1(A:I0) IC2.4(B:I0) IC2.9(C:I0) IC2.12(D:I0) INVERT.1
OUTPUT1: IC1.3(A:O) OUTPUT.1
OUTPUT2: IC1.6(B:O) OUTPUT.2
OUTPUT3: IC1.8(C:O) OUTPUT.3
OUTPUT4: IC1.11(D:O) OUTPUT.4
OUTPUT5: IC2.3(A:O) OUTPUT.5
OUTPUT6: IC2.6(B:O) OUTPUT.6
OUTPUT7: IC2.8(C:O) OUTPUT.7
OUTPUT8: IC2.11(D:O) OUTPUT.8
VCC: IC1.14(P:VCC) IC2.14(P:VCC) POWER.1

### Library data of the parts
IC1 IC2 = 74xx-eu:74*86: Quad 2-input EXCLUSIVE-OR (XOR) gate
INPUT OUTPUT = pinhead:PINHD-1X8: PIN HEADER
INVERT = pinhead:PINHD-1X1: PIN HEADER
POWER = pinhead:PINHD-1X2: PIN HEADER

## Module ADD
Ports: INPUT_A_1(in) INPUT_A_2(in) INPUT_A_3(in) INPUT_A_4(in) INPUT_A_5(in) INPUT_A_6(in) INPUT_A_7(in) INPUT_A_8(in) INPUT_B_1(in) INPUT_B_2(in) INPUT_B_3(in) INPUT_B_4(in) INPUT_B_5(in) INPUT_B_6(in) INPUT_B_7(in) INPUT_B_8(in) CARRY_OUT(out) VCC(in) GND(in) ENABLE_ADD(in) ENABLE_SUB(in) OUTPUT1(out) OUTPUT2(out) OUTPUT3(out) OUTPUT4(out) OUTPUT5(out) OUTPUT6(out) OUTPUT7(out) OUTPUT8(out)
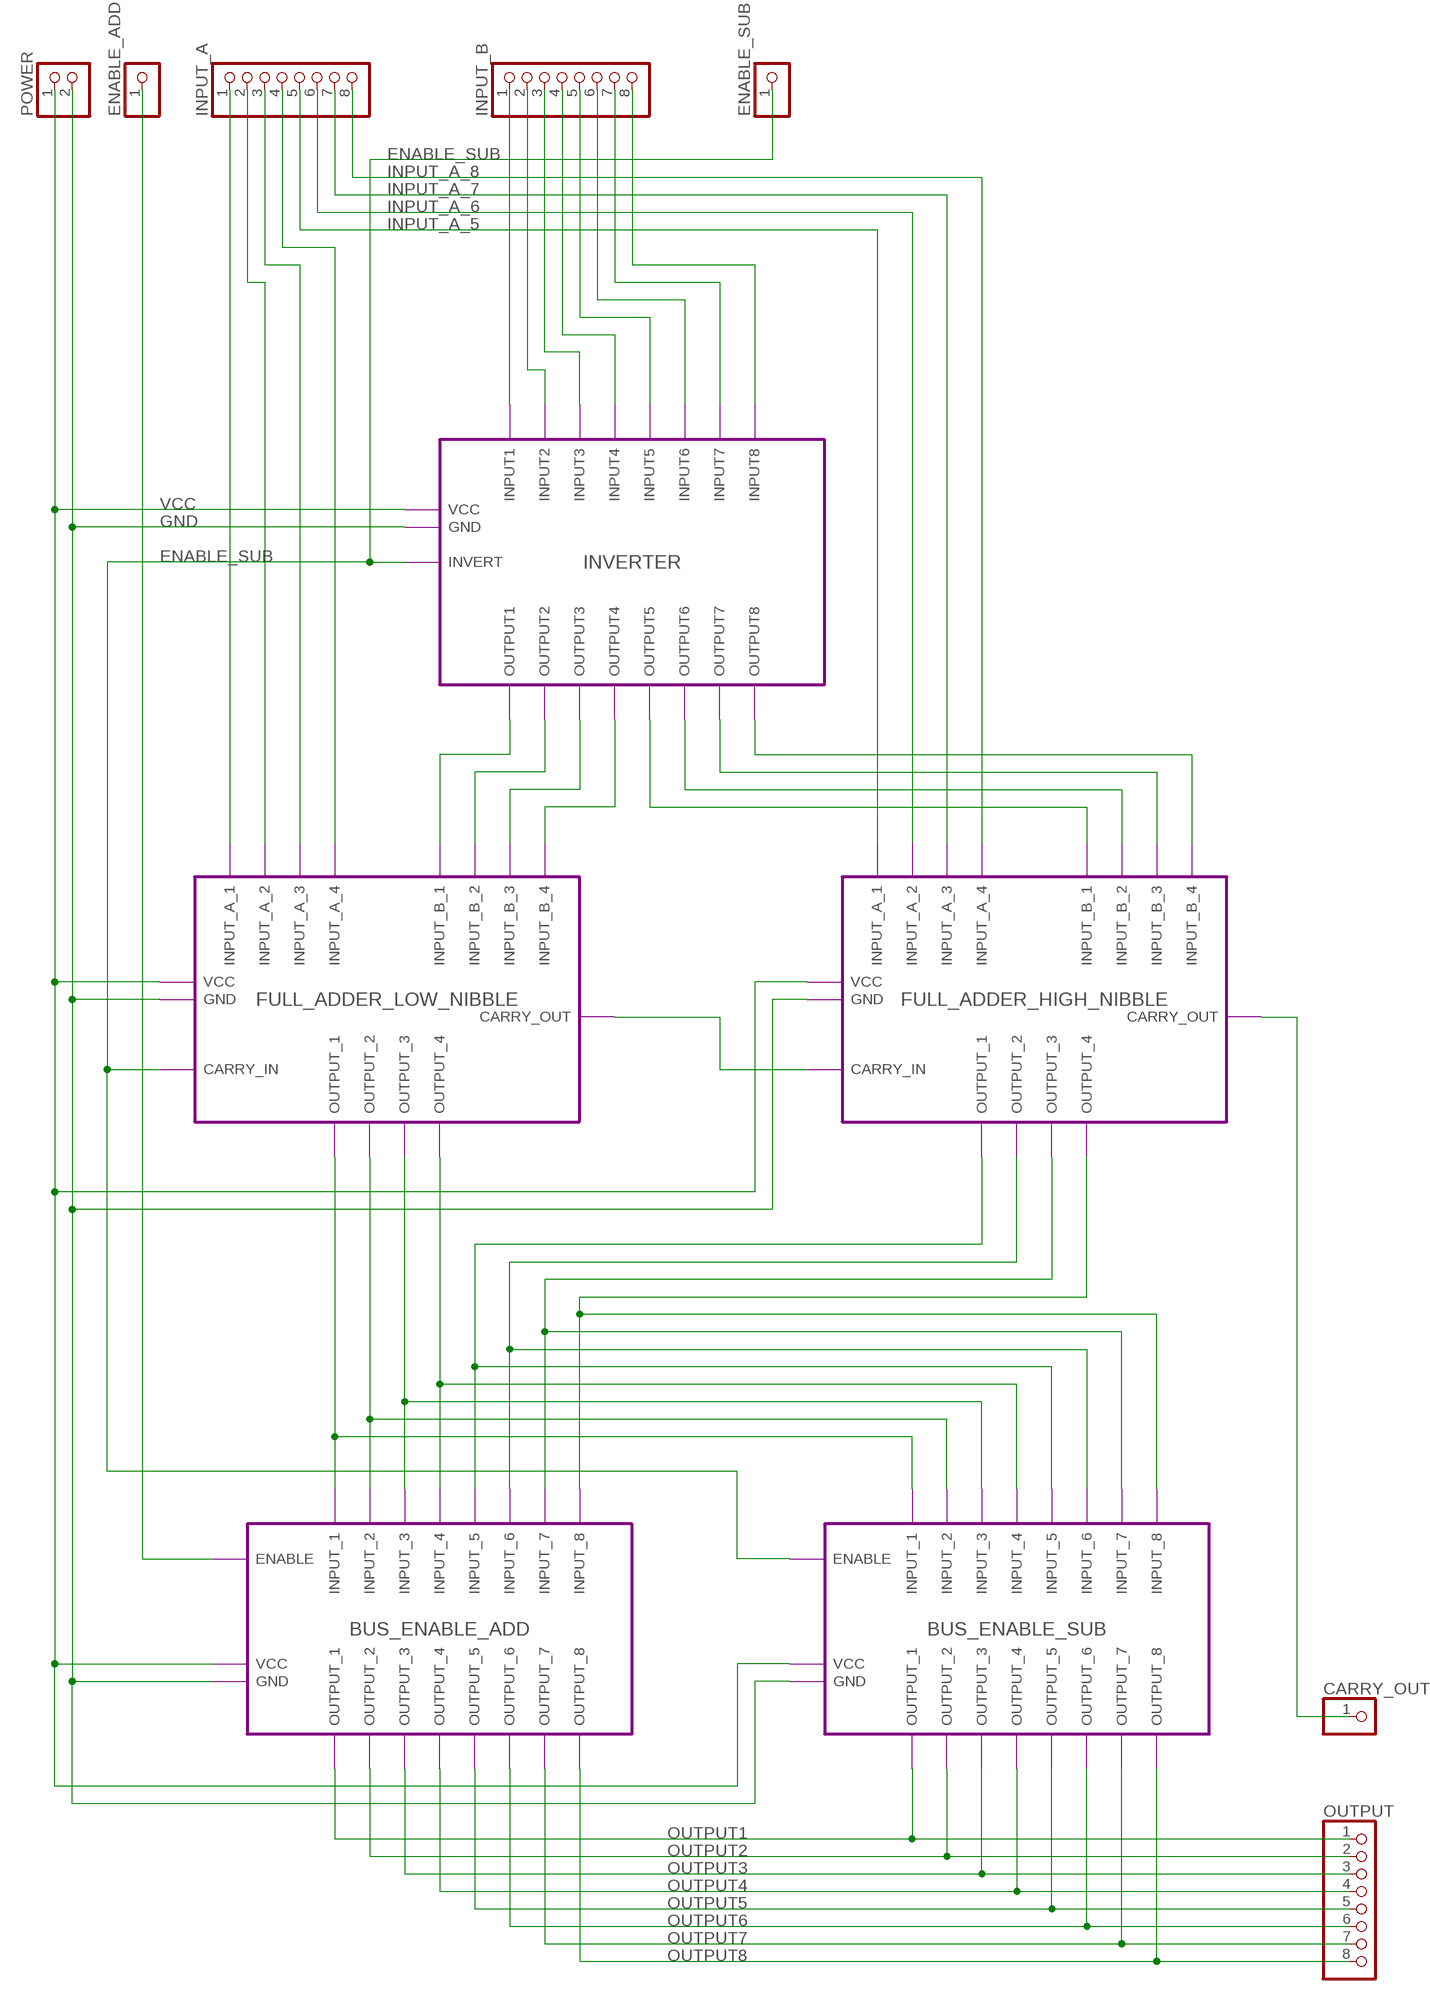
[diagram p36: schematic, module ADD, sheet 1]

### Parts
CARRY_OUT  PINHD-1X1  [1X01]
ENABLE_ADD  PINHD-1X1  [1X01]
ENABLE_SUB  PINHD-1X1  [1X01]
INPUT_A  PINHD-1X8  [1X08]
INPUT_B  PINHD-1X8  [1X08]
OUTPUT  PINHD-1X8  [1X08]
POWER  PINHD-1X2  [1X02]

### Module instances
FULL_ADDER_LOW_NIBBLE = FULL_ADDER_4BIT
FULL_ADDER_HIGH_NIBBLE = FULL_ADDER_4BIT
BUS_ENABLE_ADD = BUS_ENABLE
INVERTER = INVERTER
BUS_ENABLE_SUB = BUS_ENABLE

### Nets
ENABLE_ADD: ENABLE_ADD.1 ; port BUS_ENABLE_ADD.ENABLE
ENABLE_SUB: ENABLE_SUB.1 ; port BUS_ENABLE_SUB.ENABLE INVERTER.INVERT FULL_ADDER_LOW_NIBBLE.CARRY_IN
GND: POWER.2 ; port INVERTER.GND FULL_ADDER_LOW_NIBBLE.GND BUS_ENABLE_ADD.GND FULL_ADDER_HIGH_NIBBLE.GND BUS_ENABLE_SUB.GND
INPUT_A_1: INPUT_A.1 ; port FULL_ADDER_LOW_NIBBLE.INPUT_A_1
INPUT_A_2: INPUT_A.2 ; port FULL_ADDER_LOW_NIBBLE.INPUT_A_2
INPUT_A_3: INPUT_A.3 ; port FULL_ADDER_LOW_NIBBLE.INPUT_A_3
INPUT_A_4: INPUT_A.4 ; port FULL_ADDER_LOW_NIBBLE.INPUT_A_4
INPUT_A_5: INPUT_A.5 ; port FULL_ADDER_HIGH_NIBBLE.INPUT_A_1
INPUT_A_6: INPUT_A.6 ; port FULL_ADDER_HIGH_NIBBLE.INPUT_A_2
INPUT_A_7: INPUT_A.7 ; port FULL_ADDER_HIGH_NIBBLE.INPUT_A_3
INPUT_A_8: INPUT_A.8 ; port FULL_ADDER_HIGH_NIBBLE.INPUT_A_4
INPUT_B_4: INPUT_B.4 ; port INVERTER.INPUT4
N$1: port FULL_ADDER_LOW_NIBBLE.OUTPUT_1 BUS_ENABLE_ADD.INPUT_1 BUS_ENABLE_SUB.INPUT_1
N$2: INPUT_B.2 ; port INVERTER.INPUT2
N$3: INPUT_B.1 ; port INVERTER.INPUT1
N$4: port INVERTER.OUTPUT1 FULL_ADDER_LOW_NIBBLE.INPUT_B_1
N$5: port INVERTER.OUTPUT2 FULL_ADDER_LOW_NIBBLE.INPUT_B_2
N$6: INPUT_B.5 ; port INVERTER.INPUT5
N$7: INPUT_B.6 ; port INVERTER.INPUT6
N$8: INPUT_B.7 ; port INVERTER.INPUT7
N$9: INPUT_B.8 ; port INVERTER.INPUT8
N$10: port INVERTER.OUTPUT3 FULL_ADDER_LOW_NIBBLE.INPUT_B_3
N$11: port FULL_ADDER_LOW_NIBBLE.INPUT_B_4 INVERTER.OUTPUT4
N$12: port INVERTER.OUTPUT5 FULL_ADDER_HIGH_NIBBLE.INPUT_B_1
N$13: port INVERTER.OUTPUT6 FULL_ADDER_HIGH_NIBBLE.INPUT_B_2
N$14: port INVERTER.OUTPUT7 FULL_ADDER_HIGH_NIBBLE.INPUT_B_3
N$15: port INVERTER.OUTPUT8 FULL_ADDER_HIGH_NIBBLE.INPUT_B_4
N$17: INPUT_B.3 ; port INVERTER.INPUT3
N$18: port FULL_ADDER_LOW_NIBBLE.OUTPUT_2 BUS_ENABLE_ADD.INPUT_2 BUS_ENABLE_SUB.INPUT_2
N$19: port BUS_ENABLE_ADD.INPUT_3 FULL_ADDER_LOW_NIBBLE.OUTPUT_3 BUS_ENABLE_SUB.INPUT_3
N$20: port FULL_ADDER_LOW_NIBBLE.OUTPUT_4 BUS_ENABLE_ADD.INPUT_4 BUS_ENABLE_SUB.INPUT_4
N$21: port FULL_ADDER_HIGH_NIBBLE.OUTPUT_1 BUS_ENABLE_ADD.INPUT_5 BUS_ENABLE_SUB.INPUT_5
N$22: port BUS_ENABLE_ADD.INPUT_6 FULL_ADDER_HIGH_NIBBLE.OUTPUT_2 BUS_ENABLE_SUB.INPUT_6
N$23: port FULL_ADDER_HIGH_NIBBLE.OUTPUT_3 BUS_ENABLE_ADD.INPUT_7 BUS_ENABLE_SUB.INPUT_7
N$24: port BUS_ENABLE_ADD.INPUT_8 FULL_ADDER_HIGH_NIBBLE.OUTPUT_4 BUS_ENABLE_SUB.INPUT_8
N$32: port FULL_ADDER_LOW_NIBBLE.CARRY_OUT FULL_ADDER_HIGH_NIBBLE.CARRY_IN
N$34: CARRY_OUT.1 ; port FULL_ADDER_HIGH_NIBBLE.CARRY_OUT
OUTPUT1: OUTPUT.1 ; port BUS_ENABLE_ADD.OUTPUT_1 BUS_ENABLE_SUB.OUTPUT_1
OUTPUT2: OUTPUT.2 ; port BUS_ENABLE_ADD.OUTPUT_2 BUS_ENABLE_SUB.OUTPUT_2
OUTPUT3: OUTPUT.3 ; port BUS_ENABLE_ADD.OUTPUT_3 BUS_ENABLE_SUB.OUTPUT_3
OUTPUT4: OUTPUT.4 ; port BUS_ENABLE_ADD.OUTPUT_4 BUS_ENABLE_SUB.OUTPUT_4
OUTPUT5: OUTPUT.5 ; port BUS_ENABLE_ADD.OUTPUT_5 BUS_ENABLE_SUB.OUTPUT_5
OUTPUT6: OUTPUT.6 ; port BUS_ENABLE_ADD.OUTPUT_6 BUS_ENABLE_SUB.OUTPUT_6
OUTPUT7: OUTPUT.7 ; port BUS_ENABLE_ADD.OUTPUT_7 BUS_ENABLE_SUB.OUTPUT_7
OUTPUT8: OUTPUT.8 ; port BUS_ENABLE_ADD.OUTPUT_8 BUS_ENABLE_SUB.OUTPUT_8
VCC: POWER.1 ; port INVERTER.VCC FULL_ADDER_LOW_NIBBLE.VCC BUS_ENABLE_ADD.VCC FULL_ADDER_HIGH_NIBBLE.VCC BUS_ENABLE_SUB.VCC

### Library data of the parts
CARRY_OUT ENABLE_ADD ENABLE_SUB = pinhead:PINHD-1X1: PIN HEADER
INPUT_A INPUT_B OUTPUT = pinhead:PINHD-1X8: PIN HEADER
POWER = pinhead:PINHD-1X2: PIN HEADER